# EAGLE schematic CPU (EAGLE 7.5.0), part 3 of 7
## Module ALU
Ports: INPUT_A_1(in) INPUT_A_2(in) INPUT_A_3(in) INPUT_A_4(in) INPUT_A_5(in) INPUT_A_6(in) INPUT_A_7(in) INPUT_A_8(in) INPUT_B_1(in) INPUT_B_2(in) INPUT_B_3(in) INPUT_B_4(in) INPUT_B_5(in) INPUT_B_6(in) INPUT_B_7(in) INPUT_B_8(in) OPCODE_1(in) OPCODE_2(in) OPCODE_3(in) OPCODE_4(in) ALU_OPERATION(in) VCC(in) GND(in) OUTPUT1(out) OUTPUT2(out) OUTPUT3(out) OUTPUT4(out) OUTPUT5(out) OUTPUT6(out) OUTPUT7(out) OUTPUT8(out) SIGN(out) ZERO(out) CARRY(out) OVERFLOW(out)
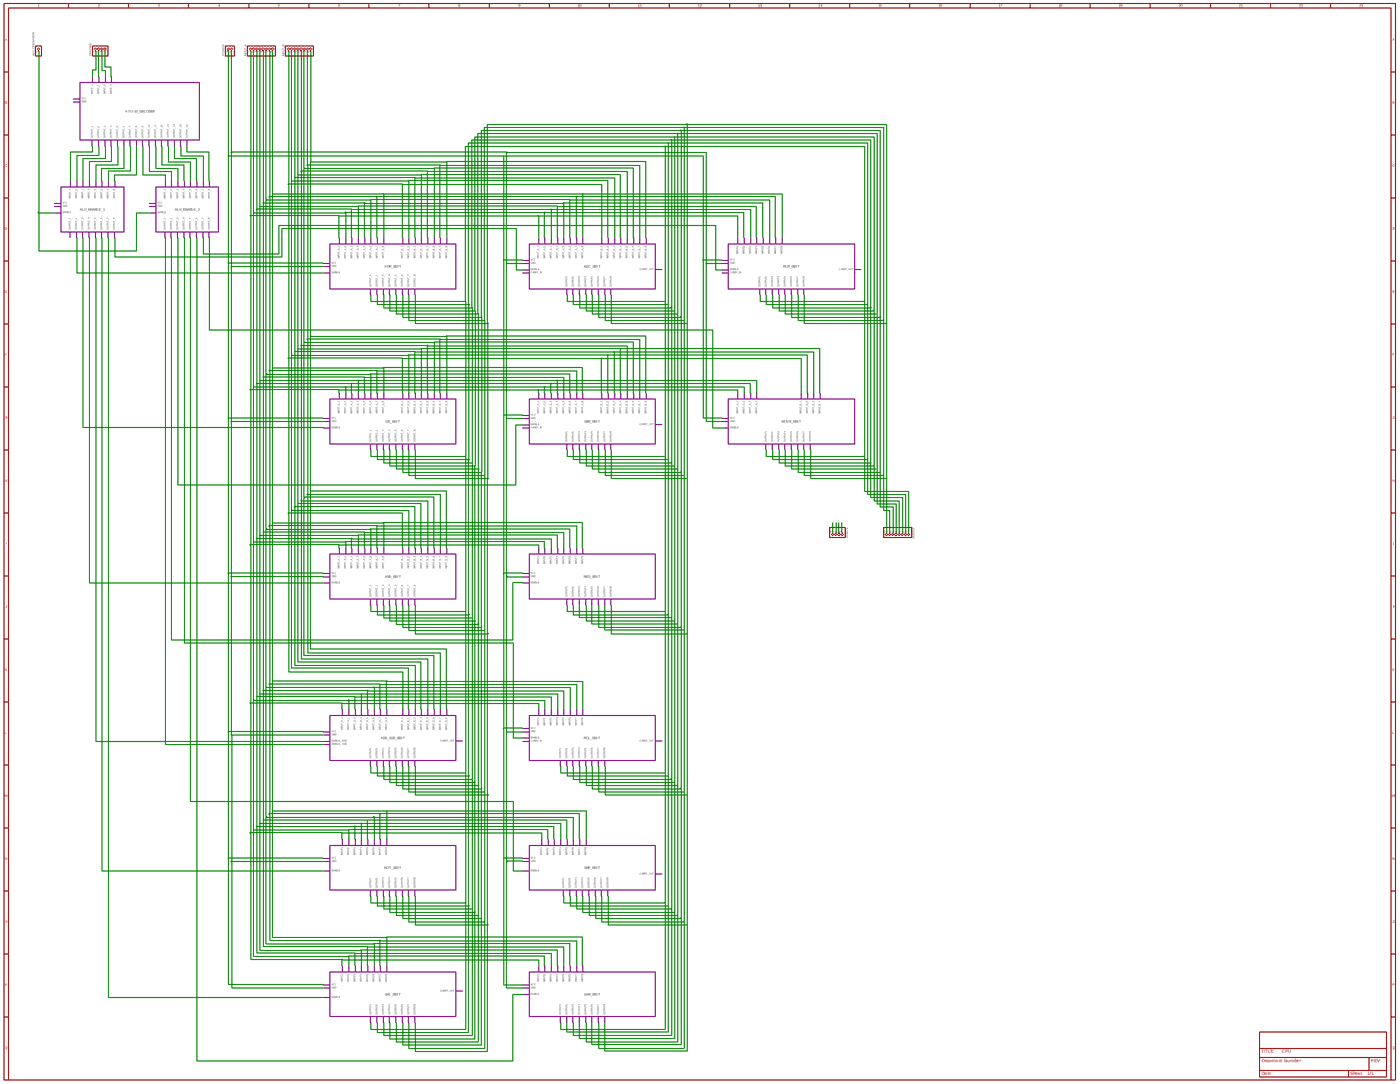
[diagram p37: schematic, module ALU, sheet 1, overview]
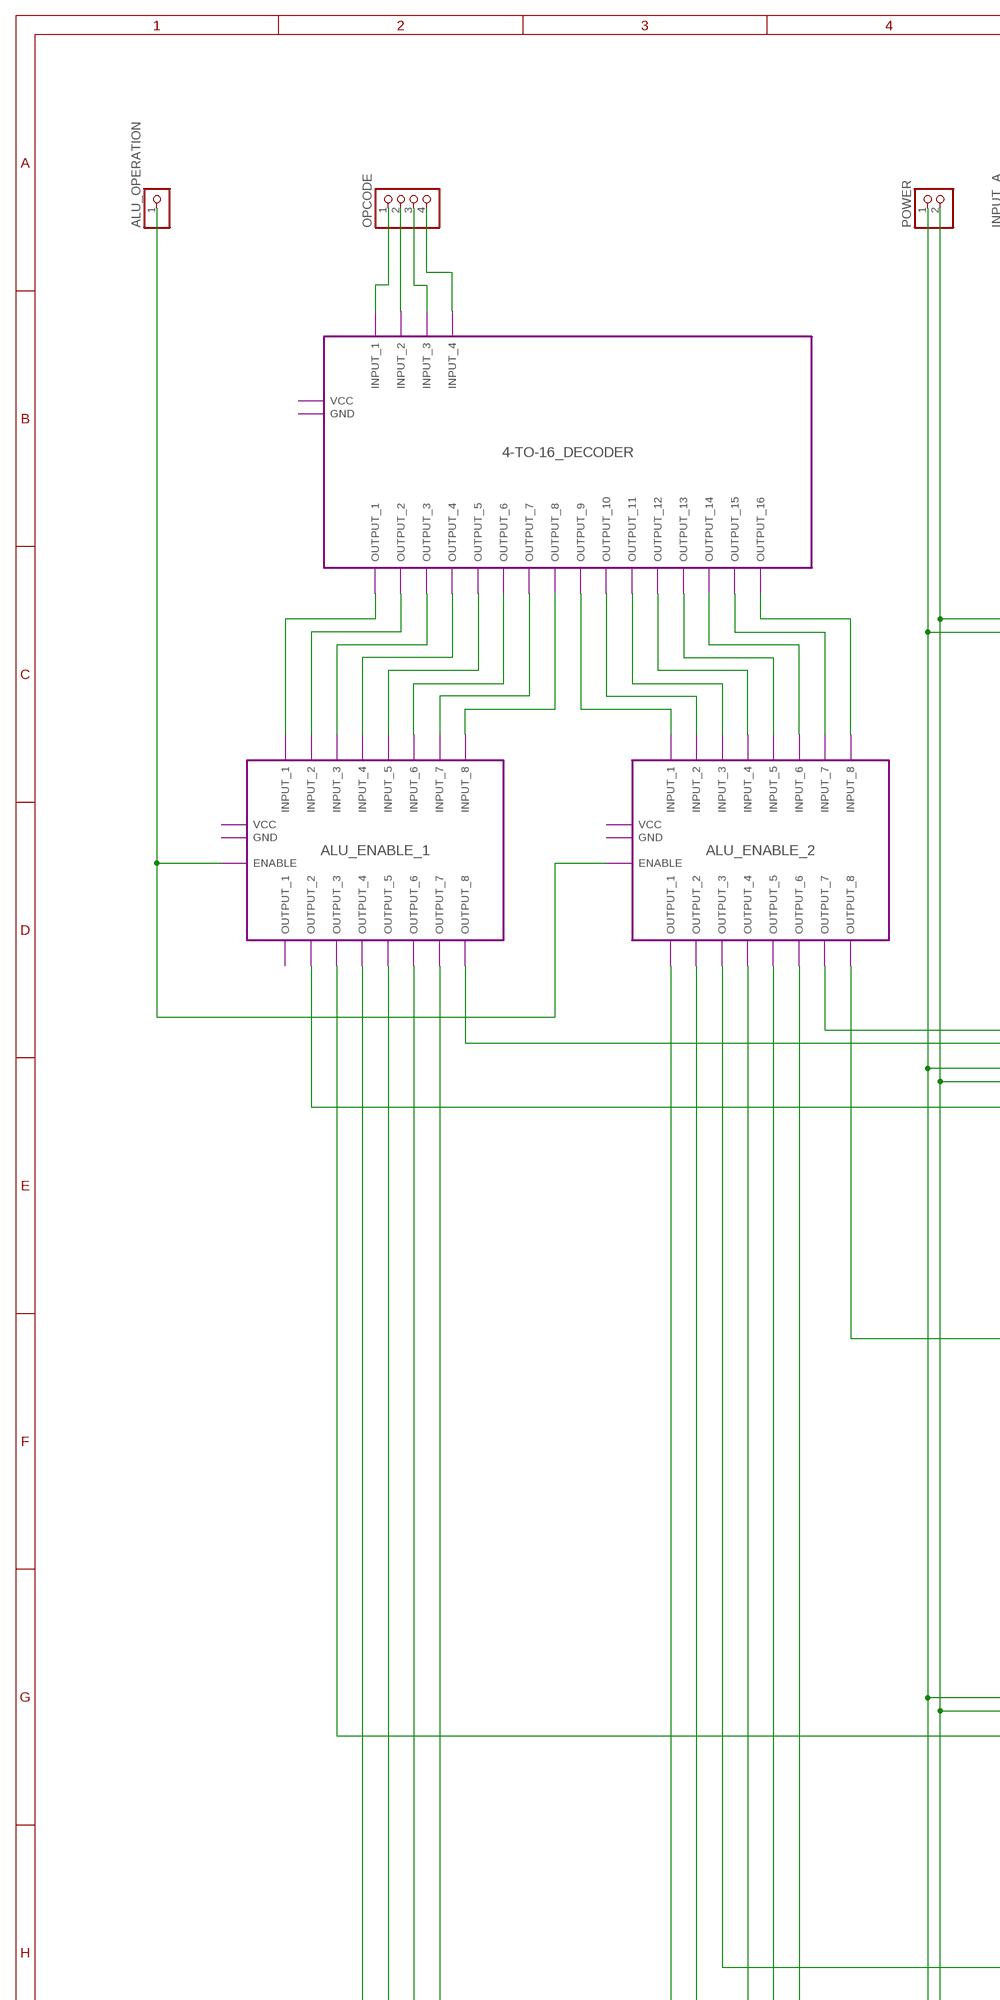
[diagram p38: schematic, module ALU, sheet 1, part 1 of 7]
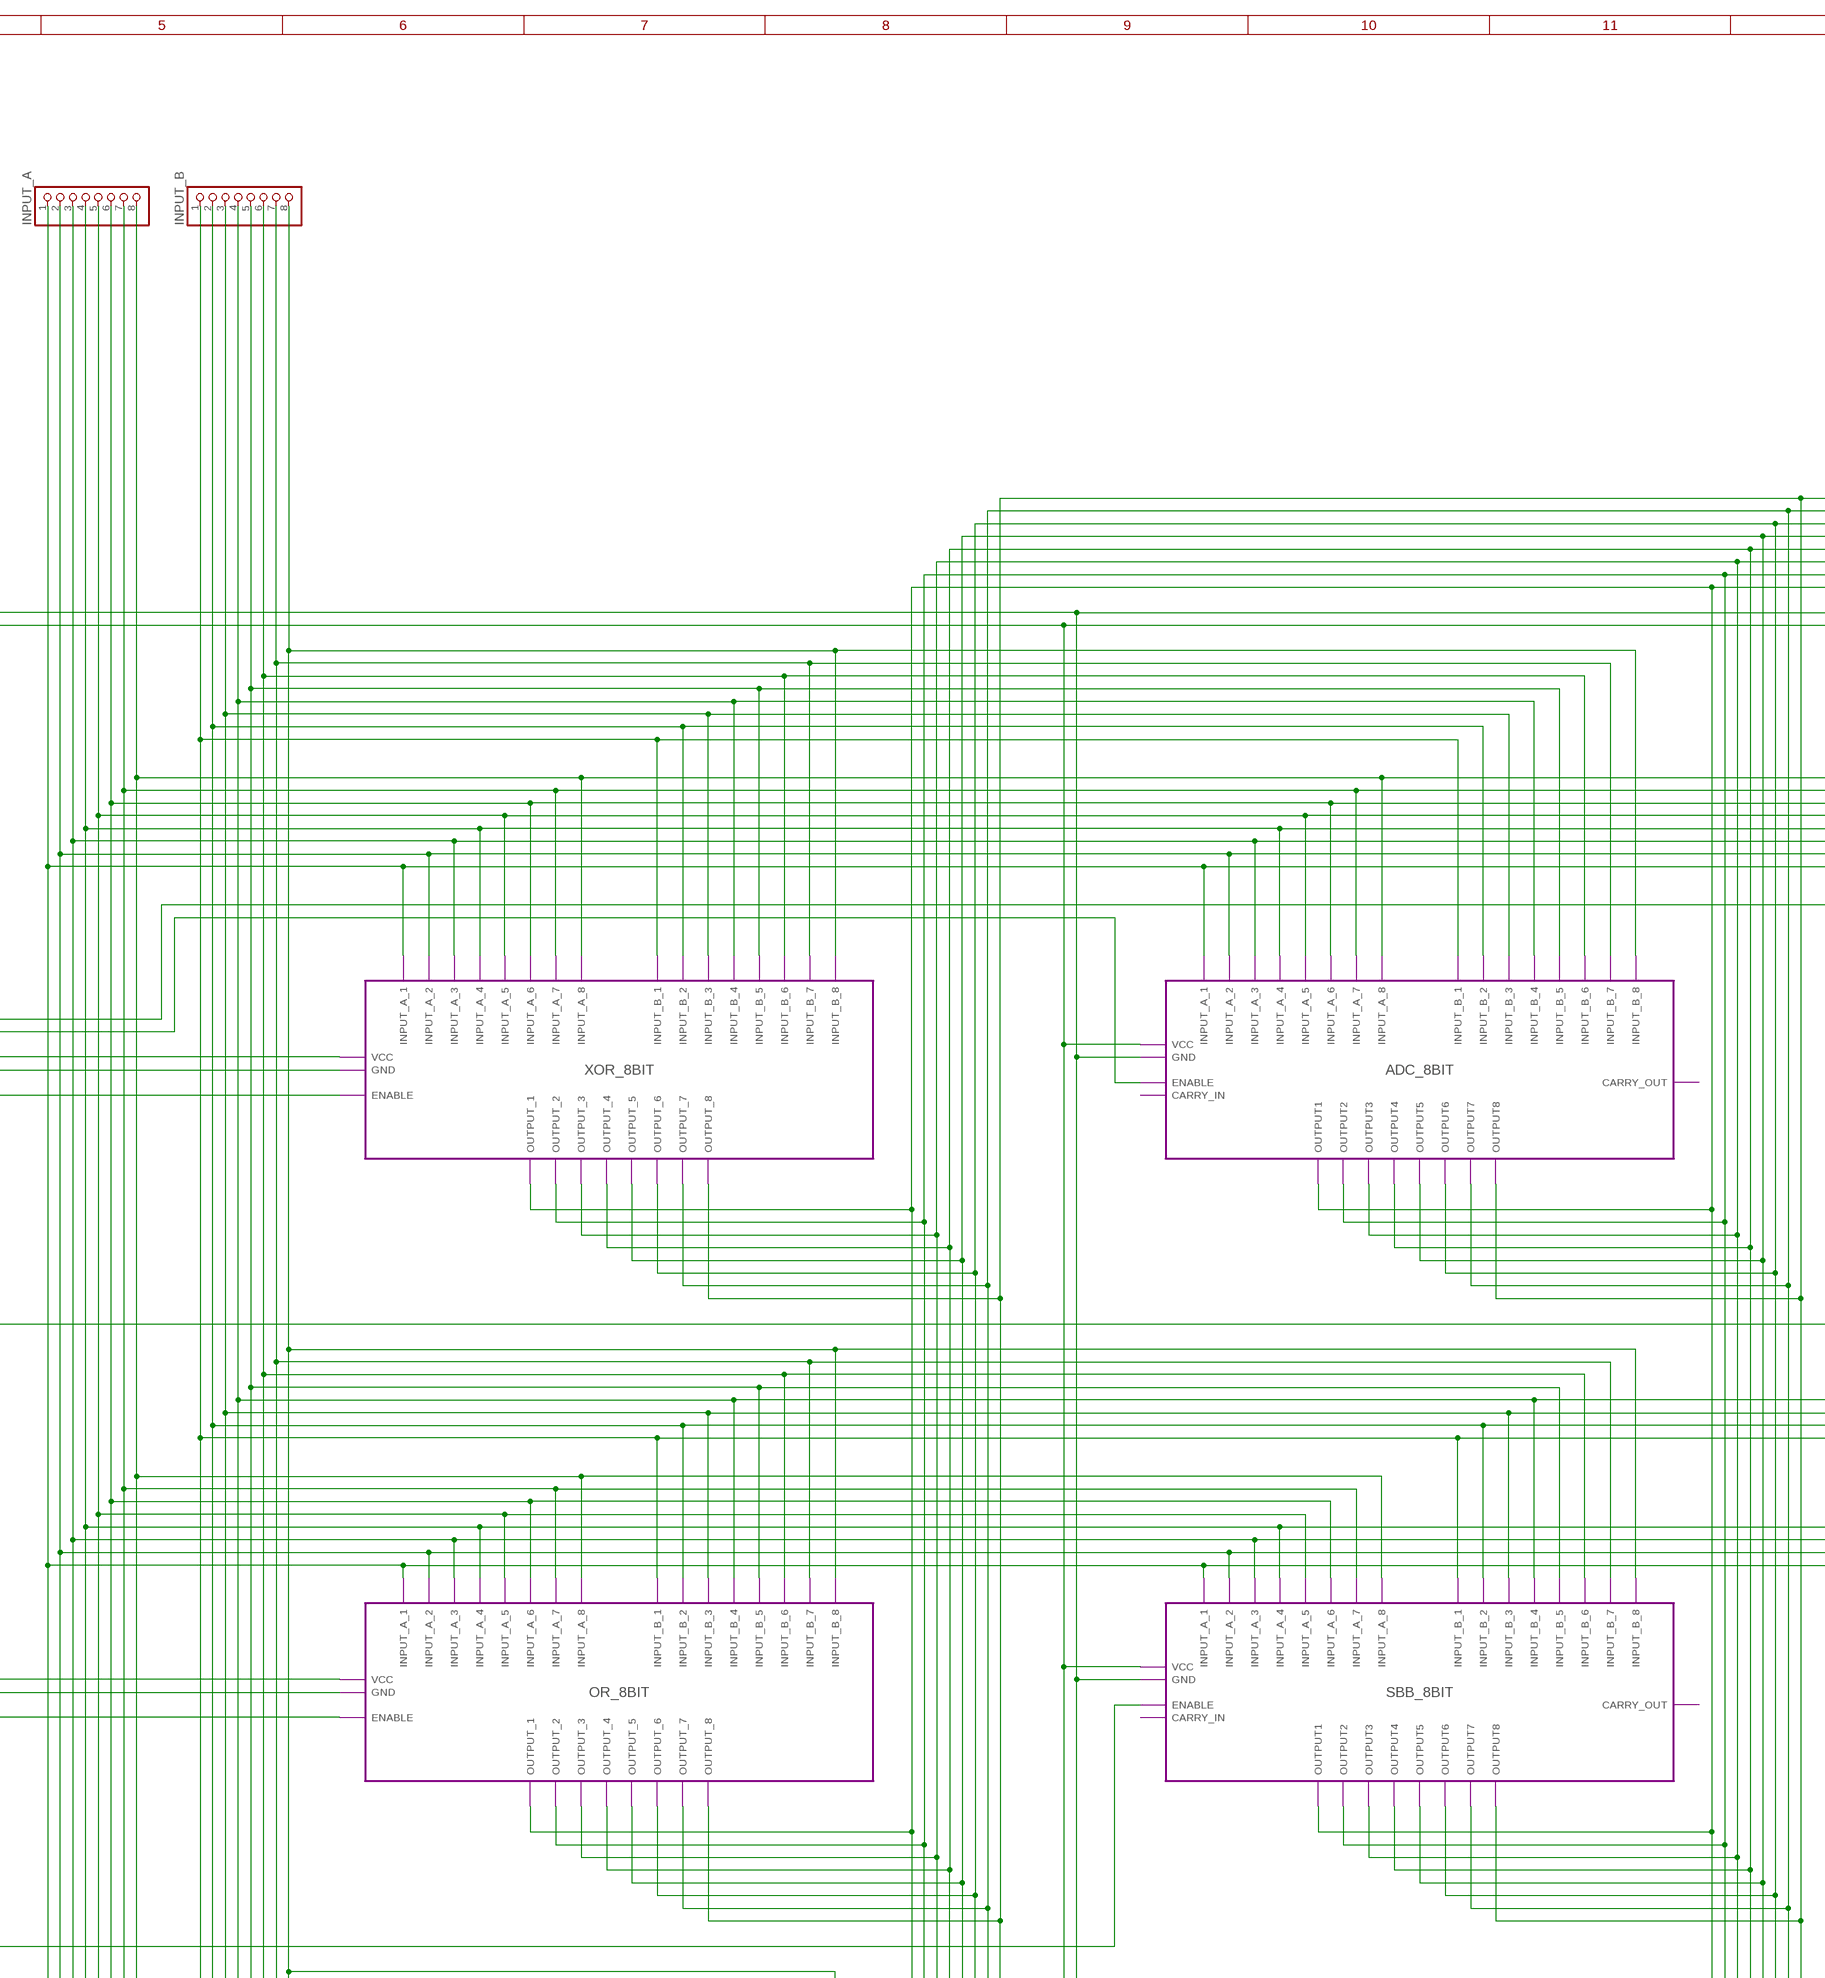
[diagram p39: schematic, module ALU, sheet 1, part 2 of 7]
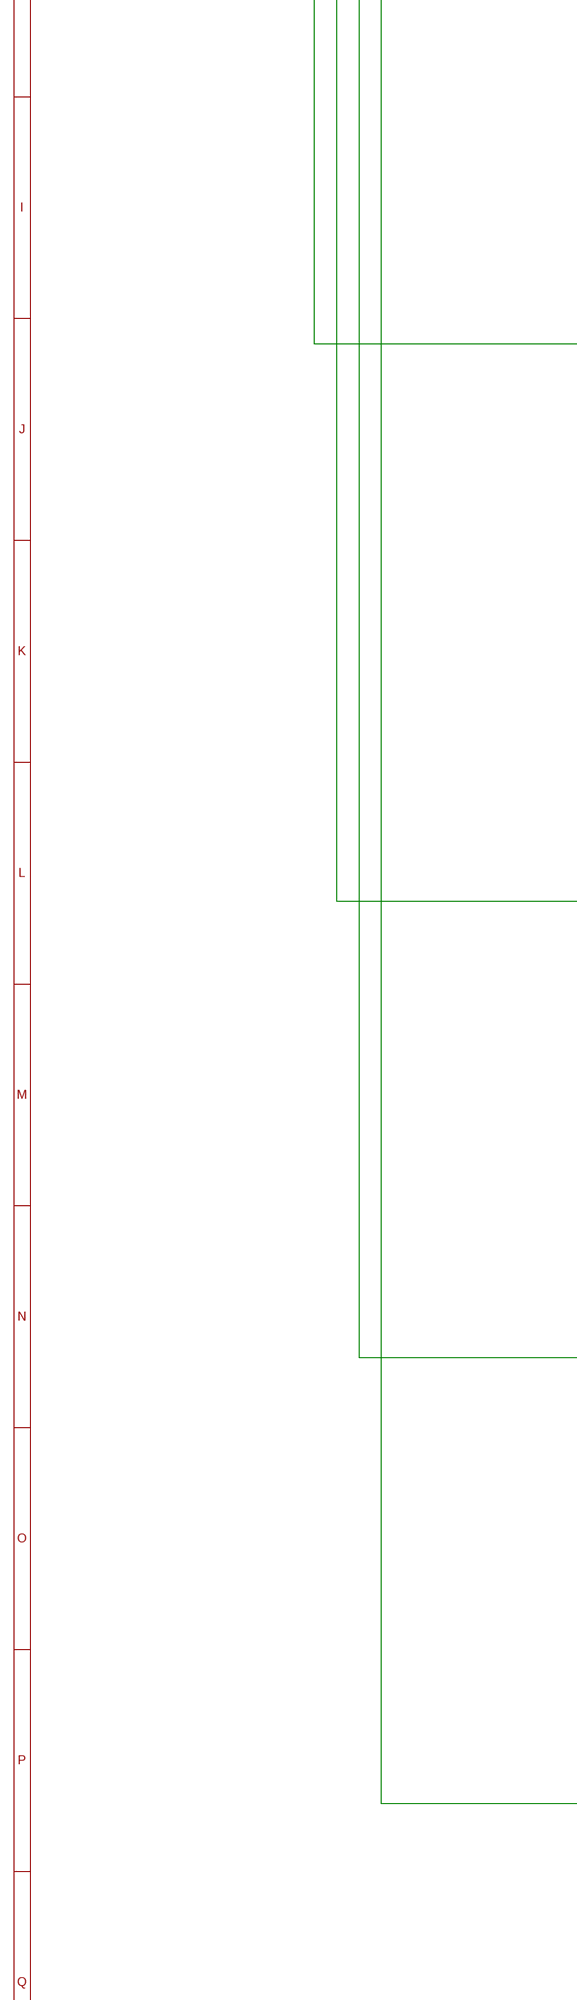
[diagram p40: schematic, module ALU, sheet 1, part 3 of 7]
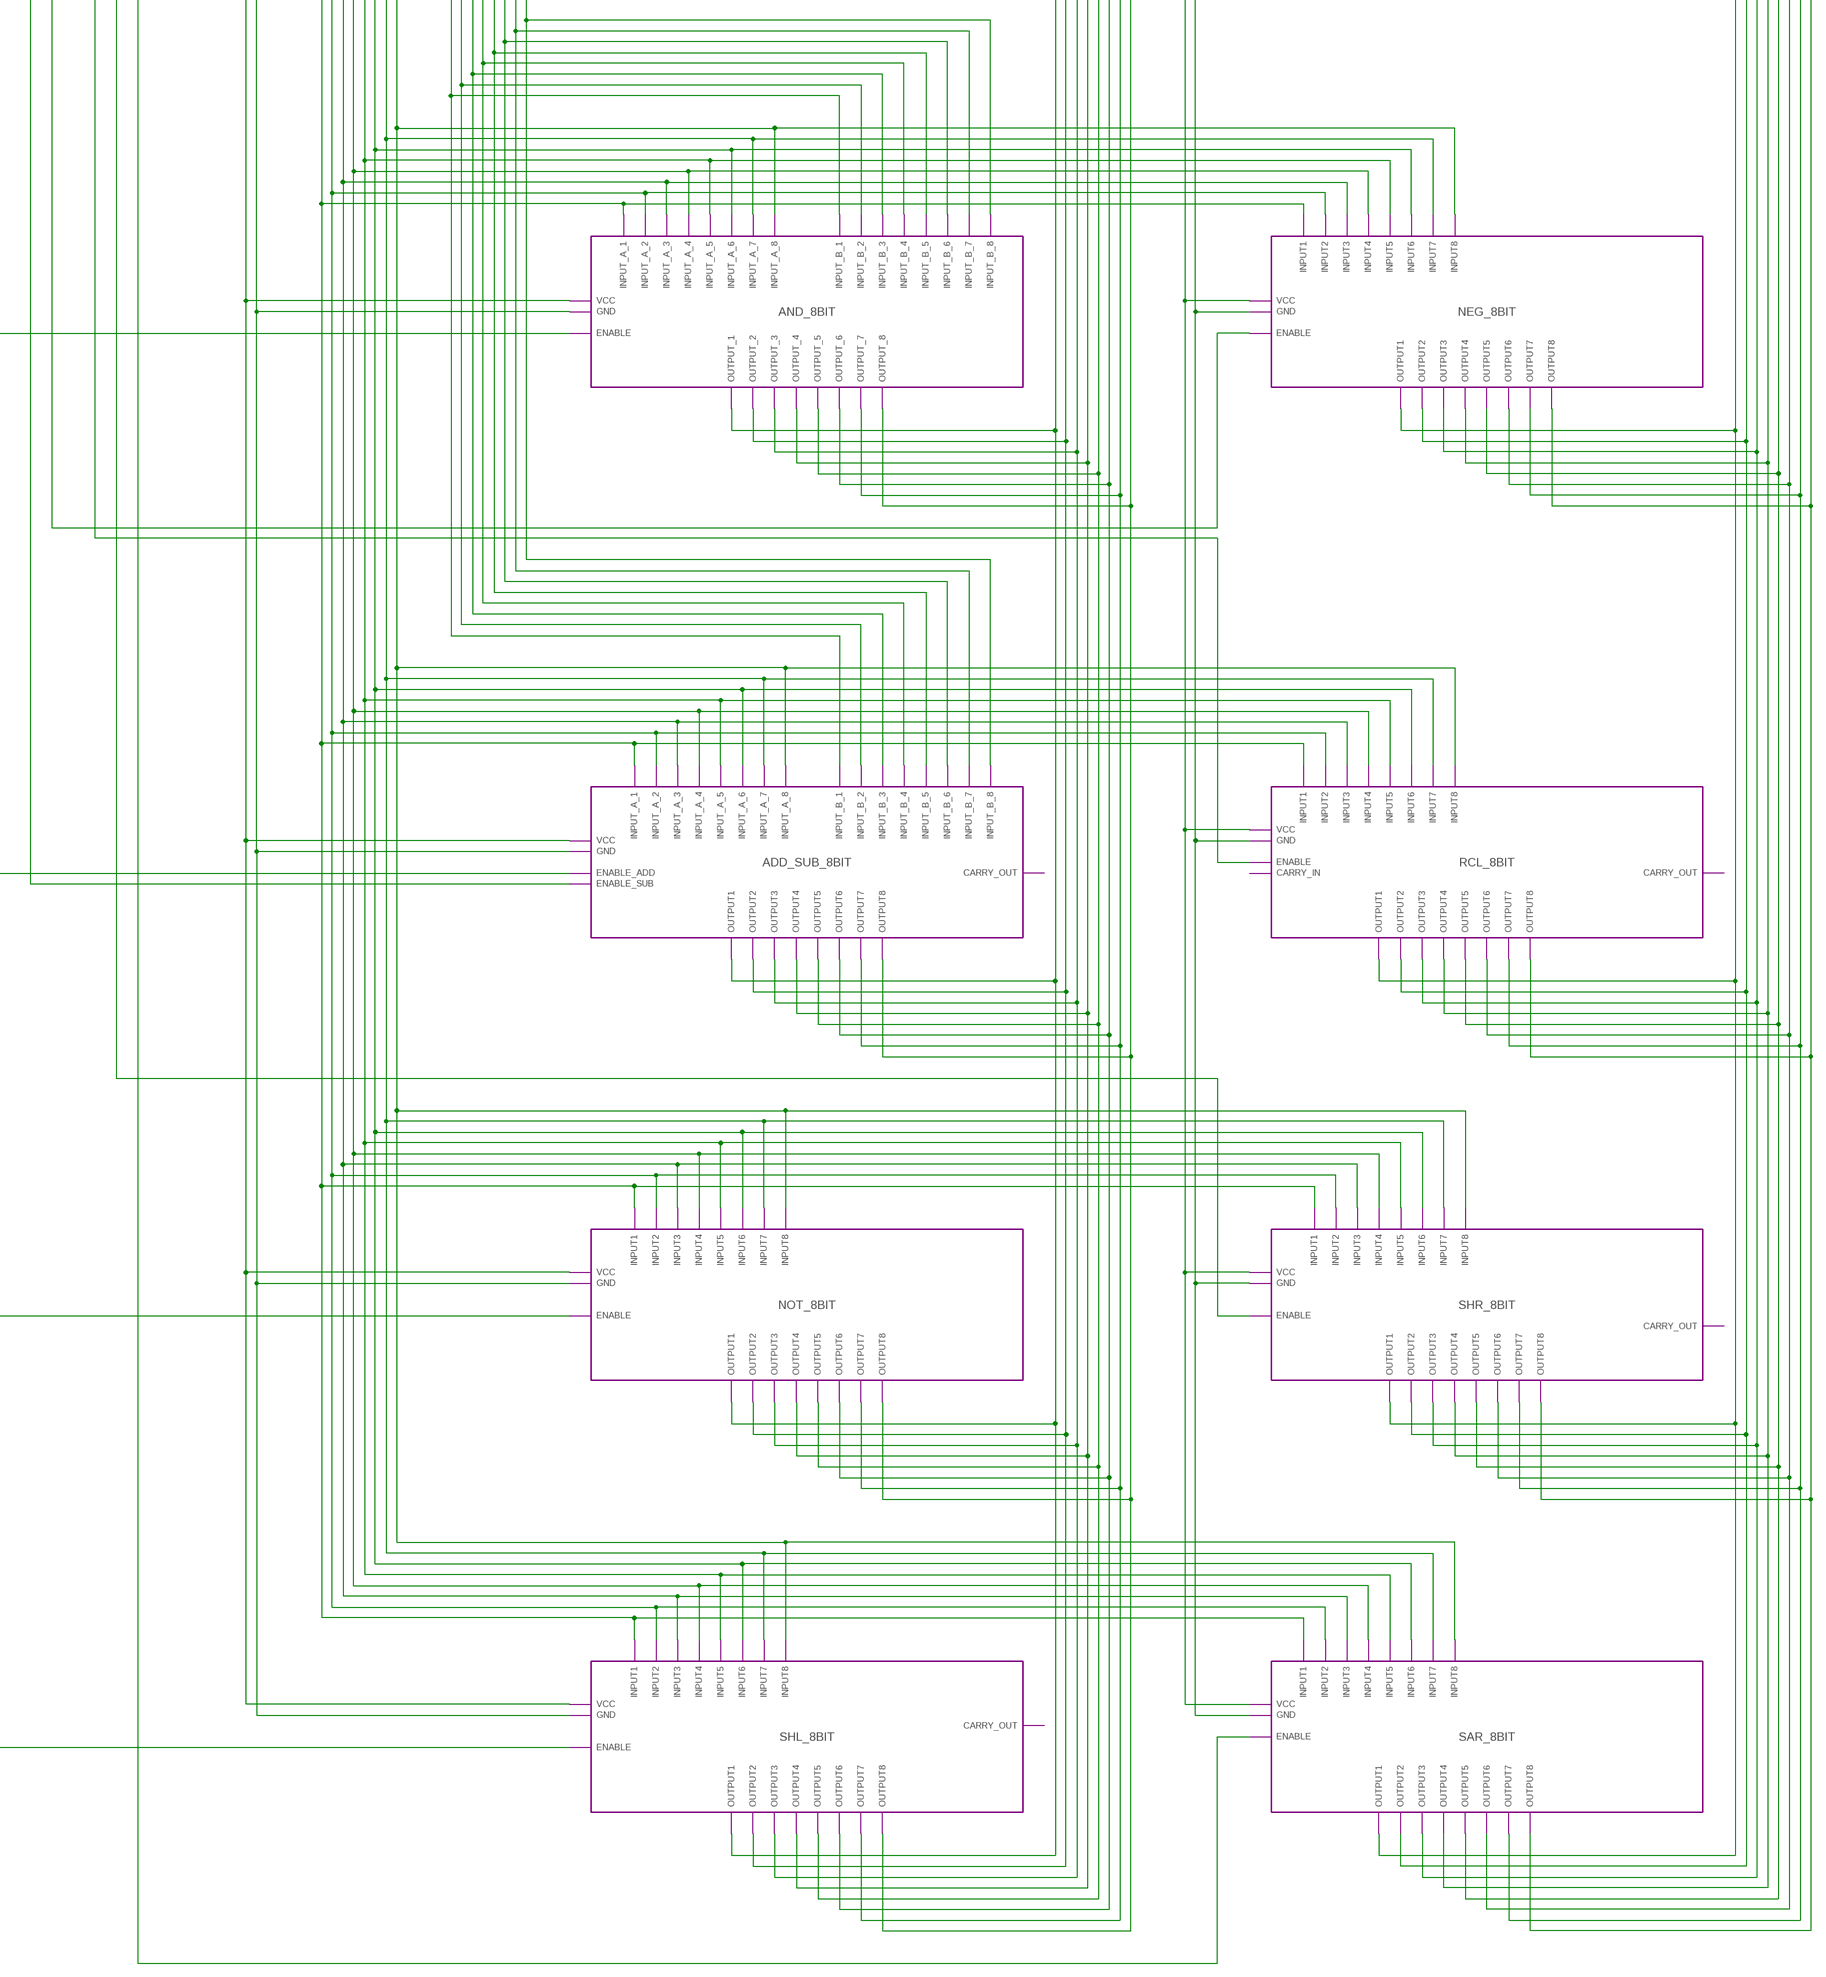
[diagram p41: schematic, module ALU, sheet 1, part 4 of 7]
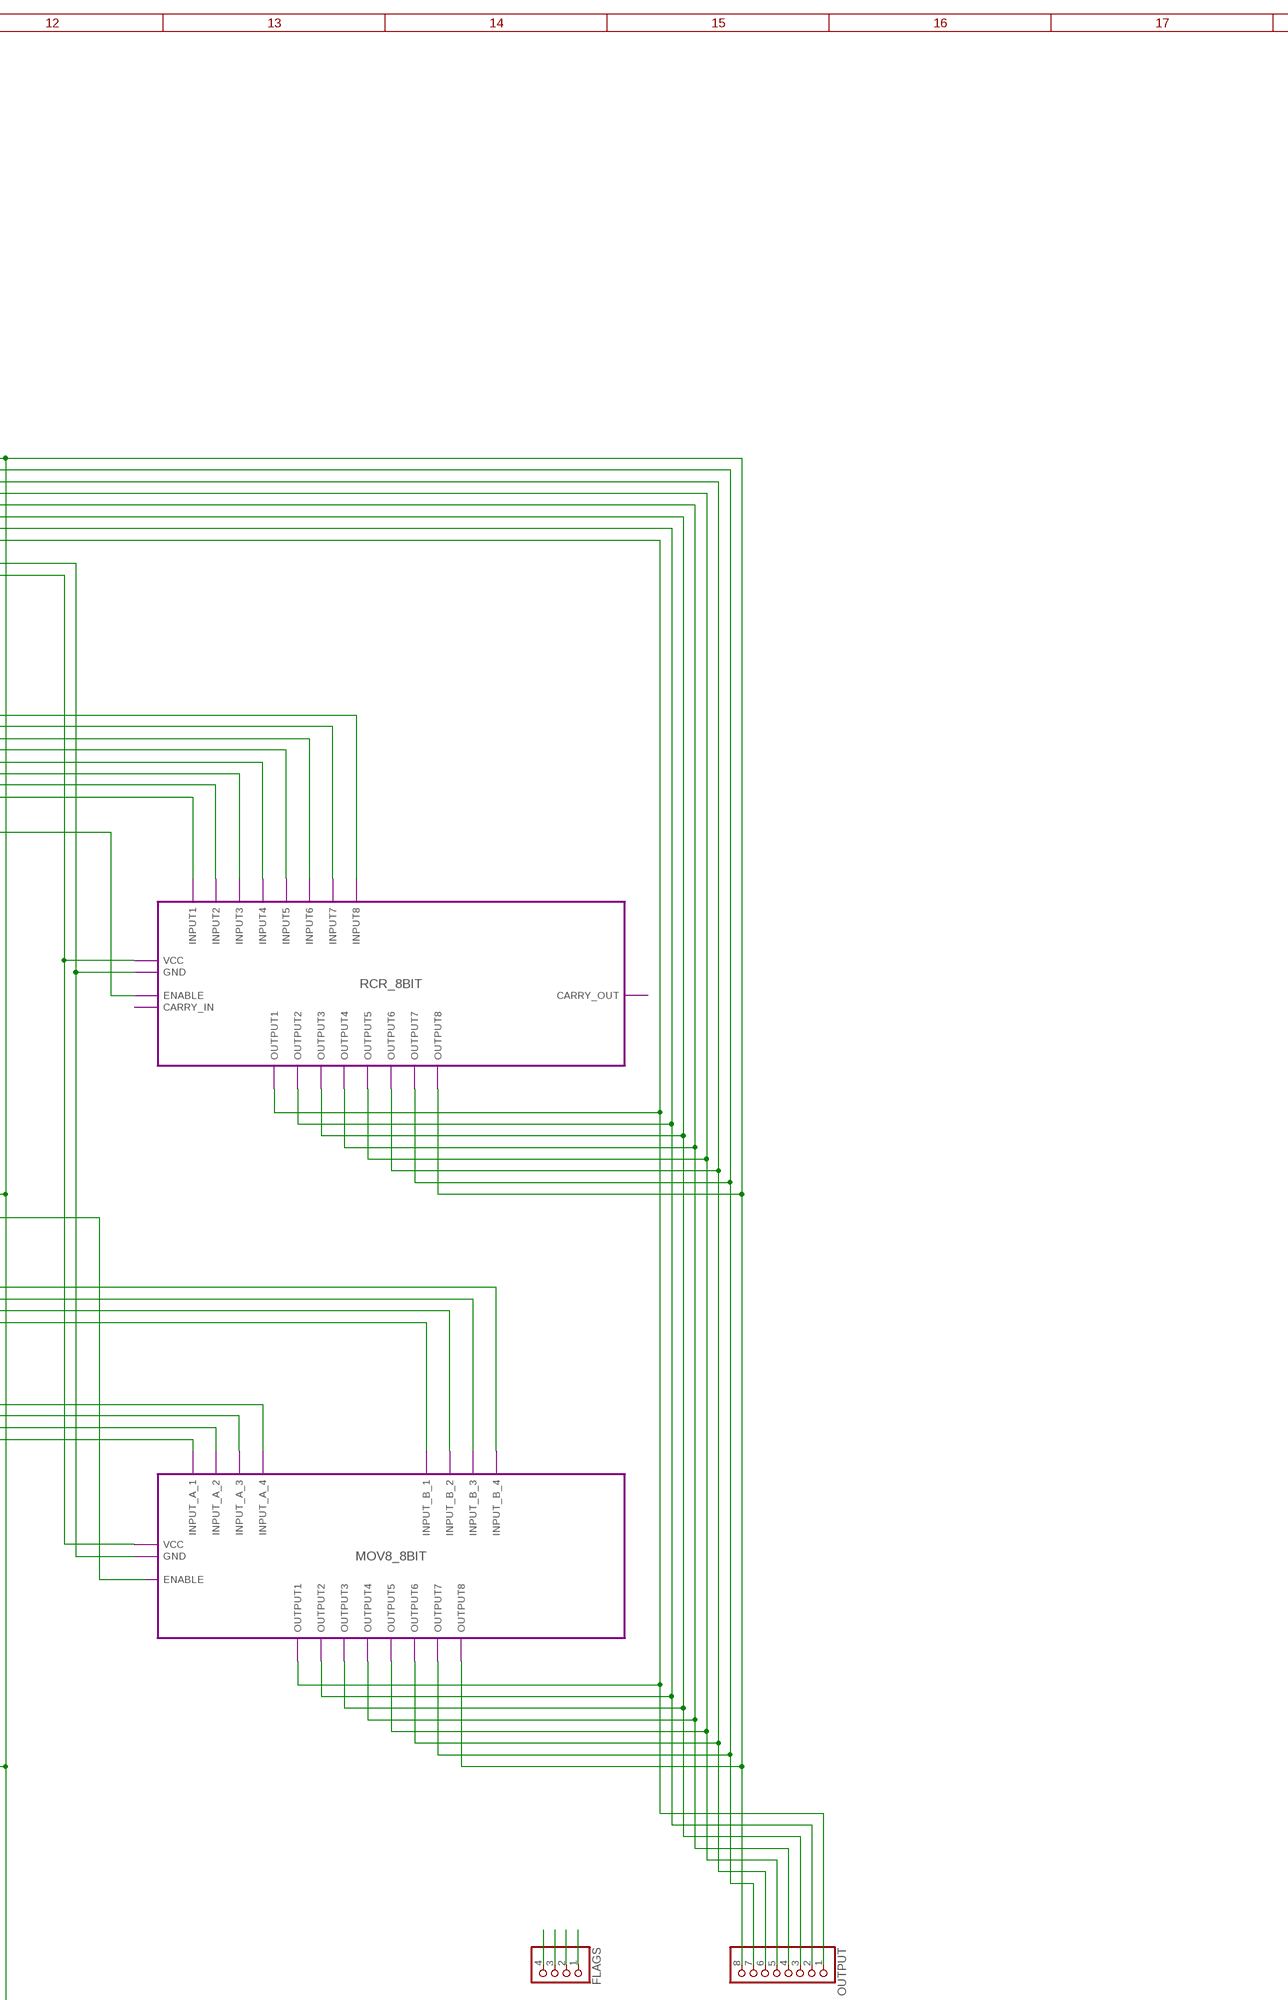
[diagram p42: schematic, module ALU, sheet 1, part 5 of 7]
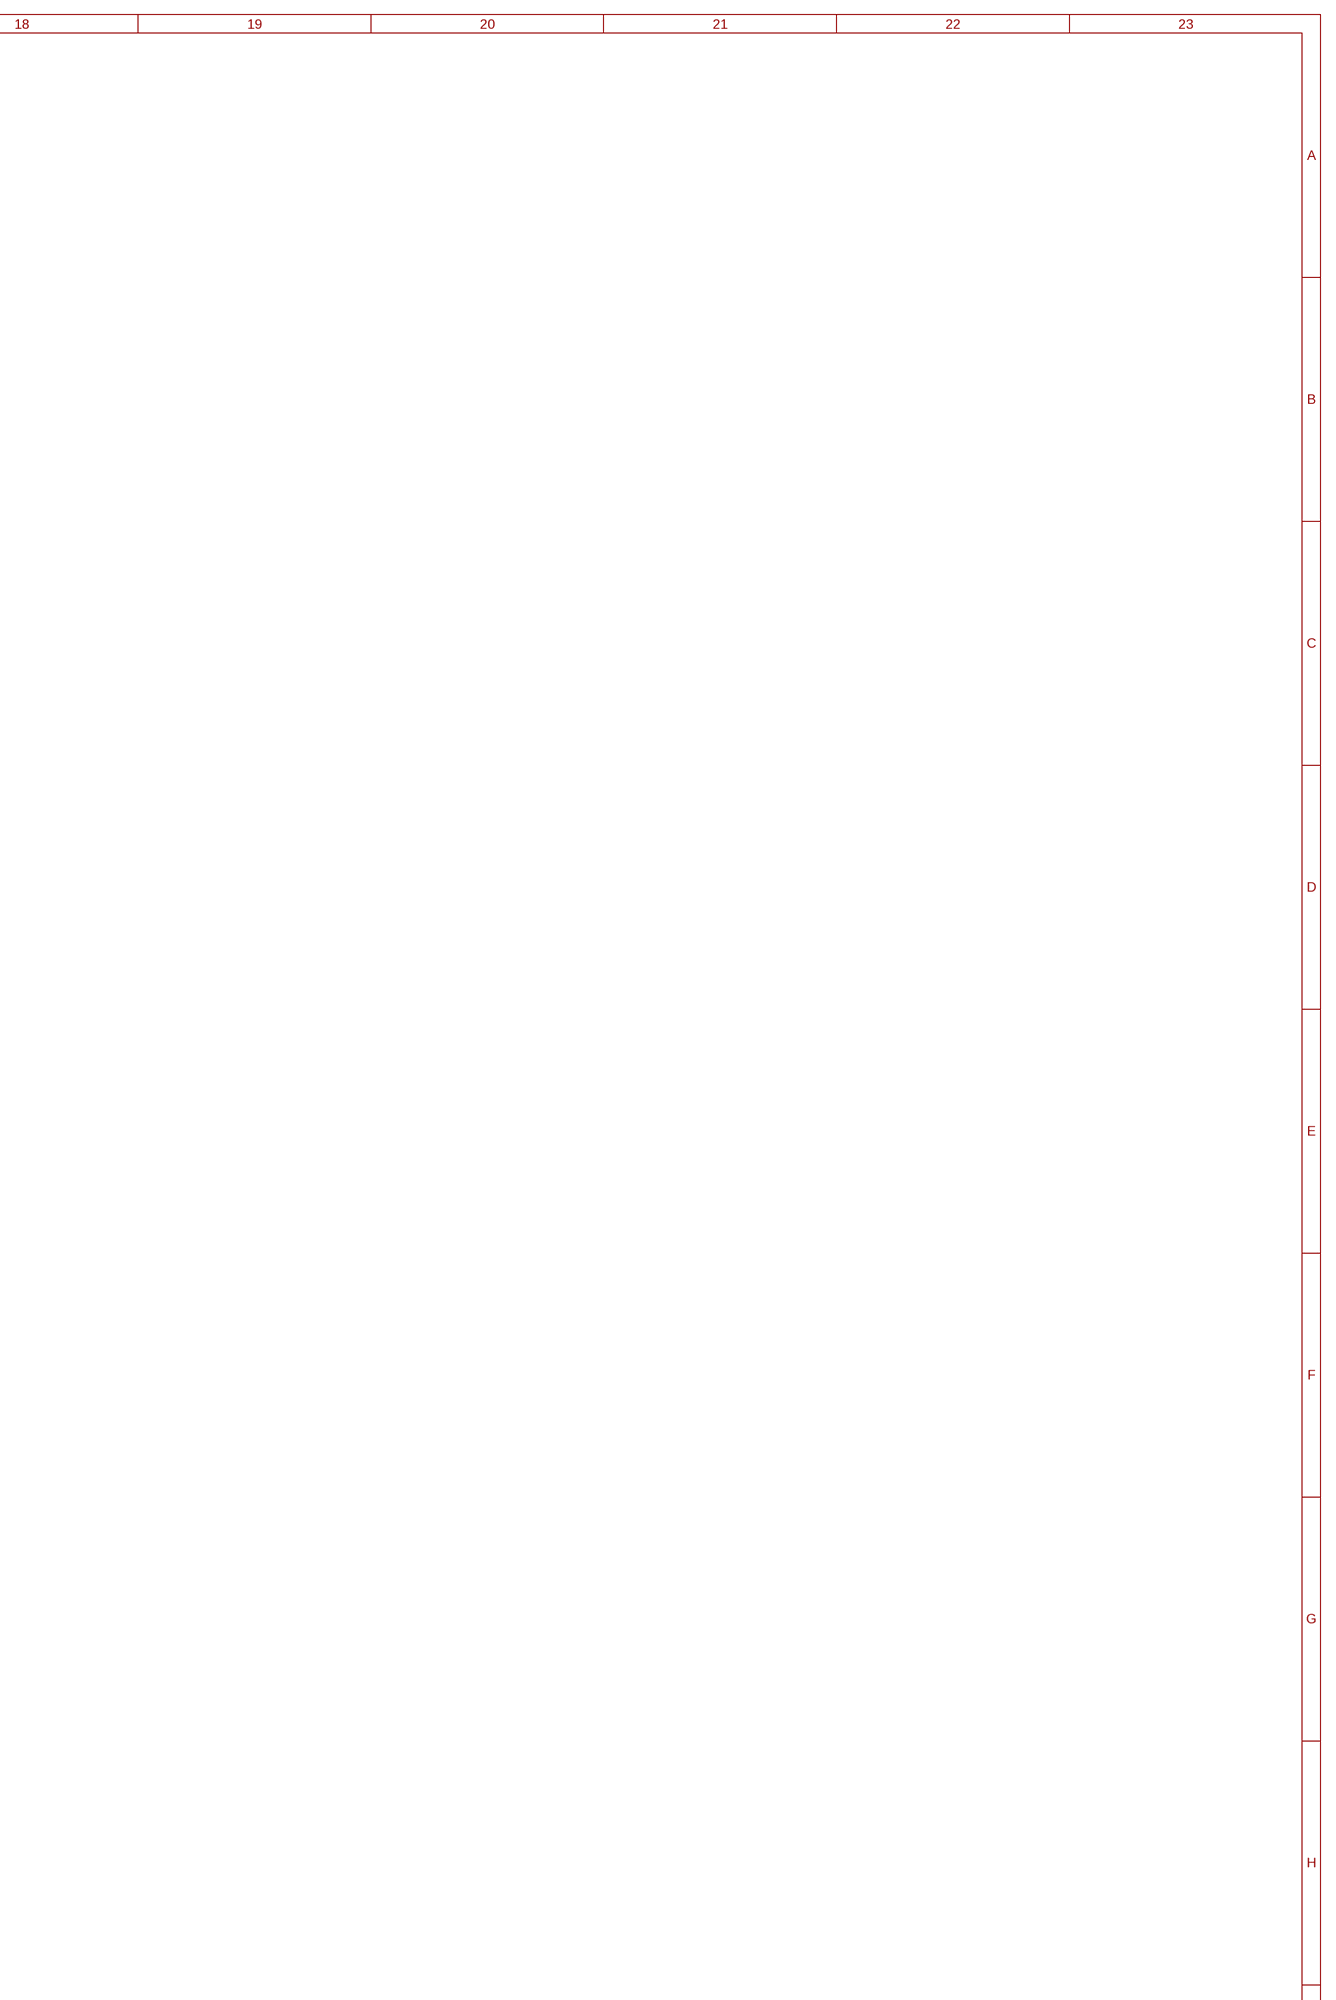
[diagram p43: schematic, module ALU, sheet 1, part 6 of 7]
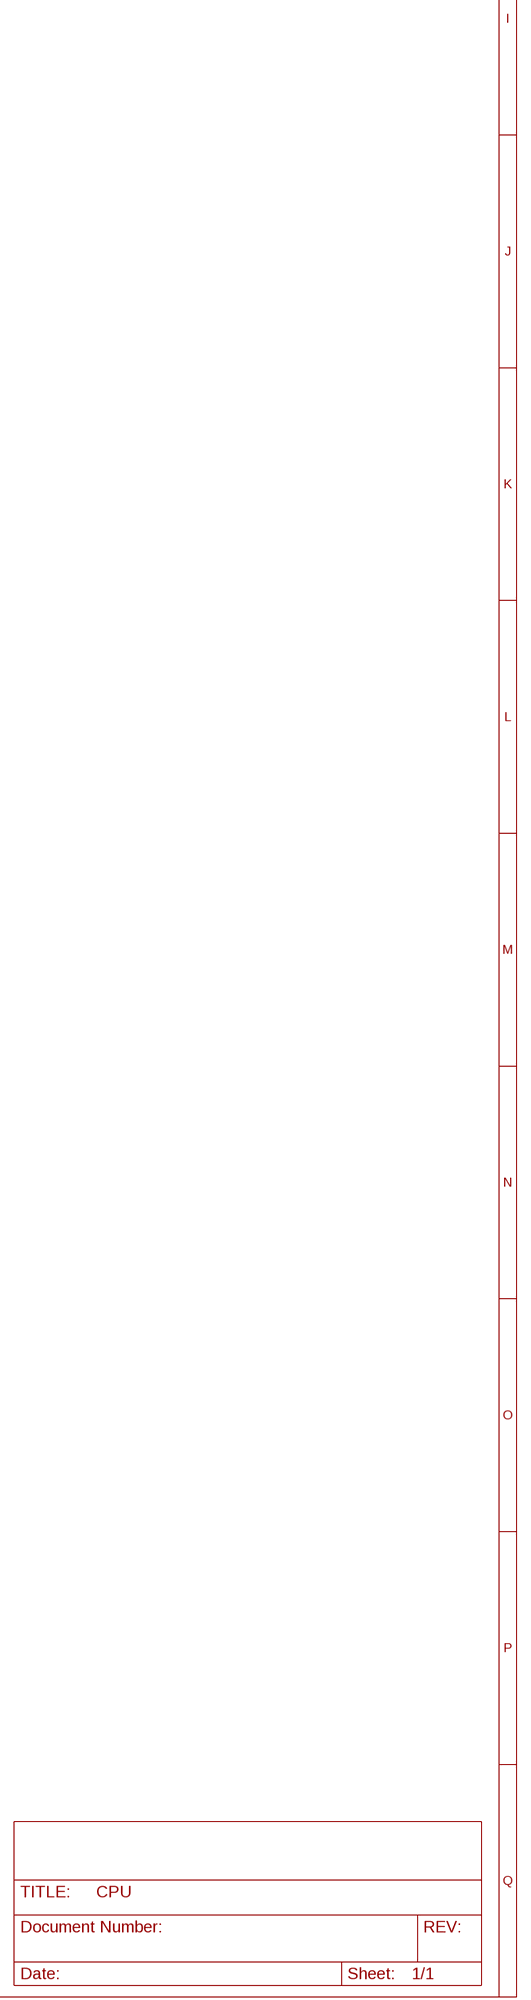
[diagram p44: schematic, module ALU, sheet 1, part 7 of 7]

### Parts
ALU_OPERATION  PINHD-1X1  [1X01]
FLAGS  PINHD-1X4  [1X04]
INPUT_A  PINHD-1X8  [1X08]
INPUT_B  PINHD-1X8  [1X08]
OPCODE  PINHD-1X4  [1X04]
OUTPUT  PINHD-1X8  [1X08]
POWER  PINHD-1X2  [1X02]

### Module instances
XOR_8BIT = XOR
AND_8BIT = AND
OR_8BIT = OR
ADD_SUB_8BIT = ADD
NOT_8BIT = NOT
SHL_8BIT = SHL
ADC_8BIT = ADC
NEG_8BIT = NEG
RCL_8BIT = RCL
SHR_8BIT = SHR
SAR_8BIT = SAR
RCR_8BIT = RCR
MOV8_8BIT = MOV8
SBB_8BIT = SBB
4-TO-16_DECODER = 4-TO-16_DECODER
ALU_ENABLE_1 = ENABLE_CIRCUIT
ALU_ENABLE_2 = ENABLE_CIRCUIT

### Nets
ALU_OPERATION: ALU_OPERATION.1 ; port ALU_ENABLE_1.ENABLE ALU_ENABLE_2.ENABLE
CARRY: FLAGS.3
GND: POWER.2 ; port XOR_8BIT.GND OR_8BIT.GND AND_8BIT.GND ADD_SUB_8BIT.GND NOT_8BIT.GND SHL_8BIT.GND SHR_8BIT.GND RCL_8BIT.GND MOV8_8BIT.GND ADC_8BIT.GND SBB_8BIT.GND NEG_8BIT.GND SAR_8BIT.GND RCR_8BIT.GND
INPUT_A_1: INPUT_A.1 ; port XOR_8BIT.INPUT_A_1 OR_8BIT.INPUT_A_1 AND_8BIT.INPUT_A_1 ADD_SUB_8BIT.INPUT_A_1 NOT_8BIT.INPUT1 SHL_8BIT.INPUT1 SHR_8BIT.INPUT1 RCL_8BIT.INPUT1 MOV8_8BIT.INPUT_A_1 ADC_8BIT.INPUT_A_1 SBB_8BIT.INPUT_A_1 NEG_8BIT.INPUT1 SAR_8BIT.INPUT1 RCR_8BIT.INPUT1
INPUT_A_2: INPUT_A.2 ; port XOR_8BIT.INPUT_A_2 OR_8BIT.INPUT_A_2 AND_8BIT.INPUT_A_2 ADD_SUB_8BIT.INPUT_A_2 NOT_8BIT.INPUT2 SHL_8BIT.INPUT2 SHR_8BIT.INPUT2 RCL_8BIT.INPUT2 MOV8_8BIT.INPUT_A_2 ADC_8BIT.INPUT_A_2 SBB_8BIT.INPUT_A_2 NEG_8BIT.INPUT2 SAR_8BIT.INPUT2 RCR_8BIT.INPUT2
INPUT_A_3: INPUT_A.3 ; port XOR_8BIT.INPUT_A_3 OR_8BIT.INPUT_A_3 AND_8BIT.INPUT_A_3 ADD_SUB_8BIT.INPUT_A_3 NOT_8BIT.INPUT3 SHL_8BIT.INPUT3 SHR_8BIT.INPUT3 RCL_8BIT.INPUT3 MOV8_8BIT.INPUT_A_3 ADC_8BIT.INPUT_A_3 SBB_8BIT.INPUT_A_3 NEG_8BIT.INPUT3 SAR_8BIT.INPUT3 RCR_8BIT.INPUT3
INPUT_A_4: INPUT_A.4 ; port XOR_8BIT.INPUT_A_4 OR_8BIT.INPUT_A_4 AND_8BIT.INPUT_A_4 ADD_SUB_8BIT.INPUT_A_4 NOT_8BIT.INPUT4 SHL_8BIT.INPUT4 SHR_8BIT.INPUT4 RCL_8BIT.INPUT4 MOV8_8BIT.INPUT_A_4 ADC_8BIT.INPUT_A_4 SBB_8BIT.INPUT_A_4 NEG_8BIT.INPUT4 SAR_8BIT.INPUT4 RCR_8BIT.INPUT4
INPUT_A_5: INPUT_A.5 ; port XOR_8BIT.INPUT_A_5 OR_8BIT.INPUT_A_5 AND_8BIT.INPUT_A_5 ADD_SUB_8BIT.INPUT_A_5 NOT_8BIT.INPUT5 SHL_8BIT.INPUT5 SHR_8BIT.INPUT5 RCL_8BIT.INPUT5 ADC_8BIT.INPUT_A_5 SBB_8BIT.INPUT_A_5 NEG_8BIT.INPUT5 SAR_8BIT.INPUT5 RCR_8BIT.INPUT5
INPUT_A_6: INPUT_A.6 ; port XOR_8BIT.INPUT_A_6 OR_8BIT.INPUT_A_6 AND_8BIT.INPUT_A_6 ADD_SUB_8BIT.INPUT_A_6 NOT_8BIT.INPUT6 SHL_8BIT.INPUT6 SHR_8BIT.INPUT6 RCL_8BIT.INPUT6 ADC_8BIT.INPUT_A_6 SBB_8BIT.INPUT_A_6 NEG_8BIT.INPUT6 SAR_8BIT.INPUT6 RCR_8BIT.INPUT6
INPUT_A_7: INPUT_A.7 ; port XOR_8BIT.INPUT_A_7 OR_8BIT.INPUT_A_7 AND_8BIT.INPUT_A_7 ADD_SUB_8BIT.INPUT_A_7 NOT_8BIT.INPUT7 SHL_8BIT.INPUT7 SHR_8BIT.INPUT7 RCL_8BIT.INPUT7 ADC_8BIT.INPUT_A_7 SBB_8BIT.INPUT_A_7 NEG_8BIT.INPUT7 SAR_8BIT.INPUT7 RCR_8BIT.INPUT7
INPUT_A_8: INPUT_A.8 ; port XOR_8BIT.INPUT_A_8 OR_8BIT.INPUT_A_8 AND_8BIT.INPUT_A_8 ADD_SUB_8BIT.INPUT_A_8 NOT_8BIT.INPUT8 SHL_8BIT.INPUT8 SHR_8BIT.INPUT8 RCL_8BIT.INPUT8 ADC_8BIT.INPUT_A_8 SBB_8BIT.INPUT_A_8 NEG_8BIT.INPUT8 SAR_8BIT.INPUT8 RCR_8BIT.INPUT8
INPUT_B_1: INPUT_B.1 ; port XOR_8BIT.INPUT_B_1 OR_8BIT.INPUT_B_1 AND_8BIT.INPUT_B_1 ADD_SUB_8BIT.INPUT_B_1 MOV8_8BIT.INPUT_B_1 ADC_8BIT.INPUT_B_1 SBB_8BIT.INPUT_B_1
INPUT_B_2: INPUT_B.2 ; port XOR_8BIT.INPUT_B_2 OR_8BIT.INPUT_B_2 AND_8BIT.INPUT_B_2 ADD_SUB_8BIT.INPUT_B_2 MOV8_8BIT.INPUT_B_2 ADC_8BIT.INPUT_B_2 SBB_8BIT.INPUT_B_2
INPUT_B_3: INPUT_B.3 ; port XOR_8BIT.INPUT_B_3 OR_8BIT.INPUT_B_3 AND_8BIT.INPUT_B_3 ADD_SUB_8BIT.INPUT_B_3 MOV8_8BIT.INPUT_B_3 ADC_8BIT.INPUT_B_3 SBB_8BIT.INPUT_B_3
INPUT_B_4: INPUT_B.4 ; port XOR_8BIT.INPUT_B_4 OR_8BIT.INPUT_B_4 AND_8BIT.INPUT_B_4 ADD_SUB_8BIT.INPUT_B_4 MOV8_8BIT.INPUT_B_4 ADC_8BIT.INPUT_B_4 SBB_8BIT.INPUT_B_4
INPUT_B_5: INPUT_B.5 ; port XOR_8BIT.INPUT_B_5 OR_8BIT.INPUT_B_5 AND_8BIT.INPUT_B_5 ADD_SUB_8BIT.INPUT_B_5 ADC_8BIT.INPUT_B_5 SBB_8BIT.INPUT_B_5
INPUT_B_6: INPUT_B.6 ; port XOR_8BIT.INPUT_B_6 OR_8BIT.INPUT_B_6 AND_8BIT.INPUT_B_6 ADD_SUB_8BIT.INPUT_B_6 ADC_8BIT.INPUT_B_6 SBB_8BIT.INPUT_B_6
INPUT_B_7: INPUT_B.7 ; port XOR_8BIT.INPUT_B_7 OR_8BIT.INPUT_B_7 AND_8BIT.INPUT_B_7 ADD_SUB_8BIT.INPUT_B_7 ADC_8BIT.INPUT_B_7 SBB_8BIT.INPUT_B_7
INPUT_B_8: INPUT_B.8 ; port XOR_8BIT.INPUT_B_8 OR_8BIT.INPUT_B_8 AND_8BIT.INPUT_B_8 ADD_SUB_8BIT.INPUT_B_8 ADC_8BIT.INPUT_B_8 SBB_8BIT.INPUT_B_8
N$1: port 4-TO-16_DECODER.OUTPUT_1 ALU_ENABLE_1.INPUT_1
N$2: port 4-TO-16_DECODER.OUTPUT_2 ALU_ENABLE_1.INPUT_2
N$3: port 4-TO-16_DECODER.OUTPUT_3 ALU_ENABLE_1.INPUT_3
N$4: port 4-TO-16_DECODER.OUTPUT_4 ALU_ENABLE_1.INPUT_4
N$5: port 4-TO-16_DECODER.OUTPUT_5 ALU_ENABLE_1.INPUT_5
N$6: port ALU_ENABLE_1.INPUT_6 4-TO-16_DECODER.OUTPUT_6
N$7: port 4-TO-16_DECODER.OUTPUT_7 ALU_ENABLE_1.INPUT_7
N$8: port ALU_ENABLE_1.INPUT_8 4-TO-16_DECODER.OUTPUT_8
N$9: port 4-TO-16_DECODER.OUTPUT_9 ALU_ENABLE_2.INPUT_1
N$10: port 4-TO-16_DECODER.OUTPUT_10 ALU_ENABLE_2.INPUT_2
N$11: port 4-TO-16_DECODER.OUTPUT_11 ALU_ENABLE_2.INPUT_3
N$12: port ALU_ENABLE_2.INPUT_4 4-TO-16_DECODER.OUTPUT_12
N$13: port 4-TO-16_DECODER.OUTPUT_13 ALU_ENABLE_2.INPUT_5
N$14: port ALU_ENABLE_2.INPUT_6 4-TO-16_DECODER.OUTPUT_14
N$15: port 4-TO-16_DECODER.OUTPUT_15 ALU_ENABLE_2.INPUT_7
N$16: port ALU_ENABLE_2.INPUT_8 4-TO-16_DECODER.OUTPUT_16
N$18: port ALU_ENABLE_1.OUTPUT_2 XOR_8BIT.ENABLE
N$42: port ALU_ENABLE_2.OUTPUT_8
N$45: port ALU_ENABLE_1.OUTPUT_3 OR_8BIT.ENABLE
N$46: port ALU_ENABLE_2.OUTPUT_5 SHR_8BIT.ENABLE
N$47: port ALU_ENABLE_1.OUTPUT_7 SHL_8BIT.ENABLE
N$49: port ALU_ENABLE_1.OUTPUT_6 NOT_8BIT.ENABLE
N$52: port ALU_ENABLE_2.OUTPUT_4 RCL_8BIT.ENABLE
N$55: port ALU_ENABLE_1.OUTPUT_4 AND_8BIT.ENABLE
N$59: port ALU_ENABLE_2.OUTPUT_6 SAR_8BIT.ENABLE
N$62: port ALU_ENABLE_2.OUTPUT_2 NEG_8BIT.ENABLE
N$64: port ALU_ENABLE_1.OUTPUT_5 ADD_SUB_8BIT.ENABLE_ADD
N$65: port ALU_ENABLE_2.OUTPUT_1 ADD_SUB_8BIT.ENABLE_SUB
N$66: port ALU_ENABLE_1.OUTPUT_8 ADC_8BIT.ENABLE
N$67: port ALU_ENABLE_2.OUTPUT_3 SBB_8BIT.ENABLE
N$68: port ALU_ENABLE_2.OUTPUT_7 RCR_8BIT.ENABLE
OPCODE_1: OPCODE.1 ; port 4-TO-16_DECODER.INPUT_1
OPCODE_2: OPCODE.2 ; port 4-TO-16_DECODER.INPUT_2
OPCODE_3: OPCODE.3 ; port 4-TO-16_DECODER.INPUT_3
OPCODE_4: OPCODE.4 ; port 4-TO-16_DECODER.INPUT_4
OUTPUT1: OUTPUT.1 ; port XOR_8BIT.OUTPUT_1 OR_8BIT.OUTPUT_1 AND_8BIT.OUTPUT_1 ADD_SUB_8BIT.OUTPUT1 NOT_8BIT.OUTPUT1 SHL_8BIT.OUTPUT1 SHR_8BIT.OUTPUT1 RCL_8BIT.OUTPUT1 ADC_8BIT.OUTPUT1 SBB_8BIT.OUTPUT1 NEG_8BIT.OUTPUT1 SAR_8BIT.OUTPUT1 MOV8_8BIT.OUTPUT1 RCR_8BIT.OUTPUT1
OUTPUT2: OUTPUT.2 ; port XOR_8BIT.OUTPUT_2 OR_8BIT.OUTPUT_2 AND_8BIT.OUTPUT_2 ADD_SUB_8BIT.OUTPUT2 NOT_8BIT.OUTPUT2 SHL_8BIT.OUTPUT2 SHR_8BIT.OUTPUT2 RCL_8BIT.OUTPUT2 MOV8_8BIT.OUTPUT2 ADC_8BIT.OUTPUT2 SBB_8BIT.OUTPUT2 NEG_8BIT.OUTPUT2 SAR_8BIT.OUTPUT2 RCR_8BIT.OUTPUT2
OUTPUT3: OUTPUT.3 ; port XOR_8BIT.OUTPUT_3 OR_8BIT.OUTPUT_3 AND_8BIT.OUTPUT_3 ADD_SUB_8BIT.OUTPUT3 NOT_8BIT.OUTPUT3 SHL_8BIT.OUTPUT3 SHR_8BIT.OUTPUT3 RCL_8BIT.OUTPUT3 MOV8_8BIT.OUTPUT3 ADC_8BIT.OUTPUT3 SBB_8BIT.OUTPUT3 NEG_8BIT.OUTPUT3 SAR_8BIT.OUTPUT3 RCR_8BIT.OUTPUT3
OUTPUT4: OUTPUT.4 ; port XOR_8BIT.OUTPUT_4 OR_8BIT.OUTPUT_4 AND_8BIT.OUTPUT_4 ADD_SUB_8BIT.OUTPUT4 NOT_8BIT.OUTPUT4 SHL_8BIT.OUTPUT4 SHR_8BIT.OUTPUT4 RCL_8BIT.OUTPUT4 MOV8_8BIT.OUTPUT4 ADC_8BIT.OUTPUT4 SBB_8BIT.OUTPUT4 NEG_8BIT.OUTPUT4 SAR_8BIT.OUTPUT4 RCR_8BIT.OUTPUT4
OUTPUT5: OUTPUT.5 ; port XOR_8BIT.OUTPUT_5 OR_8BIT.OUTPUT_5 AND_8BIT.OUTPUT_5 ADD_SUB_8BIT.OUTPUT5 NOT_8BIT.OUTPUT5 SHL_8BIT.OUTPUT5 SHR_8BIT.OUTPUT5 RCL_8BIT.OUTPUT5 MOV8_8BIT.OUTPUT5 ADC_8BIT.OUTPUT5 SBB_8BIT.OUTPUT5 NEG_8BIT.OUTPUT5 SAR_8BIT.OUTPUT5 RCR_8BIT.OUTPUT5
OUTPUT6: OUTPUT.6 ; port AND_8BIT.OUTPUT_6 XOR_8BIT.OUTPUT_6 OR_8BIT.OUTPUT_6 ADD_SUB_8BIT.OUTPUT6 NOT_8BIT.OUTPUT6 SHL_8BIT.OUTPUT6 SHR_8BIT.OUTPUT6 RCL_8BIT.OUTPUT6 MOV8_8BIT.OUTPUT6 ADC_8BIT.OUTPUT6 SBB_8BIT.OUTPUT6 NEG_8BIT.OUTPUT6 SAR_8BIT.OUTPUT6 RCR_8BIT.OUTPUT6
OUTPUT7: OUTPUT.7 ; port XOR_8BIT.OUTPUT_7 OR_8BIT.OUTPUT_7 AND_8BIT.OUTPUT_7 ADD_SUB_8BIT.OUTPUT7 NOT_8BIT.OUTPUT7 SHL_8BIT.OUTPUT7 SHR_8BIT.OUTPUT7 RCL_8BIT.OUTPUT7 MOV8_8BIT.OUTPUT7 ADC_8BIT.OUTPUT7 SBB_8BIT.OUTPUT7 NEG_8BIT.OUTPUT7 SAR_8BIT.OUTPUT7 RCR_8BIT.OUTPUT7
OUTPUT8: OUTPUT.8 ; port XOR_8BIT.OUTPUT_8 OR_8BIT.OUTPUT_8 AND_8BIT.OUTPUT_8 ADD_SUB_8BIT.OUTPUT8 NOT_8BIT.OUTPUT8 SHL_8BIT.OUTPUT8 SHR_8BIT.OUTPUT8 RCL_8BIT.OUTPUT8 MOV8_8BIT.OUTPUT8 ADC_8BIT.OUTPUT8 SBB_8BIT.OUTPUT8 NEG_8BIT.OUTPUT8 SAR_8BIT.OUTPUT8 RCR_8BIT.OUTPUT8
OVERFLOW: FLAGS.4
SIGN: FLAGS.1
VCC: POWER.1 ; port XOR_8BIT.VCC OR_8BIT.VCC AND_8BIT.VCC ADD_SUB_8BIT.VCC NOT_8BIT.VCC SHL_8BIT.VCC SHR_8BIT.VCC RCL_8BIT.VCC MOV8_8BIT.VCC ADC_8BIT.VCC SBB_8BIT.VCC NEG_8BIT.VCC SAR_8BIT.VCC RCR_8BIT.VCC
ZERO: FLAGS.2

### Library data of the parts
ALU_OPERATION = pinhead:PINHD-1X1: PIN HEADER
FLAGS OPCODE = pinhead:PINHD-1X4: PIN HEADER
INPUT_A INPUT_B OUTPUT = pinhead:PINHD-1X8: PIN HEADER
POWER = pinhead:PINHD-1X2: PIN HEADER

## Module ALU_DECODER
Ports: I1(in) I2(in) I3(in) I4(in) I5(in) I6(in) I7(in) I8(in) T1(in) T2(in) T3(in) T4(in) T5(in) T6(in) T7(in) T8(in) SELECT_A_TO_ALU(out) SELECT_B_TO_ALU(out) SELECT_INSTRUCTION_TO_ALU(out) LOAD_C_FROM_DATABUS_ALU(out) LOAD_FLAGS_FROM_ALU(out) ENABLE_ALU_DECODDER(out) VCC(in) GND(in)
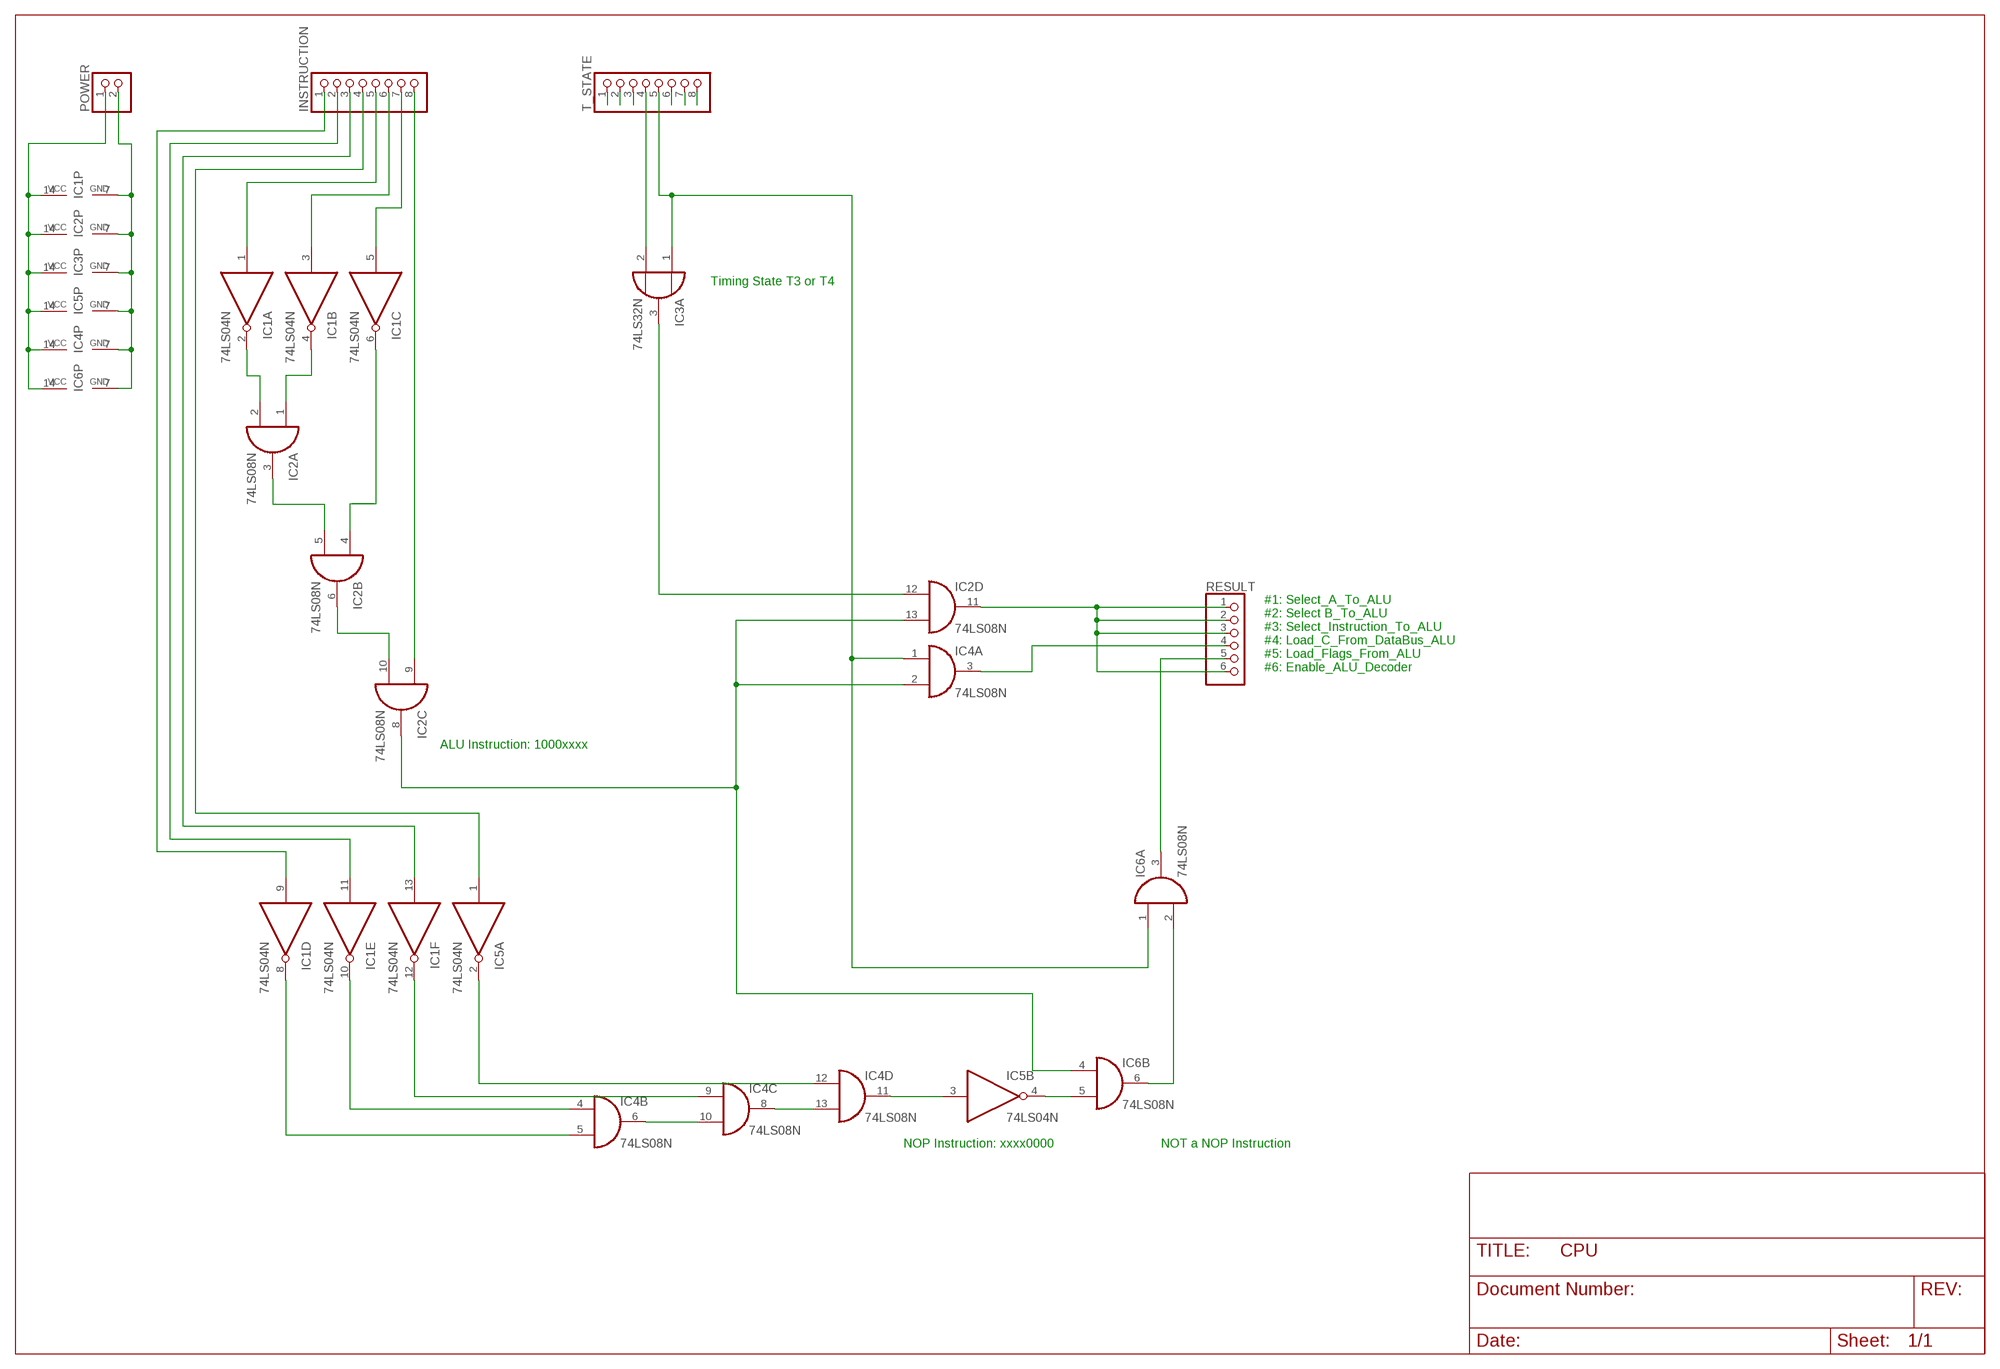
[diagram p45: schematic, module ALU_DECODER, sheet 1]

### Parts
IC1  74LS04N  [DIL14]
IC2  74LS08N  [DIL14]
IC3  74LS32N  [DIL14]
IC4  74LS08N  [DIL14]
IC5  74LS04N  [DIL14]
IC6  74LS08N  [DIL14]
INSTRUCTION  PINHD-1X8  [1X08]
POWER  PINHD-1X2  [1X02]
RESULT  PINHD-1X6  [1X06]
T_STATE  PINHD-1X8  [1X08]

### Nets
ENABLE_ALU_DECODDER: IC2.11(D:O) RESULT.1 RESULT.2 RESULT.3 RESULT.6
GND: IC1.7(P:GND) IC2.7(P:GND) IC3.7(P:GND) IC4.7(P:GND) IC5.7(P:GND) IC6.7(P:GND) POWER.2
I1: IC1.9(D:I) INSTRUCTION.1
I2: IC1.11(E:I) INSTRUCTION.2
I3: IC1.13(F:I) INSTRUCTION.3
I4: IC5.1(A:I) INSTRUCTION.4
I5: IC1.1(A:I) INSTRUCTION.5
I6: IC1.3(B:I) INSTRUCTION.6
I7: IC1.5(C:I) INSTRUCTION.7
I8: IC2.9(C:I0) INSTRUCTION.8
LOAD_C_FROM_DATABUS_ALU: IC4.3(A:O) RESULT.4
LOAD_FLAGS_FROM_ALU: IC6.3(A:O) RESULT.5
N$4: IC1.2(A:O) IC2.2(A:I1)
N$5: IC1.4(B:O) IC2.1(A:I0)
N$6: IC2.3(A:O) IC2.5(B:I1)
N$7: IC1.6(C:O) IC2.4(B:I0)
N$9: IC2.6(B:O) IC2.10(C:I1)
N$12: IC2.8(C:O) IC2.13(D:I1) IC4.2(A:I1) IC6.4(B:I0)
N$13: IC2.12(D:I0) IC3.3(A:O)
N$20: IC1.8(D:O) IC4.5(B:I1)
N$21: IC1.10(E:O) IC4.4(B:I0)
N$22: IC4.6(B:O) IC4.10(C:I1)
N$23: IC1.12(F:O) IC4.9(C:I0)
N$24: IC4.8(C:O) IC4.13(D:I1)
N$25: IC4.12(D:I0) IC5.2(A:O)
N$26: IC4.11(D:O) IC5.3(B:I)
N$27: IC5.4(B:O) IC6.5(B:I1)
N$30: IC6.2(A:I1) IC6.6(B:O)
T1: T_STATE.1
T2: T_STATE.2
T3: T_STATE.3
T4: IC3.2(A:I1) T_STATE.4
T5: IC3.1(A:I0) IC4.1(A:I0) IC6.1(A:I0) T_STATE.5
T6: T_STATE.6
T7: T_STATE.7
T8: T_STATE.8
VCC: IC1.14(P:VCC) IC2.14(P:VCC) IC3.14(P:VCC) IC4.14(P:VCC) IC5.14(P:VCC) IC6.14(P:VCC) POWER.1
Unconnected: IC3.4(B:I0) IC3.5(B:I1) IC3.6(B:O) IC3.8(C:O) IC3.9(C:I0) IC3.10(C:I1) IC3.11(D:O) IC3.12(D:I0) IC3.13(D:I1) IC5.5(C:I) IC5.6(C:O) IC5.8(D:O) IC5.9(D:I) IC5.10(E:O) IC5.11(E:I) IC5.12(F:O) IC5.13(F:I) IC6.8(C:O) IC6.9(C:I0) IC6.10(C:I1) IC6.11(D:O) IC6.12(D:I0) IC6.13(D:I1)

### Notes on the sheet
- Timing State T3 or T4
- #1: Select_A_To_ALU
  #2: Select B_To_ALU
  #3: Select_Instruction_To_ALU
  #4: Load_C_From_DataBus_ALU
  #5: Load_Flags_From_ALU
  #6: Enable_ALU_Decoder
- ALU Instruction: 1000xxxx
- NOP Instruction: xxxx0000 | NOT a NOP Instruction

### Library data of the parts
IC1 IC5 = 74xx-eu:74*04: Hex INVERTER
IC2 IC4 IC6 = 74xx-eu:74*08: Quad 2-input AND gate
IC3 = 74xx-eu:74*32: Quad 2-input OR gate
INSTRUCTION T_STATE = pinhead:PINHD-1X8: PIN HEADER
POWER = pinhead:PINHD-1X2: PIN HEADER
RESULT = pinhead:PINHD-1X6: PIN HEADER

## Module ALU_IN_DECODER
Ports: T1(in) T2(in) T3(in) T4(in) T5(in) T6(in) T7(in) T8(in) I1(in) I2(in) I3(in) I4(in) I5(in) SOURCE1(in) SOURCE2(in) SOURCE3(in) SOURCE4(in) SOURCE5(in) SOURCE6(in) SOURCE7(in) SOURCE8(in) VCC(in) GND(in) A(out) B(out) D(out) E(out) F(out) G(out) H(out) XL(out) XH(out) XE(out)
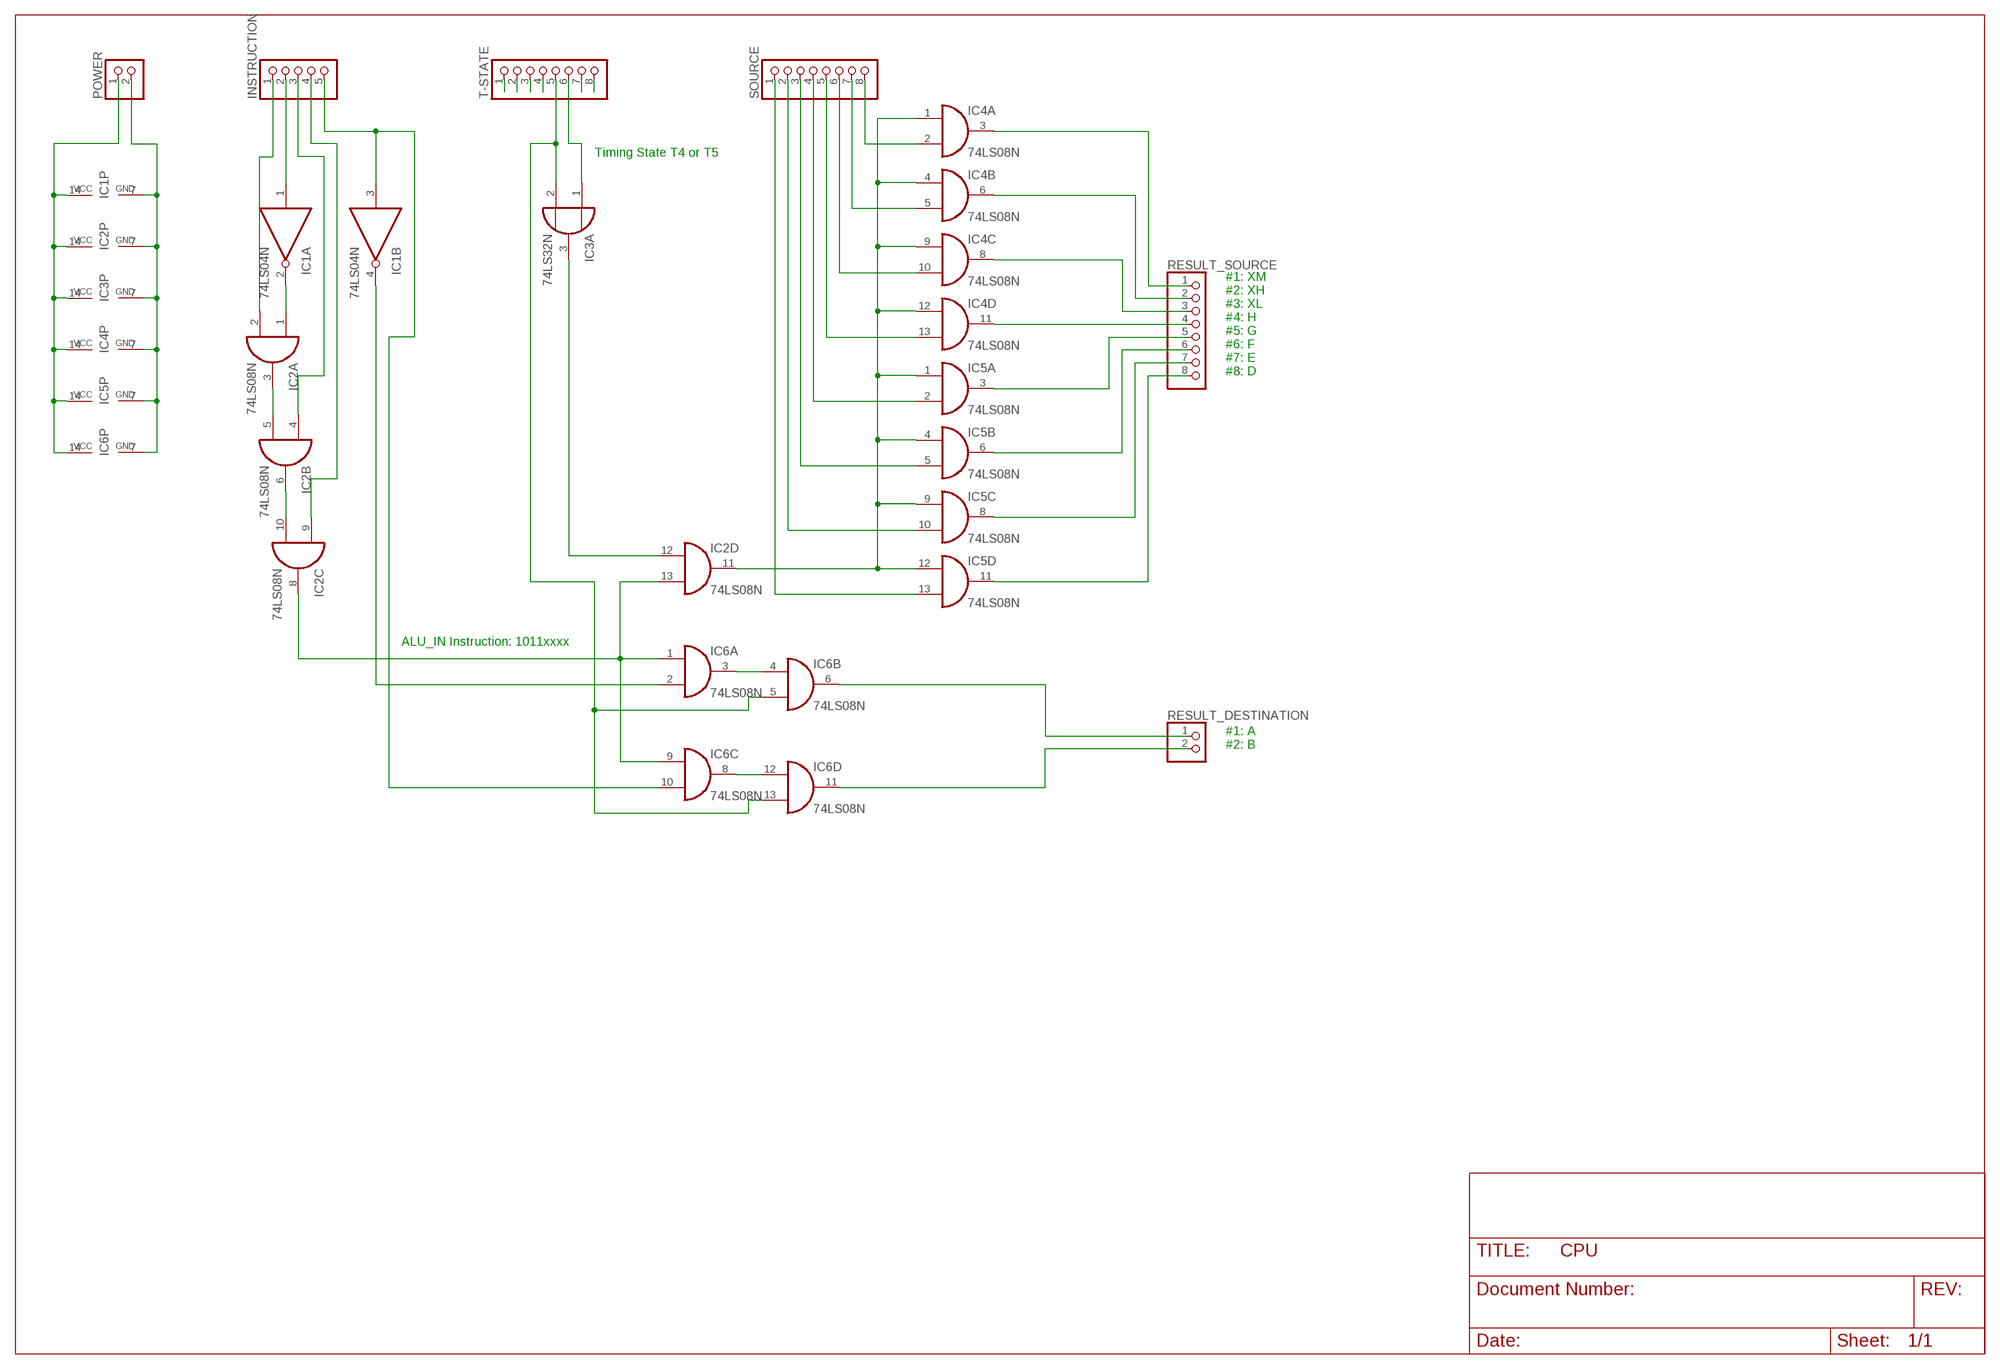
[diagram p46: schematic, module ALU_IN_DECODER, sheet 1]

### Parts
IC1  74LS04N  [DIL14]
IC2  74LS08N  [DIL14]
IC3  74LS32N  [DIL14]
IC4  74LS08N  [DIL14]
IC5  74LS08N  [DIL14]
IC6  74LS08N  [DIL14]
INSTRUCTION  PINHD-1X5  [1X05]
POWER  PINHD-1X2  [1X02]
RESULT_DESTINATION  PINHD-1X2  [1X02]
RESULT_SOURCE  PINHD-1X8  [1X08]
SOURCE  PINHD-1X8  [1X08]
T-STATE  PINHD-1X8  [1X08]

### Nets
A: IC6.6(B:O) RESULT_DESTINATION.1
B: IC6.11(D:O) RESULT_DESTINATION.2
D: IC5.11(D:O) RESULT_SOURCE.8
E: IC5.8(C:O) RESULT_SOURCE.7
F: IC5.6(B:O) RESULT_SOURCE.6
G: IC5.3(A:O) RESULT_SOURCE.5
GND: IC1.7(P:GND) IC2.7(P:GND) IC3.7(P:GND) IC4.7(P:GND) IC5.7(P:GND) IC6.7(P:GND) POWER.2
H: IC4.11(D:O) RESULT_SOURCE.4
I1: IC2.2(A:I1) INSTRUCTION.1
I2: IC1.1(A:I) INSTRUCTION.2
I3: IC2.4(B:I0) INSTRUCTION.3
I4: IC2.9(C:I0) INSTRUCTION.4
I5: IC1.3(B:I) IC6.10(C:I1) INSTRUCTION.5
N$4: IC1.2(A:O) IC2.1(A:I0)
N$5: IC2.3(A:O) IC2.5(B:I1)
N$7: IC2.6(B:O) IC2.10(C:I1)
N$9: IC2.8(C:O) IC2.13(D:I1) IC6.1(A:I0) IC6.9(C:I0)
N$12: IC2.12(D:I0) IC3.3(A:O)
N$13: IC2.11(D:O) IC4.1(A:I0) IC4.4(B:I0) IC4.9(C:I0) IC4.12(D:I0) IC5.1(A:I0) IC5.4(B:I0) IC5.9(C:I0) IC5.12(D:I0)
N$30: IC1.4(B:O) IC6.2(A:I1)
N$31: IC6.3(A:O) IC6.4(B:I0)
N$32: IC6.8(C:O) IC6.12(D:I0)
SOURCE1: IC5.13(D:I1) SOURCE.1
SOURCE2: IC5.10(C:I1) SOURCE.2
SOURCE3: IC5.5(B:I1) SOURCE.3
SOURCE4: IC5.2(A:I1) SOURCE.4
SOURCE5: IC4.13(D:I1) SOURCE.5
SOURCE6: IC4.10(C:I1) SOURCE.6
SOURCE7: IC4.5(B:I1) SOURCE.7
SOURCE8: IC4.2(A:I1) SOURCE.8
T1: T-STATE.1
T2: T-STATE.2
T3: T-STATE.3
T4: T-STATE.4
T5: IC3.2(A:I1) IC6.5(B:I1) IC6.13(D:I1) T-STATE.5
T6: IC3.1(A:I0) T-STATE.6
T7: T-STATE.7
T8: T-STATE.8
VCC: IC1.14(P:VCC) IC2.14(P:VCC) IC3.14(P:VCC) IC4.14(P:VCC) IC5.14(P:VCC) IC6.14(P:VCC) POWER.1
XE: IC4.3(A:O) RESULT_SOURCE.1
XH: IC4.6(B:O) RESULT_SOURCE.2
XL: IC4.8(C:O) RESULT_SOURCE.3
Unconnected: IC1.5(C:I) IC1.6(C:O) IC1.8(D:O) IC1.9(D:I) IC1.10(E:O) IC1.11(E:I) IC1.12(F:O) IC1.13(F:I) IC3.4(B:I0) IC3.5(B:I1) IC3.6(B:O) IC3.8(C:O) IC3.9(C:I0) IC3.10(C:I1) IC3.11(D:O) IC3.12(D:I0) IC3.13(D:I1)

### Notes on the sheet
- Timing State T4 or T5
- #1: XM
  #2: XH
  #3: XL
  #4: H
  #5: G
  #6: F
  #7: E
  #8: D
- ALU_IN Instruction: 1011xxxx
- #1: A
  #2: B

### Library data of the parts
IC1 = 74xx-eu:74*04: Hex INVERTER
IC2 IC4-IC6 = 74xx-eu:74*08: Quad 2-input AND gate
IC3 = 74xx-eu:74*32: Quad 2-input OR gate
INSTRUCTION = pinhead:PINHD-1X5: PIN HEADER
POWER RESULT_DESTINATION = pinhead:PINHD-1X2: PIN HEADER
RESULT_SOURCE SOURCE T-STATE = pinhead:PINHD-1X8: PIN HEADER

## Module ALU_OUT_DECODER
Ports: I1(in) I2(in) I3(in) I4(in) I5(in) DESTINATION_1(in) DESTINATION_2(in) DESTINATION_3(in) DESTINATION_4(in) DESTINATION_5(in) DESTINATION_6(in) DESTINATION_7(in) DESTINATION_8(in) VCC(in) GND(in) T1(in) T2(in) T3(in) T4(in) T5(in) T6(in) T7(in) T8(in) SELECT_C_TO_DATABUS(out) LOAD_D_FROM_DATABUS(out) LOAD_E_FROM_DATABUS(out) LOAD_F_FROM_DATABUS(out) LOAD_G_FROM_DATABUS(out) LOAD_H_FROM_DATABUS(out) LOAD_XL_FROM_DATABUS(out) LOAD_XH_FROM_DATABUS(out) LOAD_XE_FROM_DATABUS(out)
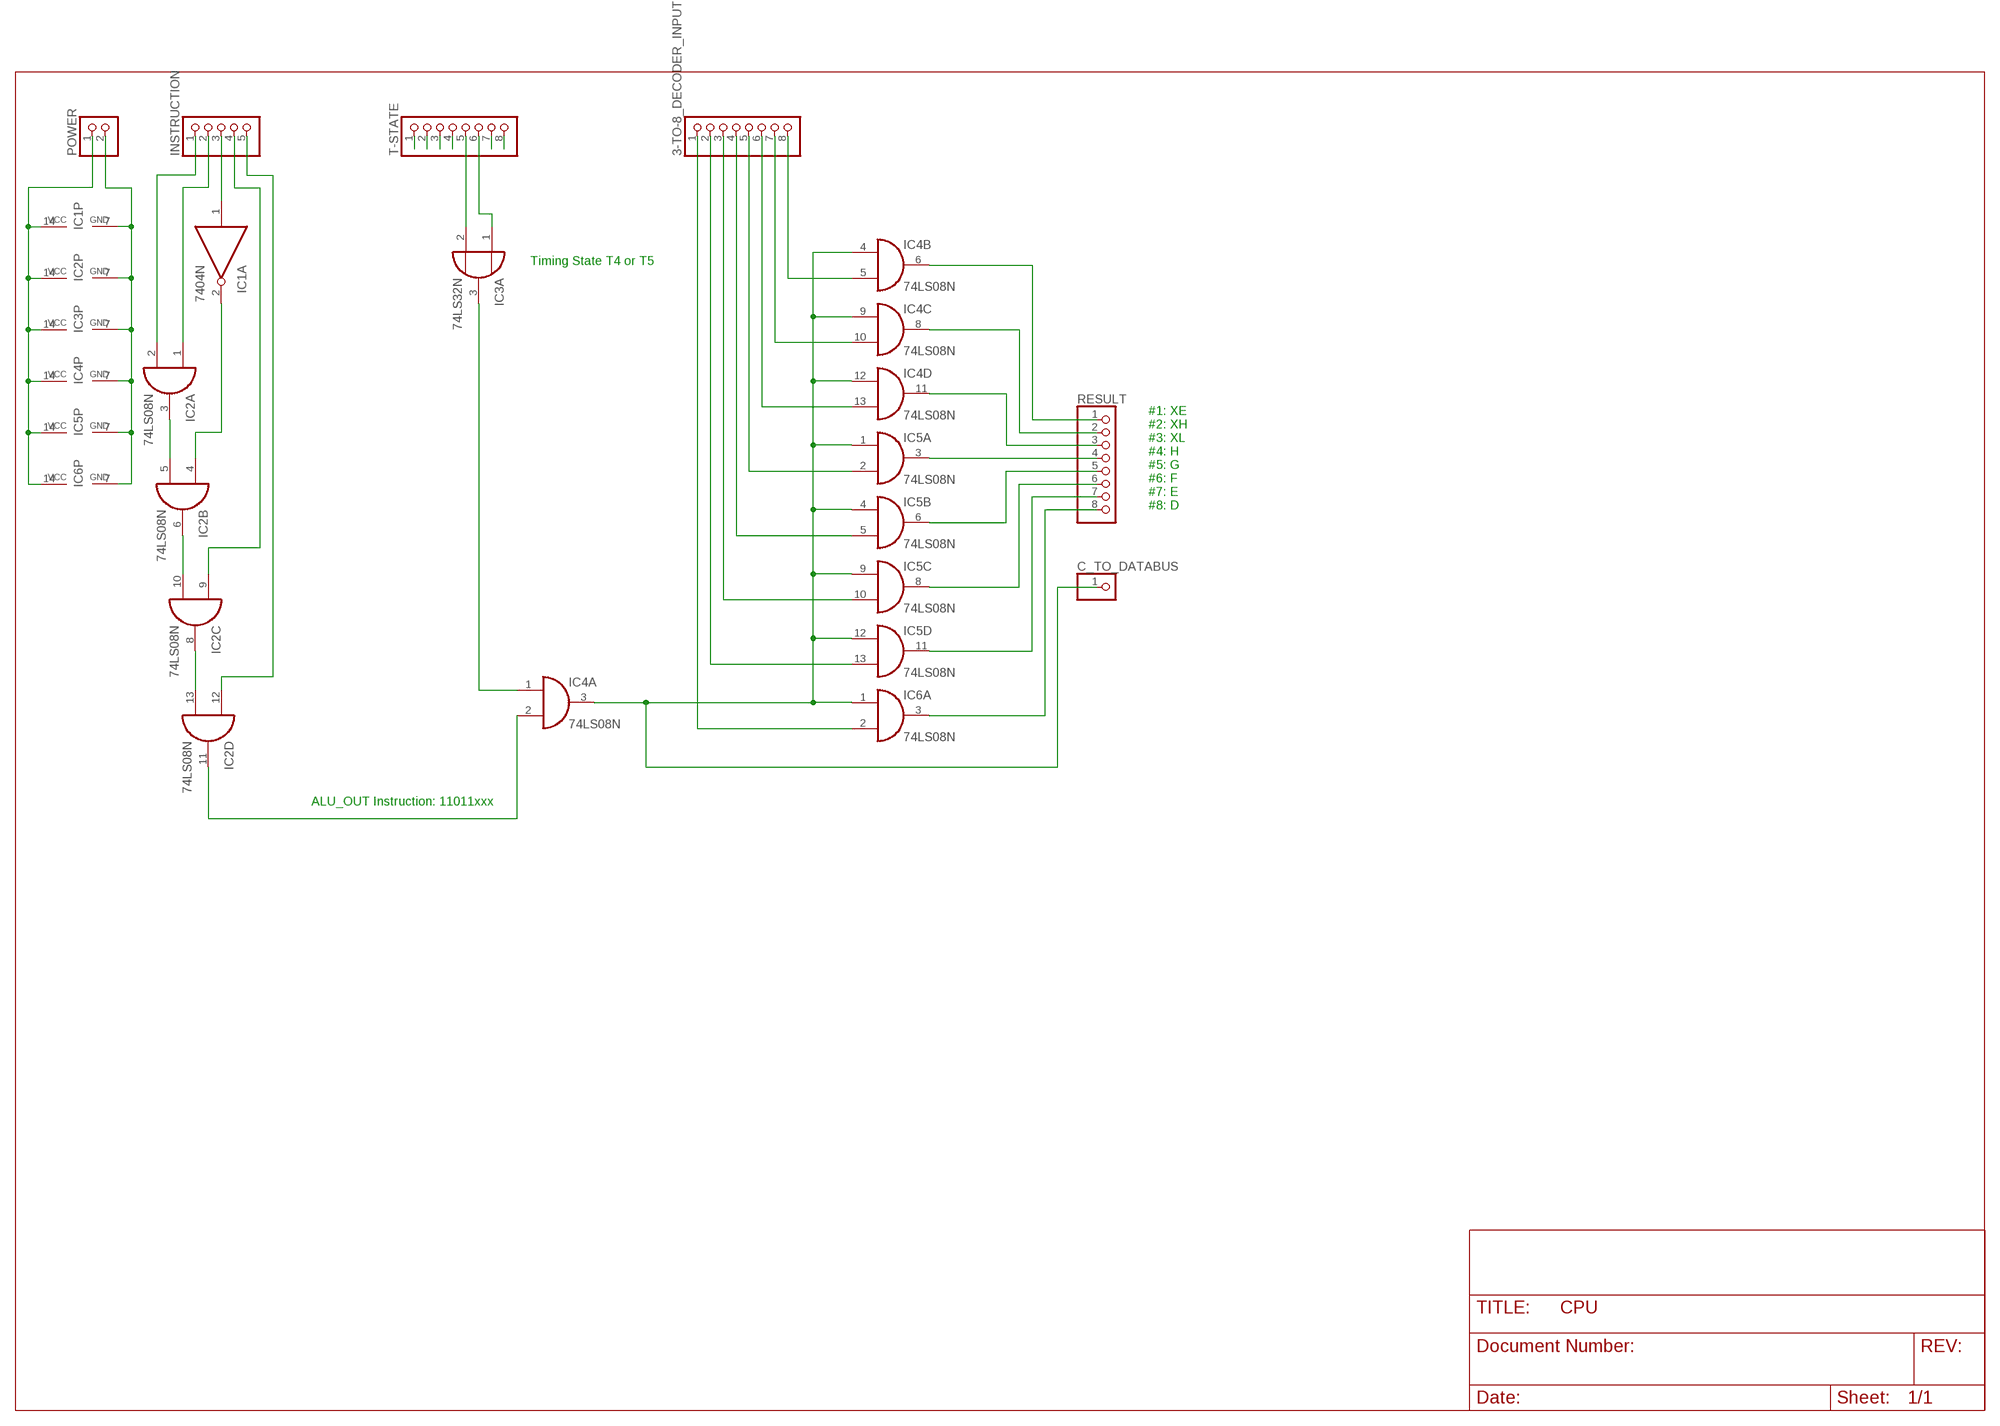
[diagram p47: schematic, module ALU_OUT_DECODER, sheet 1]

### Parts
3-TO-8_DECODER_INPUT  PINHD-1X8  [1X08]
C_TO_DATABUS  PINHD-1X1  [1X01]
IC1  7404N  [DIL14]
IC2  74LS08N  [DIL14]
IC3  74LS32N  [DIL14]
IC4  74LS08N  [DIL14]
IC5  74LS08N  [DIL14]
IC6  74LS08N  [DIL14]
INSTRUCTION  PINHD-1X5  [1X05]
POWER  PINHD-1X2  [1X02]
RESULT  PINHD-1X8  [1X08]
T-STATE  PINHD-1X8  [1X08]

### Nets
DESTINATION_1: 3-TO-8_DECODER_INPUT.1 IC6.2(A:I1)
DESTINATION_2: 3-TO-8_DECODER_INPUT.2 IC5.13(D:I1)
DESTINATION_3: 3-TO-8_DECODER_INPUT.3 IC5.10(C:I1)
DESTINATION_4: 3-TO-8_DECODER_INPUT.4 IC5.5(B:I1)
DESTINATION_5: 3-TO-8_DECODER_INPUT.5 IC5.2(A:I1)
DESTINATION_6: 3-TO-8_DECODER_INPUT.6 IC4.13(D:I1)
DESTINATION_7: 3-TO-8_DECODER_INPUT.7 IC4.10(C:I1)
DESTINATION_8: 3-TO-8_DECODER_INPUT.8 IC4.5(B:I1)
GND: IC1.7(P:GND) IC2.7(P:GND) IC3.7(P:GND) IC4.7(P:GND) IC5.7(P:GND) IC6.7(P:GND) POWER.2
I1: IC2.2(A:I1) INSTRUCTION.1
I2: IC2.1(A:I0) INSTRUCTION.2
I3: IC1.1(A:I) INSTRUCTION.3
I4: IC2.9(C:I0) INSTRUCTION.4
I5: IC2.12(D:I0) INSTRUCTION.5
LOAD_D_FROM_DATABUS: IC6.3(A:O) RESULT.8
LOAD_E_FROM_DATABUS: IC5.11(D:O) RESULT.7
LOAD_F_FROM_DATABUS: IC5.8(C:O) RESULT.6
LOAD_G_FROM_DATABUS: IC5.6(B:O) RESULT.5
LOAD_H_FROM_DATABUS: IC5.3(A:O) RESULT.4
LOAD_XE_FROM_DATABUS: IC4.6(B:O) RESULT.1
LOAD_XH_FROM_DATABUS: IC4.8(C:O) RESULT.2
LOAD_XL_FROM_DATABUS: IC4.11(D:O) RESULT.3
N$4: IC2.3(A:O) IC2.5(B:I1)
N$5: IC1.2(A:O) IC2.4(B:I0)
N$6: IC2.6(B:O) IC2.10(C:I1)
N$8: IC2.8(C:O) IC2.13(D:I1)
N$10: IC2.11(D:O) IC4.2(A:I1)
N$13: IC3.3(A:O) IC4.1(A:I0)
SELECT_C_TO_DATABUS: C_TO_DATABUS.1 IC4.3(A:O) IC4.4(B:I0) IC4.9(C:I0) IC4.12(D:I0) IC5.1(A:I0) IC5.4(B:I0) IC5.9(C:I0) IC5.12(D:I0) IC6.1(A:I0)
T1: T-STATE.1
T2: T-STATE.2
T3: T-STATE.3
T4: T-STATE.4
T5: IC3.2(A:I1) T-STATE.5
T6: IC3.1(A:I0) T-STATE.6
T7: T-STATE.7
T8: T-STATE.8
VCC: IC1.14(P:VCC) IC2.14(P:VCC) IC3.14(P:VCC) IC4.14(P:VCC) IC5.14(P:VCC) IC6.14(P:VCC) POWER.1
Unconnected: IC1.3(B:I) IC1.4(B:O) IC1.5(C:I) IC1.6(C:O) IC1.8(D:O) IC1.9(D:I) IC1.10(E:O) IC1.11(E:I) IC1.12(F:O) IC1.13(F:I) IC3.4(B:I0) IC3.5(B:I1) IC3.6(B:O) IC3.8(C:O) IC3.9(C:I0) IC3.10(C:I1) IC3.11(D:O) IC3.12(D:I0) IC3.13(D:I1) IC6.4(B:I0) IC6.5(B:I1) IC6.6(B:O) IC6.8(C:O) IC6.9(C:I0) IC6.10(C:I1) IC6.11(D:O) IC6.12(D:I0) IC6.13(D:I1)

### Notes on the sheet
- Timing State T4 or T5
- #1: XE
  #2: XH
  #3: XL
  #4: H
  #5: G
  #6: F
  #7: E
  #8: D
- ALU_OUT Instruction: 11011xxx

### Library data of the parts
3-TO-8_DECODER_INPUT RESULT T-STATE = pinhead:PINHD-1X8: PIN HEADER
C_TO_DATABUS = pinhead:PINHD-1X1: PIN HEADER
IC1 = 74xx-eu:74*04: Hex INVERTER
IC2 IC4-IC6 = 74xx-eu:74*08: Quad 2-input AND gate
IC3 = 74xx-eu:74*32: Quad 2-input OR gate
INSTRUCTION = pinhead:PINHD-1X5: PIN HEADER
POWER = pinhead:PINHD-1X2: PIN HEADER

## Module LOAD_DECODER
Ports: I1(in) I2(in) I3(in) I4(in) I5(in) I6(in) I7(in) I8(in) T1(in) T2(in) T3(in) T4(in) T5(in) T6(in) T7(in) T8(in) VCC(in) GND(in) LOAD_INSTRUCTION(out) SELECT_M_TO_ADDRESSBUS(out) SELECT_SRAM_LOAD(out)
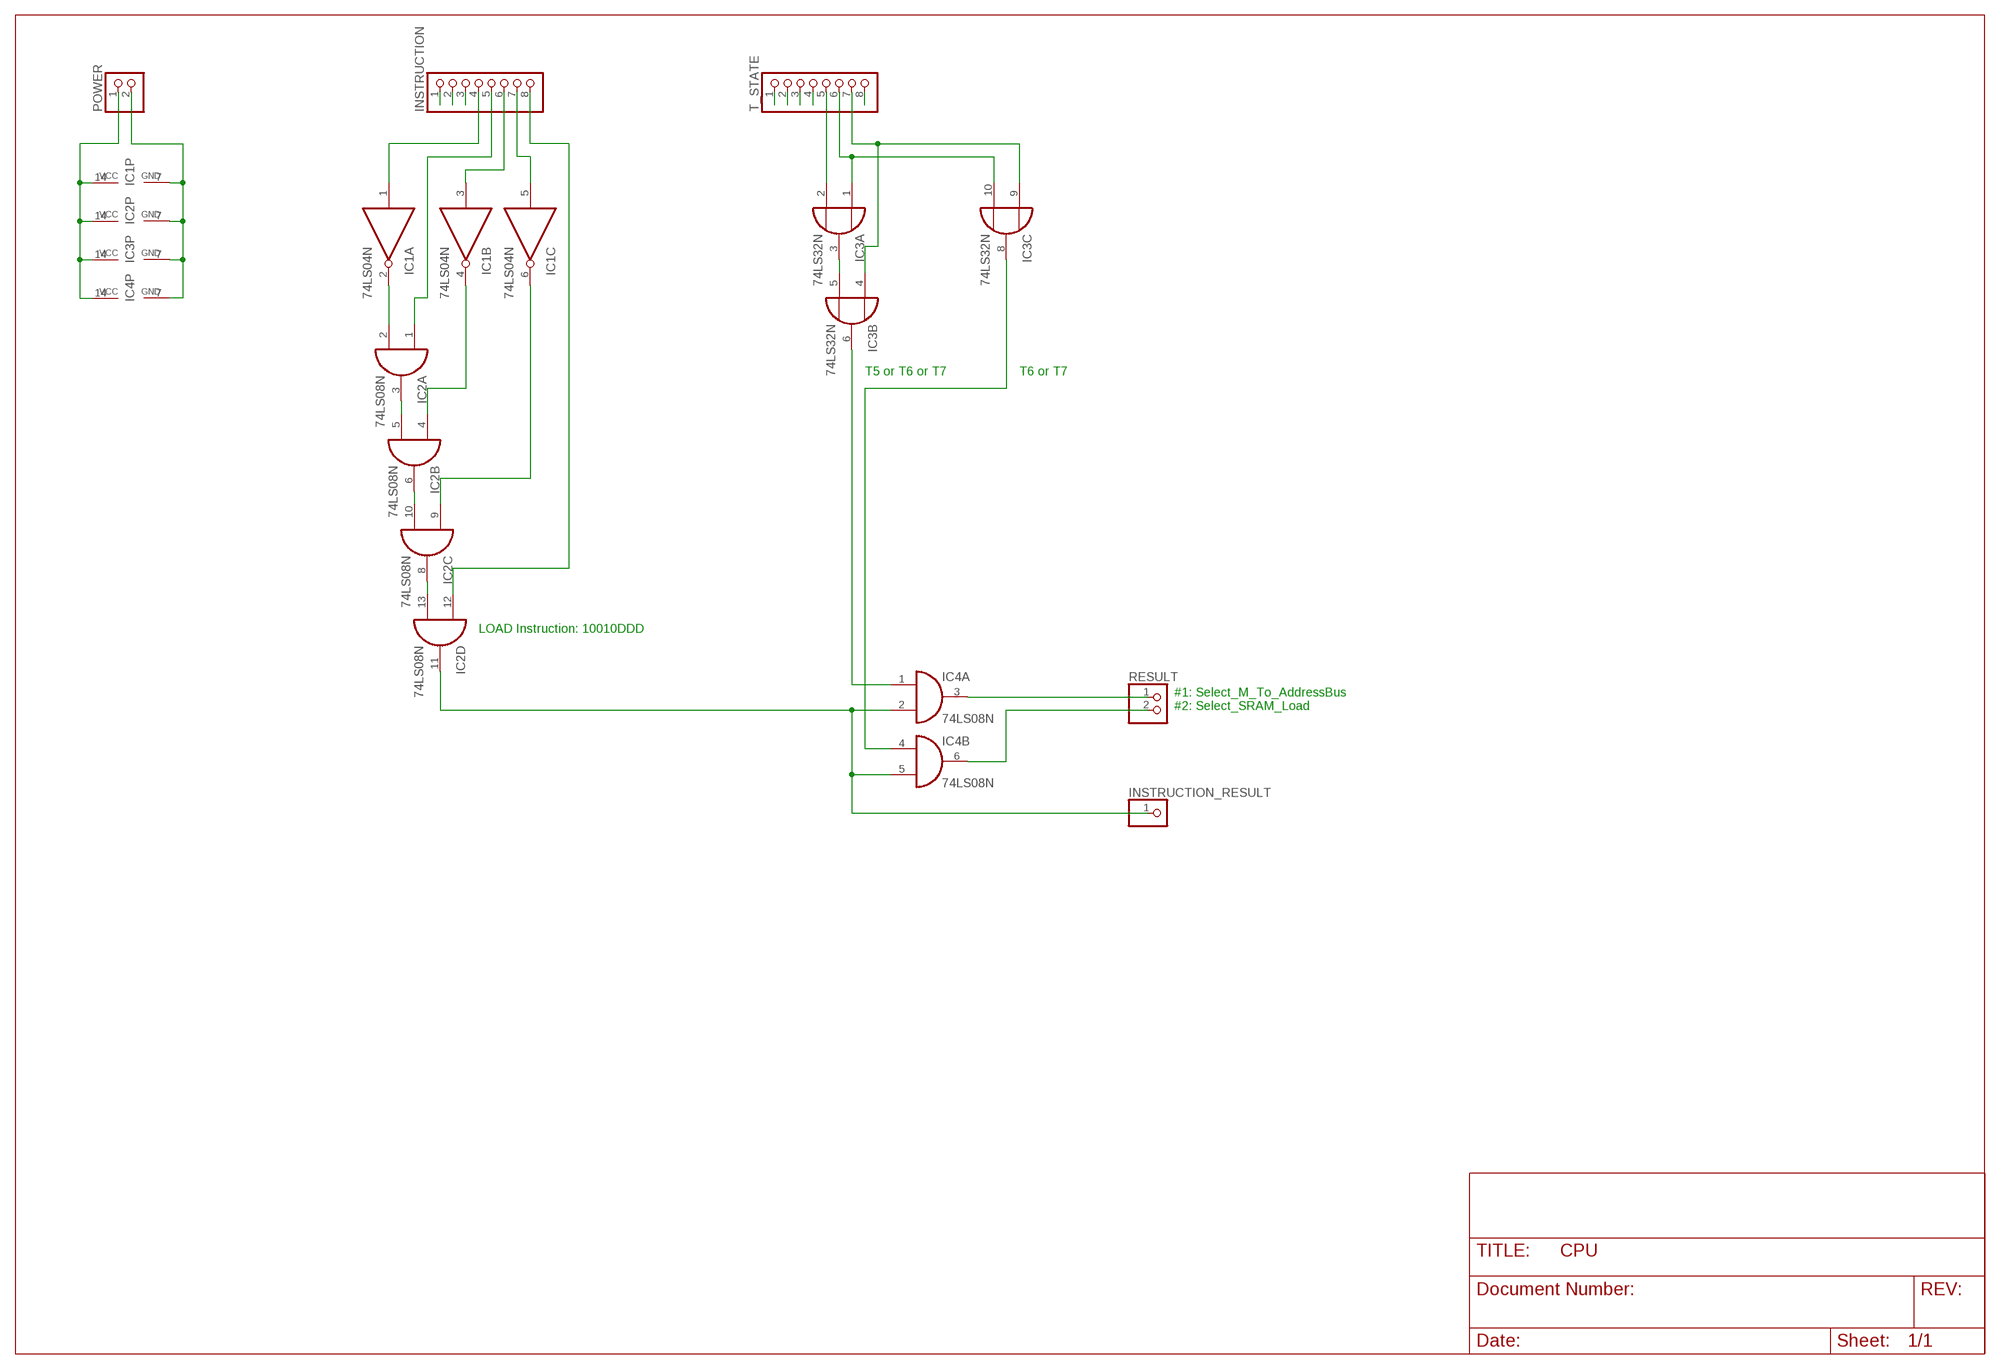
[diagram p48: schematic, module LOAD_DECODER, sheet 1]

### Parts
IC1  74LS04N  [DIL14]
IC2  74LS08N  [DIL14]
IC3  74LS32N  [DIL14]
IC4  74LS08N  [DIL14]
INSTRUCTION  PINHD-1X8  [1X08]
INSTRUCTION_RESULT  PINHD-1X1  [1X01]
POWER  PINHD-1X2  [1X02]
RESULT  PINHD-1X2  [1X02]
T_STATE  PINHD-1X8  [1X08]

### Nets
GND: IC1.7(P:GND) IC2.7(P:GND) IC3.7(P:GND) IC4.7(P:GND) POWER.2
I1: INSTRUCTION.1
I2: INSTRUCTION.2
I3: INSTRUCTION.3
I4: IC1.1(A:I) INSTRUCTION.4
I5: IC2.1(A:I0) INSTRUCTION.5
I6: IC1.3(B:I) INSTRUCTION.6
I7: IC1.5(C:I) INSTRUCTION.7
I8: IC2.12(D:I0) INSTRUCTION.8
LOAD_INSTRUCTION: IC2.11(D:O) IC4.2(A:I1) IC4.5(B:I1) INSTRUCTION_RESULT.1
N$4: IC1.2(A:O) IC2.2(A:I1)
N$6: IC2.3(A:O) IC2.5(B:I1)
N$7: IC1.4(B:O) IC2.4(B:I0)
N$8: IC2.6(B:O) IC2.10(C:I1)
N$9: IC1.6(C:O) IC2.9(C:I0)
N$10: IC2.8(C:O) IC2.13(D:I1)
N$14: IC3.3(A:O) IC3.5(B:I1)
N$17: IC3.6(B:O) IC4.1(A:I0)
N$19: IC3.8(C:O) IC4.4(B:I0)
SELECT_M_TO_ADDRESSBUS: IC4.3(A:O) RESULT.1
SELECT_SRAM_LOAD: IC4.6(B:O) RESULT.2
T1: T_STATE.1
T2: T_STATE.2
T3: T_STATE.3
T4: T_STATE.4
T5: IC3.2(A:I1) T_STATE.5
T6: IC3.1(A:I0) IC3.10(C:I1) T_STATE.6
T7: IC3.4(B:I0) IC3.9(C:I0) T_STATE.7
T8: T_STATE.8
VCC: IC1.14(P:VCC) IC2.14(P:VCC) IC3.14(P:VCC) IC4.14(P:VCC) POWER.1
Unconnected: IC1.8(D:O) IC1.9(D:I) IC1.10(E:O) IC1.11(E:I) IC1.12(F:O) IC1.13(F:I) IC3.11(D:O) IC3.12(D:I0) IC3.13(D:I1) IC4.8(C:O) IC4.9(C:I0) IC4.10(C:I1) IC4.11(D:O) IC4.12(D:I0) IC4.13(D:I1)

### Notes on the sheet
- T5 or T6 or T7 | T6 or T7
- LOAD Instruction: 10010DDD
- #1: Select_M_To_AddressBus
  #2: Select_SRAM_Load

### Library data of the parts
IC1 = 74xx-eu:74*04: Hex INVERTER
IC2 IC4 = 74xx-eu:74*08: Quad 2-input AND gate
IC3 = 74xx-eu:74*32: Quad 2-input OR gate
INSTRUCTION T_STATE = pinhead:PINHD-1X8: PIN HEADER
INSTRUCTION_RESULT = pinhead:PINHD-1X1: PIN HEADER
POWER RESULT = pinhead:PINHD-1X2: PIN HEADER

## Module LOAD_DESTINATION_REGISTER
Ports: T1(in) T2(in) T3(in) T4(in) T5(in) T6(in) T7(in) T8(in) D_REGISTER_INPUT(in) E_REGISTER_INPUT(in) F_REGISTER_INPUT(in) G_REGISTER_INPUT(in) H_REGISTER_INPUT(in) XL_REGISTER_INPUT(in) XH_REGISTER_INPUT(in) XE_REGISTER_INPUT(in) LOAD_INSTRUCTION(in) D_REGISTER_OUTPUT(out) E_REGISTER_OUTPUT(out) F_REGISTER_OUTPUT(out) G_REGISTER_OUTPUT(out) H_REGISTER_OUTPUT(out) XL_REGISTER_OUTPUT(out) XH_REGISTER_OUTPUT(out) XE_REGISTER_OUTPUT(out) VCC(in) GND(in)
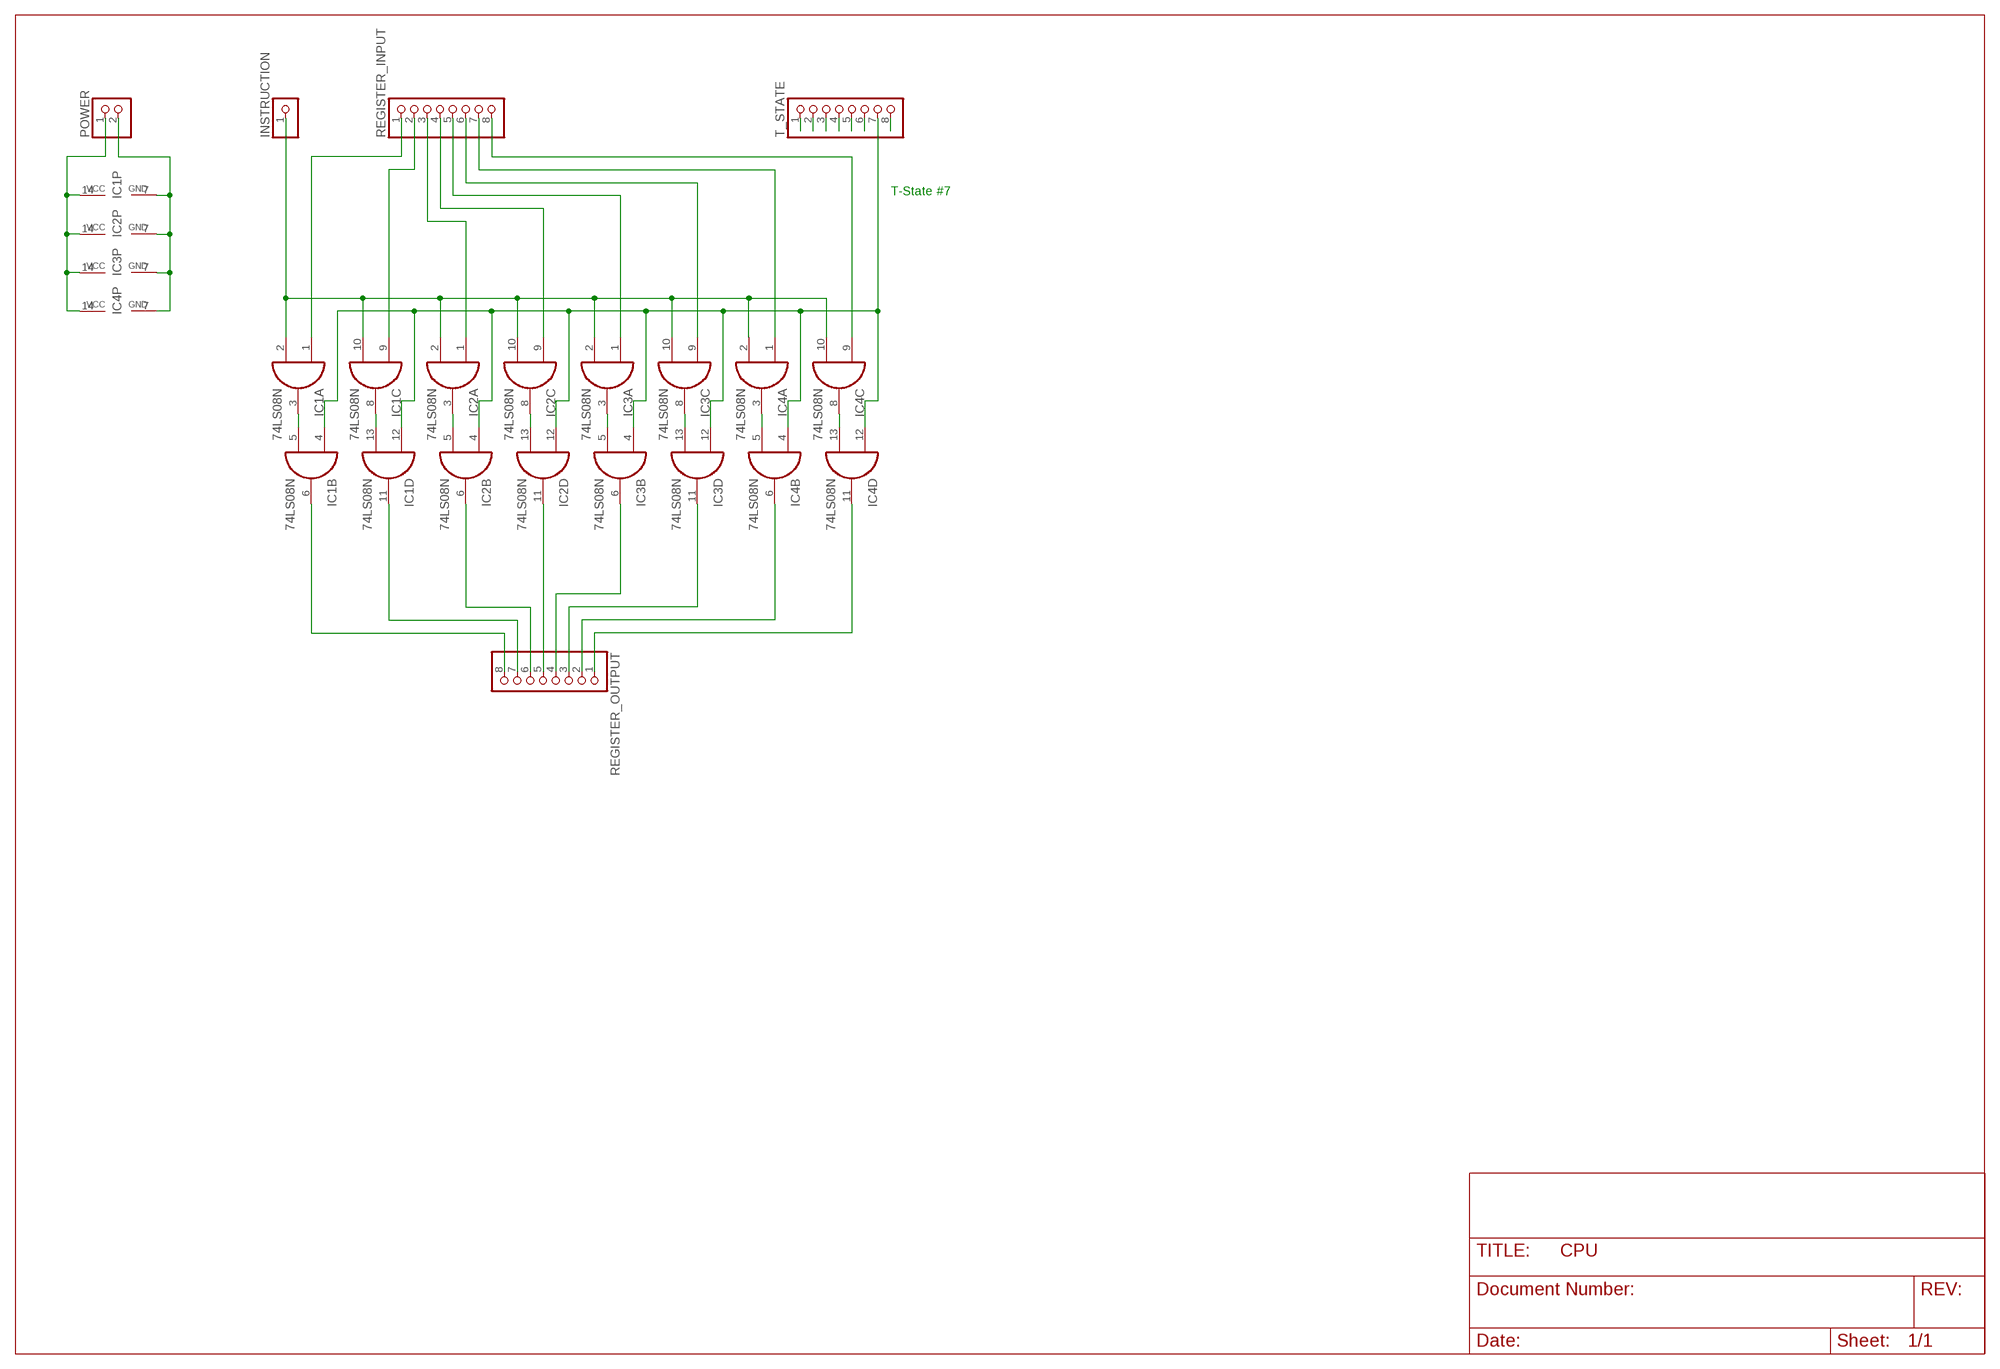
[diagram p49: schematic, module LOAD_DESTINATION_REGISTER, sheet 1]

### Parts
IC1  74LS08N  [DIL14]
IC2  74LS08N  [DIL14]
IC3  74LS08N  [DIL14]
IC4  74LS08N  [DIL14]
INSTRUCTION  PINHD-1X1  [1X01]
POWER  PINHD-1X2  [1X02]
REGISTER_INPUT  PINHD-1X8  [1X08]
REGISTER_OUTPUT  PINHD-1X8  [1X08]
T_STATE  PINHD-1X8  [1X08]

### Nets
D_REGISTER_INPUT: IC1.1(A:I0) REGISTER_INPUT.1
D_REGISTER_OUTPUT: IC1.6(B:O) REGISTER_OUTPUT.8
E_REGISTER_INPUT: IC1.9(C:I0) REGISTER_INPUT.2
E_REGISTER_OUTPUT: IC1.11(D:O) REGISTER_OUTPUT.7
F_REGISTER_INPUT: IC2.1(A:I0) REGISTER_INPUT.3
F_REGISTER_OUTPUT: IC2.6(B:O) REGISTER_OUTPUT.6
G_REGISTER_INPUT: IC2.9(C:I0) REGISTER_INPUT.4
G_REGISTER_OUTPUT: IC2.11(D:O) REGISTER_OUTPUT.5
GND: IC1.7(P:GND) IC2.7(P:GND) IC3.7(P:GND) IC4.7(P:GND) POWER.2
H_REGISTER_INPUT: IC3.1(A:I0) REGISTER_INPUT.5
H_REGISTER_OUTPUT: IC3.6(B:O) REGISTER_OUTPUT.4
LOAD_INSTRUCTION: IC1.2(A:I1) IC1.10(C:I1) IC2.2(A:I1) IC2.10(C:I1) IC3.2(A:I1) IC3.10(C:I1) IC4.2(A:I1) IC4.10(C:I1) INSTRUCTION.1
N$3: IC1.3(A:O) IC1.5(B:I1)
N$6: IC1.8(C:O) IC1.13(D:I1)
N$8: IC2.3(A:O) IC2.5(B:I1)
N$10: IC2.8(C:O) IC2.13(D:I1)
N$12: IC3.3(A:O) IC3.5(B:I1)
N$14: IC3.8(C:O) IC3.13(D:I1)
N$16: IC4.3(A:O) IC4.5(B:I1)
N$18: IC4.8(C:O) IC4.13(D:I1)
T1: T_STATE.1
T2: T_STATE.2
T3: T_STATE.3
T4: T_STATE.4
T5: T_STATE.5
T6: T_STATE.6
T7: IC1.4(B:I0) IC1.12(D:I0) IC2.4(B:I0) IC2.12(D:I0) IC3.4(B:I0) IC3.12(D:I0) IC4.4(B:I0) IC4.12(D:I0) T_STATE.7
T8: T_STATE.8
VCC: IC1.14(P:VCC) IC2.14(P:VCC) IC3.14(P:VCC) IC4.14(P:VCC) POWER.1
XE_REGISTER_INPUT: IC4.9(C:I0) REGISTER_INPUT.8
XE_REGISTER_OUTPUT: IC4.11(D:O) REGISTER_OUTPUT.1
XH_REGISTER_INPUT: IC4.1(A:I0) REGISTER_INPUT.7
XH_REGISTER_OUTPUT: IC4.6(B:O) REGISTER_OUTPUT.2
XL_REGISTER_INPUT: IC3.9(C:I0) REGISTER_INPUT.6
XL_REGISTER_OUTPUT: IC3.11(D:O) REGISTER_OUTPUT.3

### Notes on the sheet
- T-State #7

### Library data of the parts
IC1-IC4 = 74xx-eu:74*08: Quad 2-input AND gate
INSTRUCTION = pinhead:PINHD-1X1: PIN HEADER
POWER = pinhead:PINHD-1X2: PIN HEADER
REGISTER_INPUT REGISTER_OUTPUT T_STATE = pinhead:PINHD-1X8: PIN HEADER

## Module ALU_IN
Ports: I1(in) I2(in) I3(in) I4(in) I5(in) I6(in) I7(in) I8(in) T1(in) T2(in) T3(in) T4(in) T5(in) T6(in) T7(in) T8(in) VCC(in) GND(in) LOAD_A_FROM_DATABUS(out) LOAD_B_FROM_DATABUS(out) SELECT_D_TO_DATABUS(out) SELECT_E_TO_DATABUS(out) SELECT_F_TO_DATABUS(out) SELECT_G_TO_DATABUS(out) SELECT_H_TO_DATABUS(out) SELECT_XE_TO_DATABUS(out) SELECT_XH_TO_DATABUS(out) SELECT_XL_TO_DATABUS(out)
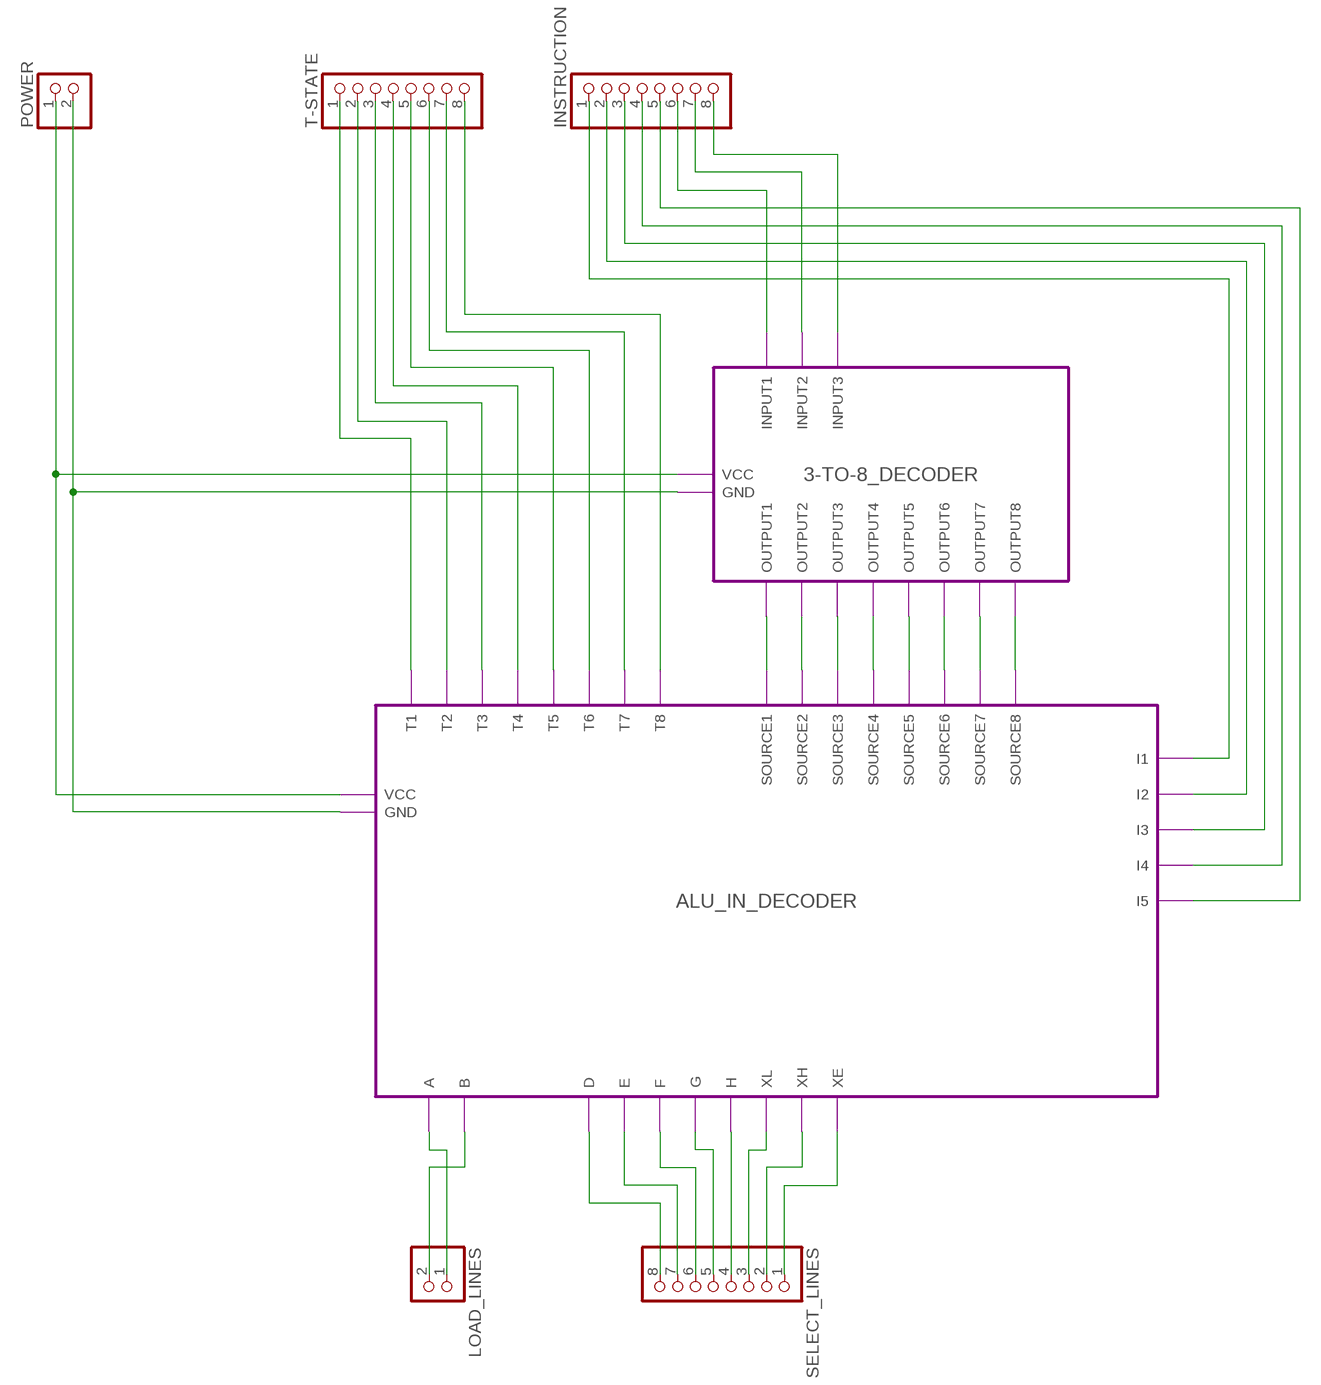
[diagram p50: schematic, module ALU_IN, sheet 1]

### Parts
INSTRUCTION  PINHD-1X8  [1X08]
LOAD_LINES  PINHD-1X2  [1X02]
POWER  PINHD-1X2  [1X02]
SELECT_LINES  PINHD-1X8  [1X08]
T-STATE  PINHD-1X8  [1X08]

### Module instances
3-TO-8_DECODER = 3-TO-8_DECODER
ALU_IN_DECODER = ALU_IN_DECODER

### Nets
GND: POWER.2 ; port ALU_IN_DECODER.GND
I1: INSTRUCTION.1 ; port ALU_IN_DECODER.I1
I2: INSTRUCTION.2 ; port ALU_IN_DECODER.I2
I3: INSTRUCTION.3 ; port ALU_IN_DECODER.I3
I4: INSTRUCTION.4 ; port ALU_IN_DECODER.I4
I5: INSTRUCTION.5 ; port ALU_IN_DECODER.I5
I6: INSTRUCTION.6 ; port 3-TO-8_DECODER.INPUT1
I7: INSTRUCTION.7 ; port 3-TO-8_DECODER.INPUT2
I8: INSTRUCTION.8 ; port 3-TO-8_DECODER.INPUT3
LOAD_A_FROM_DATABUS: LOAD_LINES.1 ; port ALU_IN_DECODER.A
LOAD_B_FROM_DATABUS: LOAD_LINES.2 ; port ALU_IN_DECODER.B
N$4: port 3-TO-8_DECODER.OUTPUT1 ALU_IN_DECODER.SOURCE1
N$5: port ALU_IN_DECODER.SOURCE2 3-TO-8_DECODER.OUTPUT2
N$6: port 3-TO-8_DECODER.OUTPUT3 ALU_IN_DECODER.SOURCE3
N$7: port ALU_IN_DECODER.SOURCE4 3-TO-8_DECODER.OUTPUT4
N$8: port 3-TO-8_DECODER.OUTPUT5 ALU_IN_DECODER.SOURCE5
N$9: port ALU_IN_DECODER.SOURCE6 3-TO-8_DECODER.OUTPUT6
N$10: port 3-TO-8_DECODER.OUTPUT7 ALU_IN_DECODER.SOURCE7
N$11: port ALU_IN_DECODER.SOURCE8 3-TO-8_DECODER.OUTPUT8
SELECT_D_TO_DATABUS: SELECT_LINES.8 ; port ALU_IN_DECODER.D
SELECT_E_TO_DATABUS: SELECT_LINES.7 ; port ALU_IN_DECODER.E
SELECT_F_TO_DATABUS: SELECT_LINES.6 ; port ALU_IN_DECODER.F
SELECT_G_TO_DATABUS: SELECT_LINES.5 ; port ALU_IN_DECODER.G
SELECT_H_TO_DATABUS: SELECT_LINES.4 ; port ALU_IN_DECODER.H
SELECT_XE_TO_DATABUS: SELECT_LINES.1 ; port ALU_IN_DECODER.XE
SELECT_XH_TO_DATABUS: SELECT_LINES.2 ; port ALU_IN_DECODER.XH
SELECT_XL_TO_DATABUS: SELECT_LINES.3 ; port ALU_IN_DECODER.XL
T1: T-STATE.1 ; port ALU_IN_DECODER.T1
T2: T-STATE.2 ; port ALU_IN_DECODER.T2
T3: T-STATE.3 ; port ALU_IN_DECODER.T3
T4: T-STATE.4 ; port ALU_IN_DECODER.T4
T5: T-STATE.5 ; port ALU_IN_DECODER.T5
T6: T-STATE.6 ; port ALU_IN_DECODER.T6
T7: T-STATE.7 ; port ALU_IN_DECODER.T7
T8: T-STATE.8 ; port ALU_IN_DECODER.T8
VCC: POWER.1 ; port ALU_IN_DECODER.VCC

### Library data of the parts
INSTRUCTION SELECT_LINES T-STATE = pinhead:PINHD-1X8: PIN HEADER
LOAD_LINES POWER = pinhead:PINHD-1X2: PIN HEADER

## Module ALU_OUT
Ports: I1(in) I2(in) I3(in) I4(in) I5(in) I6(in) I7(in) I8(in) T1(in) T2(in) T3(in) T4(in) T5(in) T6(in) T7(in) T8(in) VCC(in) GND(in) SELECT_C_TO_DATABUS(out) LOAD_D_FROM_DATABUS(out) LOAD_E_FROM_DATABUS(out) LOAD_F_FROM_DATABUS(out) LOAD_G_FROM_DATABUS(out) LOAD_H_FROM_DATABUS(out) LOAD_XL_FROM_DATABUS(out) LOAD_XH_FROM_DATABUS(out) LOAD_XE_FROM_DATABUS(out)
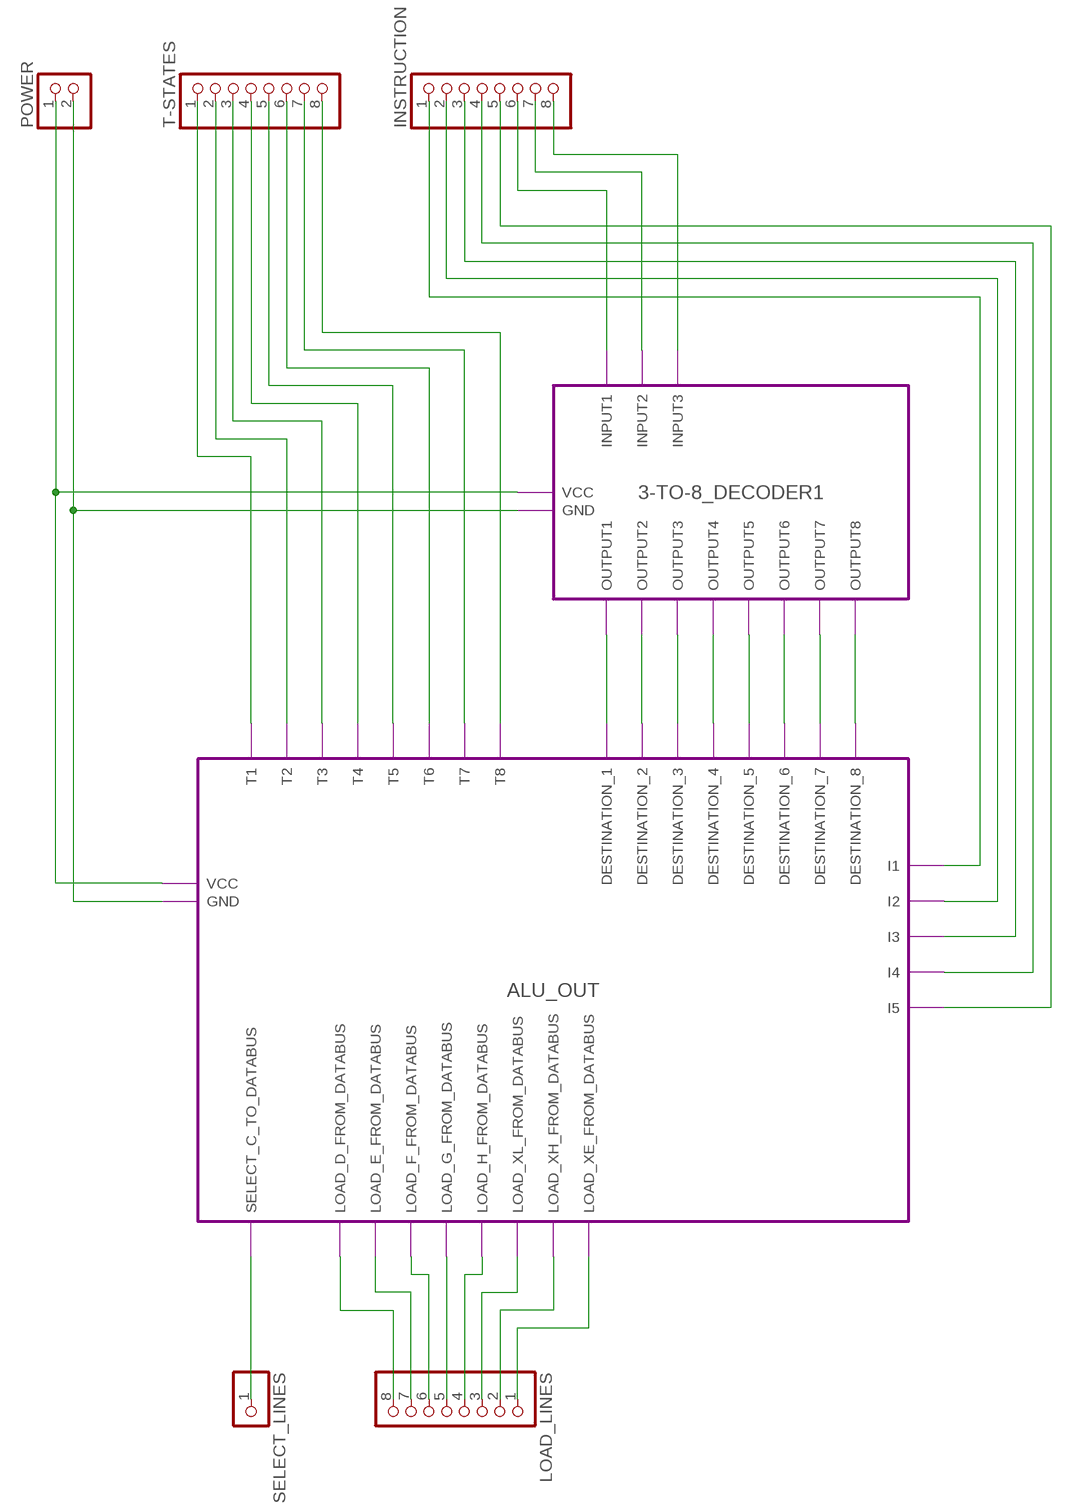
[diagram p51: schematic, module ALU_OUT, sheet 1]

### Parts
INSTRUCTION  PINHD-1X8  [1X08]
LOAD_LINES  PINHD-1X8  [1X08]
POWER  PINHD-1X2  [1X02]
SELECT_LINES  PINHD-1X1  [1X01]
T-STATES  PINHD-1X8  [1X08]

### Module instances
3-TO-8_DECODER1 = 3-TO-8_DECODER
ALU_OUT = ALU_OUT_DECODER

### Nets
GND: POWER.1 ; port ALU_OUT.VCC
I1: INSTRUCTION.1 ; port ALU_OUT.I1
I2: INSTRUCTION.2 ; port ALU_OUT.I2
I3: INSTRUCTION.3 ; port ALU_OUT.I3
I4: INSTRUCTION.4 ; port ALU_OUT.I4
I5: INSTRUCTION.5 ; port ALU_OUT.I5
I6: INSTRUCTION.6 ; port 3-TO-8_DECODER1.INPUT1
I7: INSTRUCTION.7 ; port 3-TO-8_DECODER1.INPUT2
I8: INSTRUCTION.8 ; port 3-TO-8_DECODER1.INPUT3
LOAD_D_FROM_DATABUS: LOAD_LINES.8 ; port ALU_OUT.LOAD_D_FROM_DATABUS
LOAD_E_FROM_DATABUS: LOAD_LINES.7 ; port ALU_OUT.LOAD_E_FROM_DATABUS
LOAD_F_FROM_DATABUS: LOAD_LINES.6 ; port ALU_OUT.LOAD_F_FROM_DATABUS
LOAD_G_FROM_DATABUS: LOAD_LINES.5 ; port ALU_OUT.LOAD_G_FROM_DATABUS
LOAD_H_FROM_DATABUS: LOAD_LINES.4 ; port ALU_OUT.LOAD_H_FROM_DATABUS
LOAD_XE_FROM_DATABUS: LOAD_LINES.1 ; port ALU_OUT.LOAD_XE_FROM_DATABUS
LOAD_XH_FROM_DATABUS: LOAD_LINES.2 ; port ALU_OUT.LOAD_XH_FROM_DATABUS
LOAD_XL_FROM_DATABUS: LOAD_LINES.3 ; port ALU_OUT.LOAD_XL_FROM_DATABUS
N$1: port 3-TO-8_DECODER1.OUTPUT1 ALU_OUT.DESTINATION_1
N$2: port ALU_OUT.DESTINATION_2 3-TO-8_DECODER1.OUTPUT2
N$3: port 3-TO-8_DECODER1.OUTPUT3 ALU_OUT.DESTINATION_3
N$4: port ALU_OUT.DESTINATION_4 3-TO-8_DECODER1.OUTPUT4
N$5: port 3-TO-8_DECODER1.OUTPUT5 ALU_OUT.DESTINATION_5
N$6: port ALU_OUT.DESTINATION_6 3-TO-8_DECODER1.OUTPUT6
N$7: port 3-TO-8_DECODER1.OUTPUT7 ALU_OUT.DESTINATION_7
N$8: port ALU_OUT.DESTINATION_8 3-TO-8_DECODER1.OUTPUT8
SELECT_C_TO_DATABUS: SELECT_LINES.1 ; port ALU_OUT.SELECT_C_TO_DATABUS
T1: T-STATES.1 ; port ALU_OUT.T1
T2: T-STATES.2 ; port ALU_OUT.T2
T3: T-STATES.3 ; port ALU_OUT.T3
T4: T-STATES.4 ; port ALU_OUT.T4
T5: T-STATES.5 ; port ALU_OUT.T5
T6: T-STATES.6 ; port ALU_OUT.T6
T7: T-STATES.7 ; port ALU_OUT.T7
T8: T-STATES.8 ; port ALU_OUT.T8
VCC: POWER.2 ; port ALU_OUT.GND

### Library data of the parts
INSTRUCTION LOAD_LINES T-STATES = pinhead:PINHD-1X8: PIN HEADER
POWER = pinhead:PINHD-1X2: PIN HEADER
SELECT_LINES = pinhead:PINHD-1X1: PIN HEADER

## Module LOAD
Ports: I1(in) I2(in) I3(in) I4(in) I5(in) I6(in) I7(in) I8(in) T1(in) T2(in) T3(in) T4(in) T5(in) T7(in) T6(in) T8(in) VCC(in) GND(in) SELECT_M_TO_ADDRESSBUS(out) SELECT_SRAM_LOAD(out) LOAD_D_FROM_DATABUS(out) LOAD_E_FROM_DATABUS(out) LOAD_F_FROM_DATABUS(out) LOAD_G_FROM_DATABUS(out) LOAD_H_FROM_DATABUS(out) LOAD_XL_FROM_DATABUS(out) LOAD_XH_FROM_DATABUS(out) LOAD_XE_FROM_DATABUS(out)
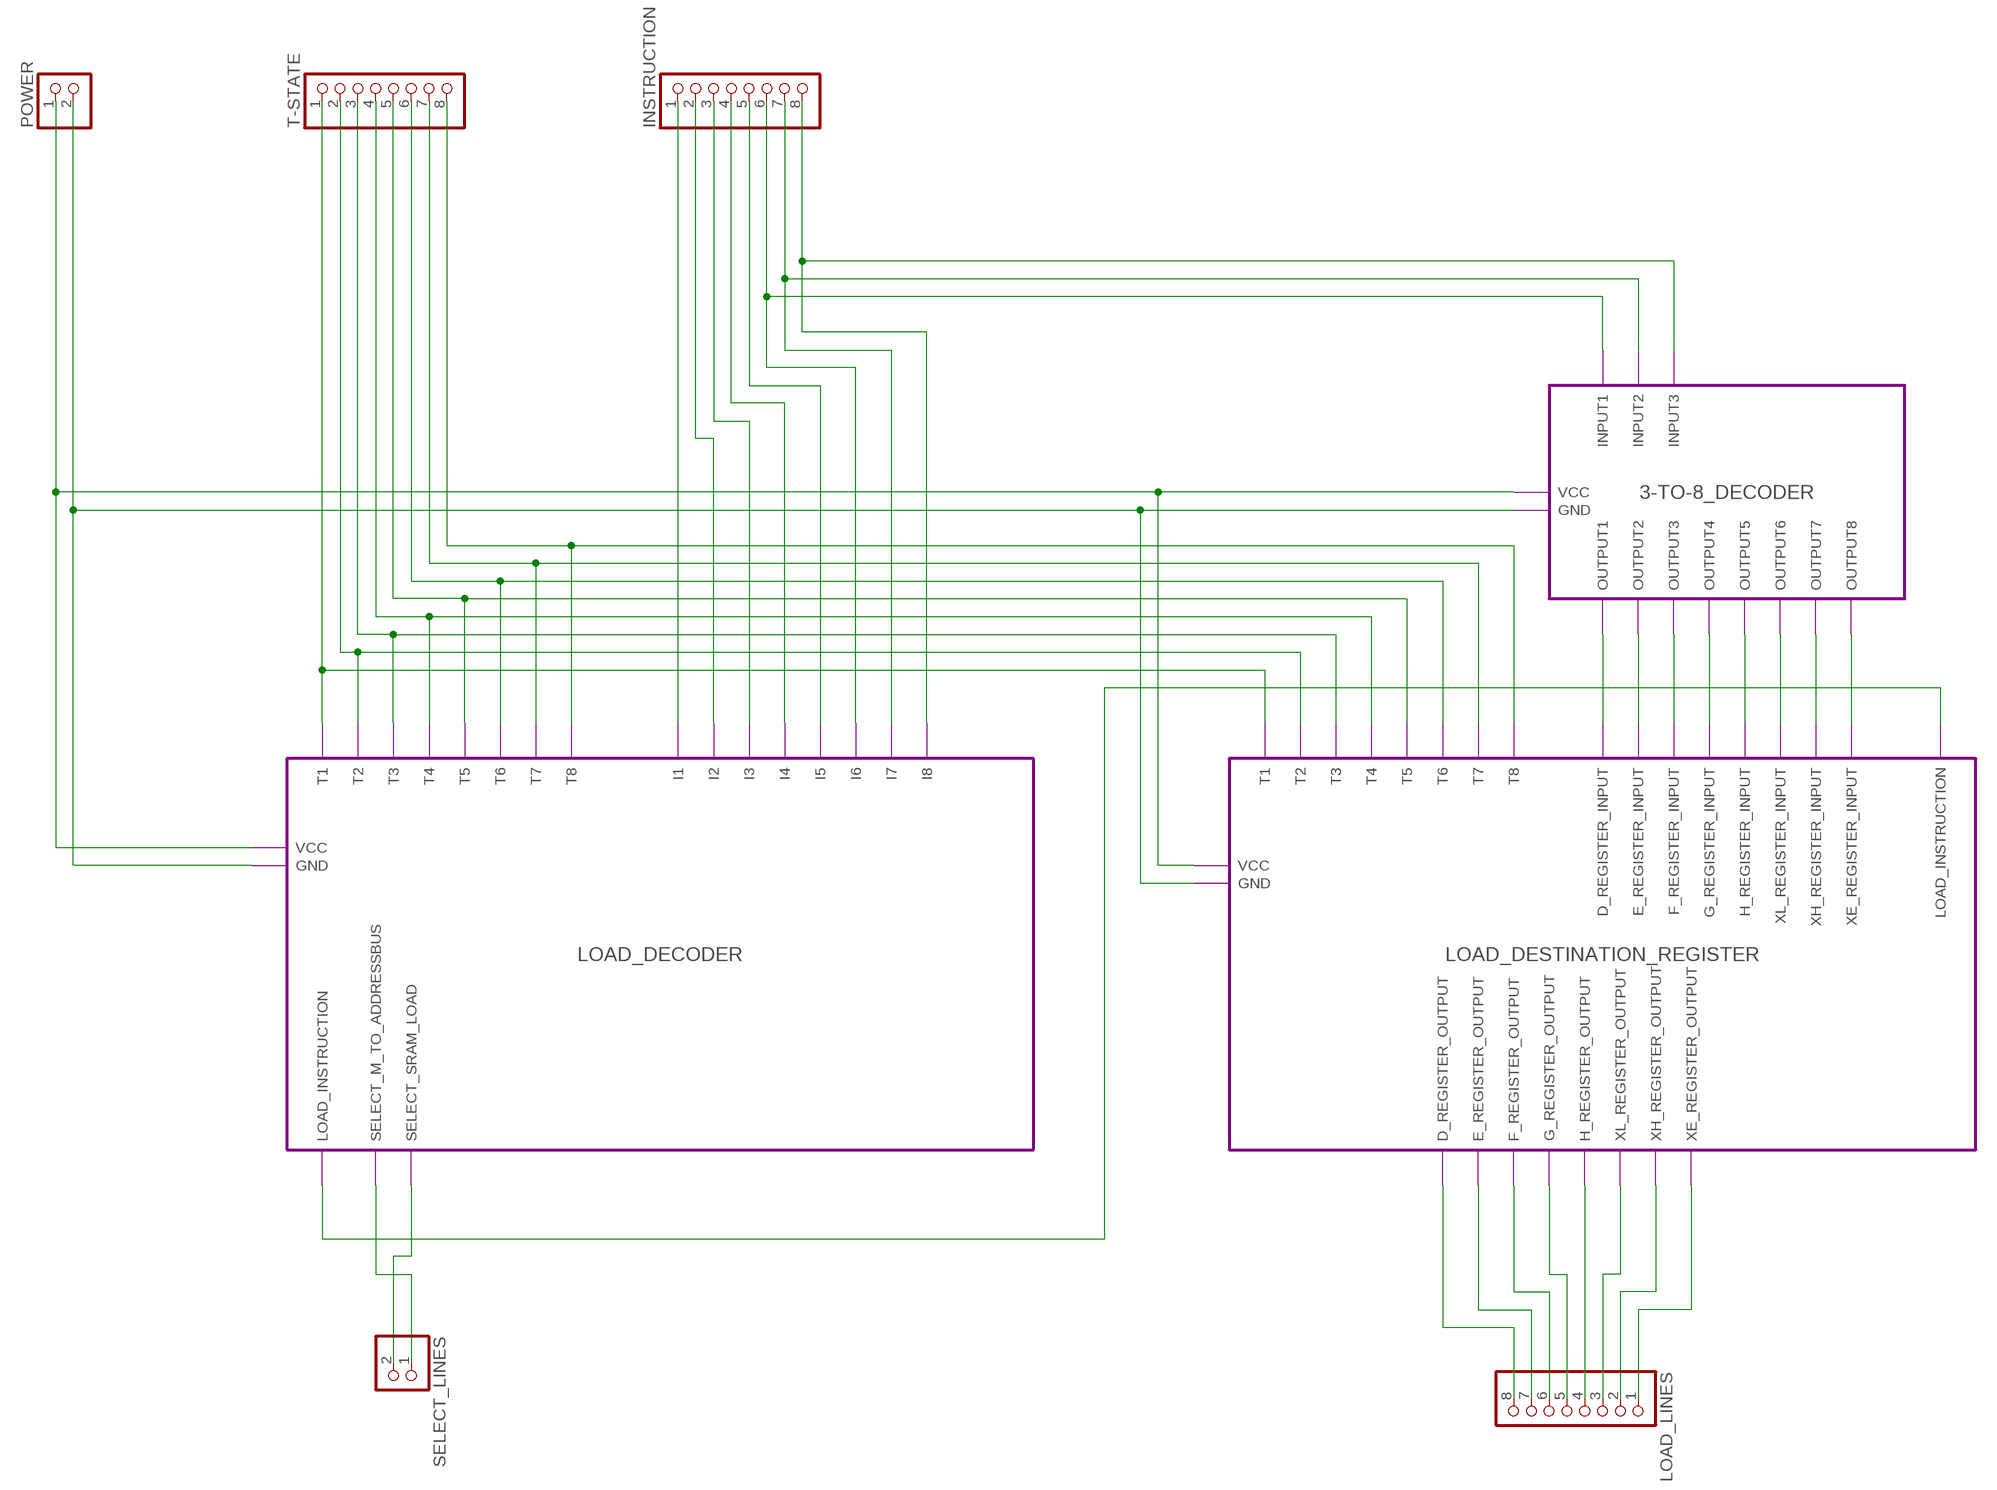
[diagram p52: schematic, module LOAD, sheet 1]

### Parts
INSTRUCTION  PINHD-1X8  [1X08]
LOAD_LINES  PINHD-1X8  [1X08]
POWER  PINHD-1X2  [1X02]
SELECT_LINES  PINHD-1X2  [1X02]
T-STATE  PINHD-1X8  [1X08]

### Module instances
3-TO-8_DECODER = 3-TO-8_DECODER
LOAD_DECODER = LOAD_DECODER
LOAD_DESTINATION_REGISTER = LOAD_DESTINATION_REGISTER

### Nets
GND: POWER.2 ; port LOAD_DECODER.GND LOAD_DESTINATION_REGISTER.GND
I1: INSTRUCTION.1 ; port LOAD_DECODER.I1
I2: INSTRUCTION.2 ; port LOAD_DECODER.I2
I3: INSTRUCTION.3 ; port LOAD_DECODER.I3
I4: INSTRUCTION.4 ; port LOAD_DECODER.I4
I5: INSTRUCTION.5 ; port LOAD_DECODER.I5
I6: INSTRUCTION.6 ; port 3-TO-8_DECODER.INPUT1 LOAD_DECODER.I6
I7: INSTRUCTION.7 ; port LOAD_DECODER.I7 3-TO-8_DECODER.INPUT2
I8: INSTRUCTION.8 ; port 3-TO-8_DECODER.INPUT3 LOAD_DECODER.I8
LOAD_D_FROM_DATABUS: LOAD_LINES.8 ; port LOAD_DESTINATION_REGISTER.D_REGISTER_OUTPUT
LOAD_E_FROM_DATABUS: LOAD_LINES.7 ; port LOAD_DESTINATION_REGISTER.E_REGISTER_OUTPUT
LOAD_F_FROM_DATABUS: LOAD_LINES.6 ; port LOAD_DESTINATION_REGISTER.F_REGISTER_OUTPUT
LOAD_G_FROM_DATABUS: LOAD_LINES.5 ; port LOAD_DESTINATION_REGISTER.G_REGISTER_OUTPUT
LOAD_H_FROM_DATABUS: LOAD_LINES.4 ; port LOAD_DESTINATION_REGISTER.H_REGISTER_OUTPUT
LOAD_XE_FROM_DATABUS: LOAD_LINES.1 ; port LOAD_DESTINATION_REGISTER.XE_REGISTER_OUTPUT
LOAD_XH_FROM_DATABUS: LOAD_LINES.2 ; port LOAD_DESTINATION_REGISTER.XH_REGISTER_OUTPUT
LOAD_XL_FROM_DATABUS: LOAD_LINES.3 ; port LOAD_DESTINATION_REGISTER.XL_REGISTER_OUTPUT
N$14: port LOAD_DECODER.LOAD_INSTRUCTION LOAD_DESTINATION_REGISTER.LOAD_INSTRUCTION
N$17: port 3-TO-8_DECODER.OUTPUT1 LOAD_DESTINATION_REGISTER.D_REGISTER_INPUT
N$18: port 3-TO-8_DECODER.OUTPUT2 LOAD_DESTINATION_REGISTER.E_REGISTER_INPUT
N$19: port 3-TO-8_DECODER.OUTPUT3 LOAD_DESTINATION_REGISTER.F_REGISTER_INPUT
N$20: port 3-TO-8_DECODER.OUTPUT4 LOAD_DESTINATION_REGISTER.G_REGISTER_INPUT
N$21: port 3-TO-8_DECODER.OUTPUT5 LOAD_DESTINATION_REGISTER.H_REGISTER_INPUT
N$22: port 3-TO-8_DECODER.OUTPUT6 LOAD_DESTINATION_REGISTER.XL_REGISTER_INPUT
N$23: port 3-TO-8_DECODER.OUTPUT7 LOAD_DESTINATION_REGISTER.XH_REGISTER_INPUT
N$24: port 3-TO-8_DECODER.OUTPUT8 LOAD_DESTINATION_REGISTER.XE_REGISTER_INPUT
SELECT_M_TO_ADDRESSBUS: SELECT_LINES.1 ; port LOAD_DECODER.SELECT_M_TO_ADDRESSBUS
SELECT_SRAM_LOAD: SELECT_LINES.2 ; port LOAD_DECODER.SELECT_SRAM_LOAD
T1: T-STATE.1 ; port LOAD_DECODER.T1 LOAD_DESTINATION_REGISTER.T1
T2: T-STATE.2 ; port LOAD_DECODER.T2 LOAD_DESTINATION_REGISTER.T2
T3: T-STATE.3 ; port LOAD_DECODER.T3 LOAD_DESTINATION_REGISTER.T3
T4: T-STATE.4 ; port LOAD_DECODER.T4 LOAD_DESTINATION_REGISTER.T4
T5: T-STATE.5 ; port LOAD_DECODER.T5 LOAD_DESTINATION_REGISTER.T5
T6: T-STATE.6 ; port LOAD_DECODER.T6 LOAD_DESTINATION_REGISTER.T6
T7: T-STATE.7 ; port LOAD_DECODER.T7 LOAD_DESTINATION_REGISTER.T7
T8: T-STATE.8 ; port LOAD_DECODER.T8 LOAD_DESTINATION_REGISTER.T8
VCC: POWER.1 ; port LOAD_DECODER.VCC LOAD_DESTINATION_REGISTER.VCC

### Library data of the parts
INSTRUCTION LOAD_LINES T-STATE = pinhead:PINHD-1X8: PIN HEADER
POWER SELECT_LINES = pinhead:PINHD-1X2: PIN HEADER

## Module STORE_SOURCE_REGISTER
Ports: D_REGISTER_INPUT(in) E_REGISTER_INPUT(in) F_REGISTER_INPUT(in) G_REGISTER_INPUT(in) H_REGISTER_INPUT(in) XL_REGISTER_INPUT(in) XH_REGISTER_INPUT(in) XE_REGISTER_INPUT(in) T1(in) T2(in) T3(in) T4(in) T5(in) T6(in) T7(in) T8(in) VCC(in) GND(in) D_REGISTER_OUTPUT(out) E_REGISTER_OUTPUT(out) F_REGISTER_OUTPUT(out) G_REGISTER_OUTPUT(out) H_REGISTER_OUTPUT(out) XL_REGISTER_OUTPUT(out) XH_REGISTER_OUTPUT(out) XE_REGISTER_OUTPUT(out) INSTRUCTION_STORE(in)
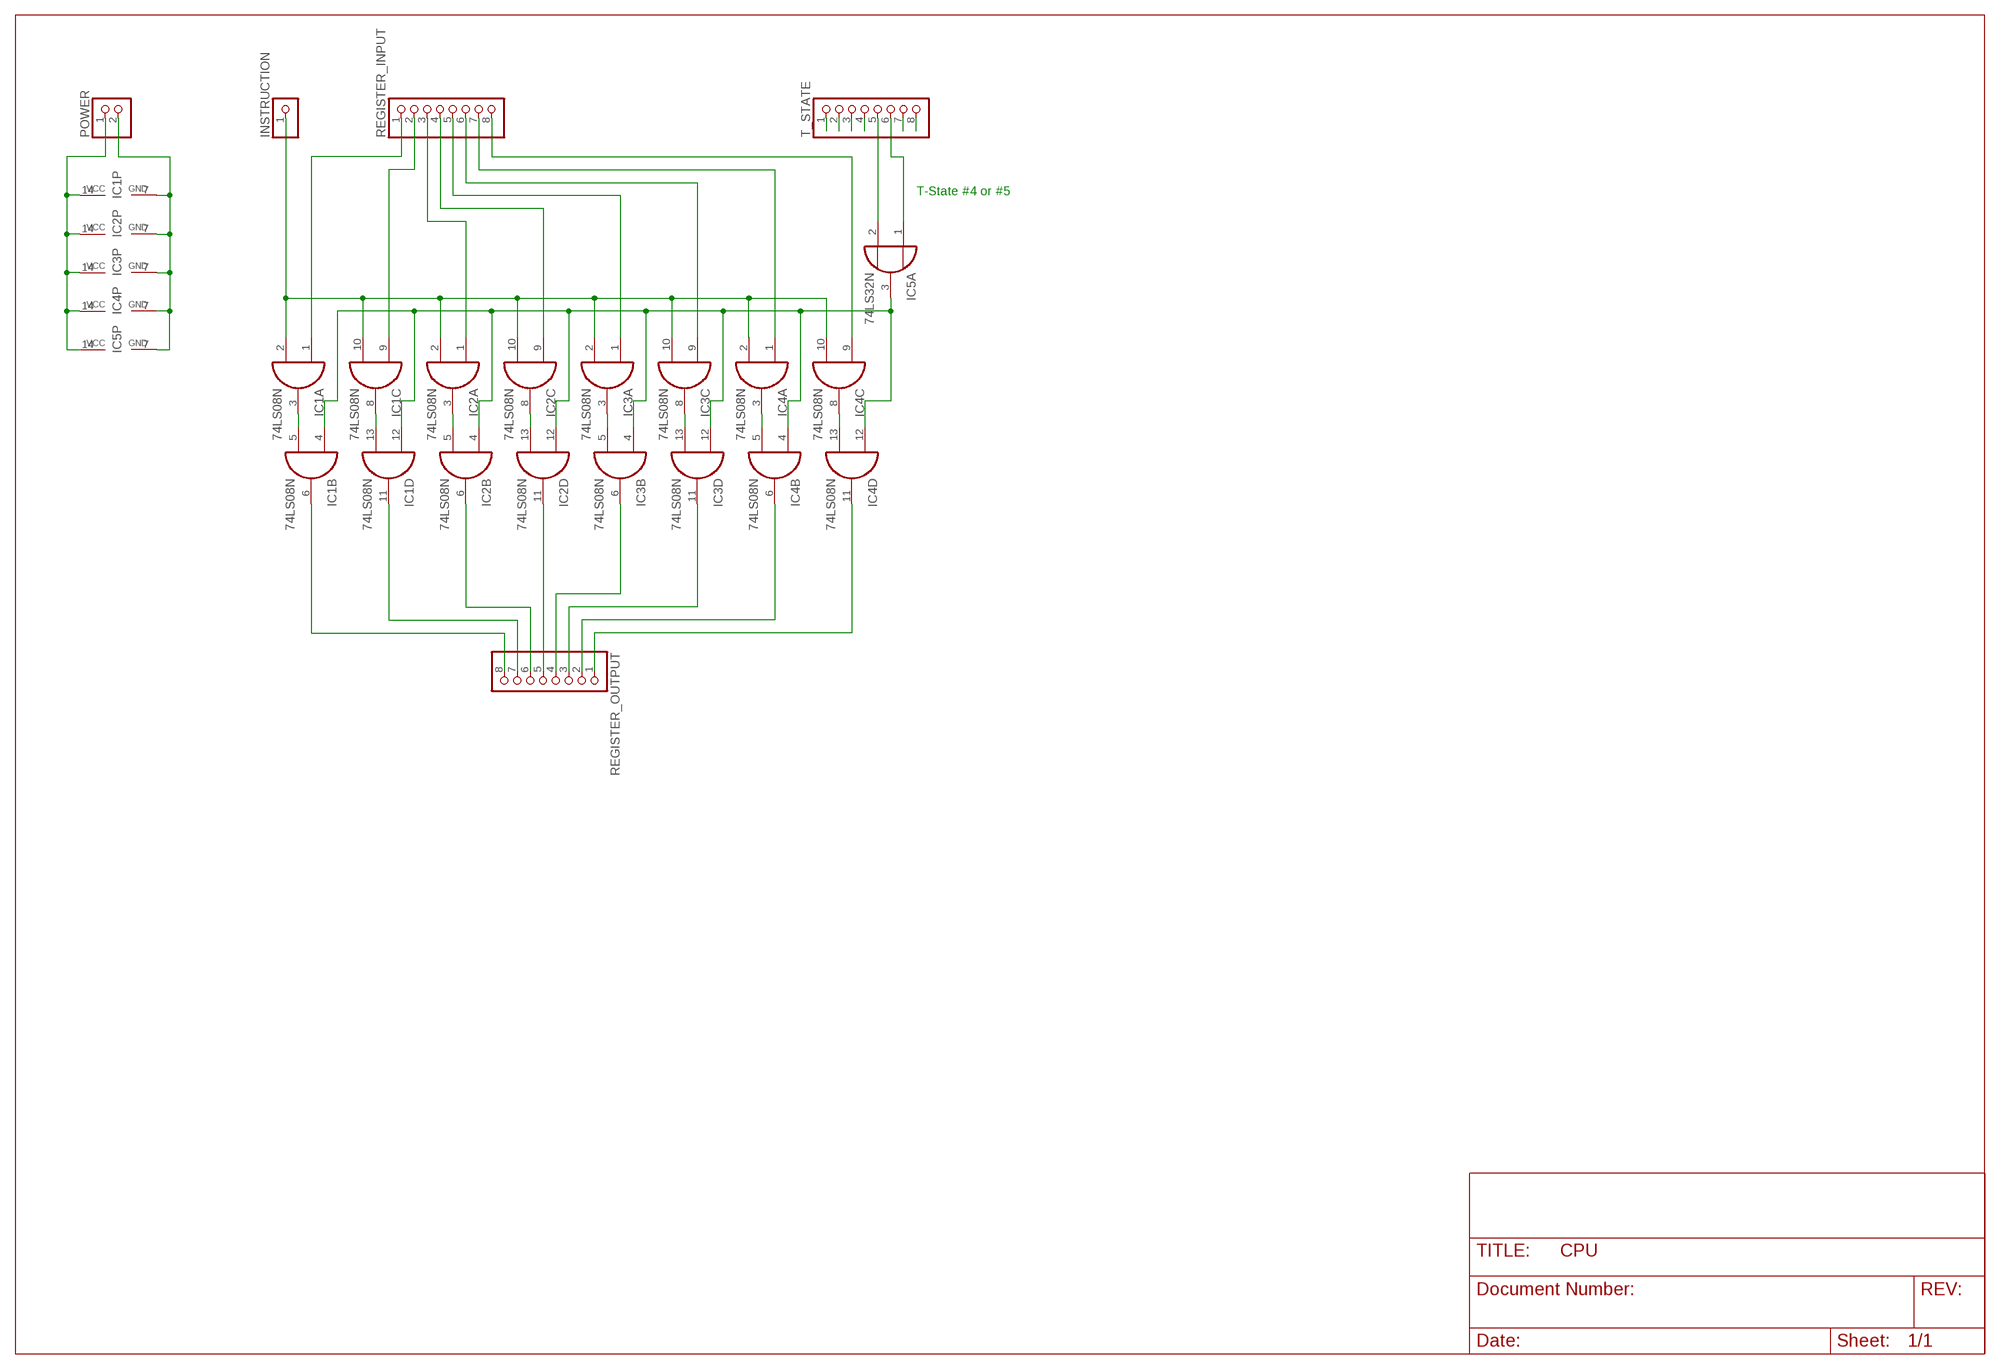
[diagram p53: schematic, module STORE_SOURCE_REGISTER, sheet 1]

### Parts
IC1  74LS08N  [DIL14]
IC2  74LS08N  [DIL14]
IC3  74LS08N  [DIL14]
IC4  74LS08N  [DIL14]
IC5  74LS32N  [DIL14]
INSTRUCTION  PINHD-1X1  [1X01]
POWER  PINHD-1X2  [1X02]
REGISTER_INPUT  PINHD-1X8  [1X08]
REGISTER_OUTPUT  PINHD-1X8  [1X08]
T_STATE  PINHD-1X8  [1X08]

### Nets
D_REGISTER_INPUT: IC1.1(A:I0) REGISTER_INPUT.1
D_REGISTER_OUTPUT: IC1.6(B:O) REGISTER_OUTPUT.8
E_REGISTER_INPUT: IC1.9(C:I0) REGISTER_INPUT.2
E_REGISTER_OUTPUT: IC1.11(D:O) REGISTER_OUTPUT.7
F_REGISTER_INPUT: IC2.1(A:I0) REGISTER_INPUT.3
F_REGISTER_OUTPUT: IC2.6(B:O) REGISTER_OUTPUT.6
G_REGISTER_INPUT: IC2.9(C:I0) REGISTER_INPUT.4
G_REGISTER_OUTPUT: IC2.11(D:O) REGISTER_OUTPUT.5
GND: IC1.7(P:GND) IC2.7(P:GND) IC3.7(P:GND) IC4.7(P:GND) IC5.7(P:GND) POWER.2
H_REGISTER_INPUT: IC3.1(A:I0) REGISTER_INPUT.5
H_REGISTER_OUTPUT: IC3.6(B:O) REGISTER_OUTPUT.4
INSTRUCTION_STORE: IC1.2(A:I1) IC1.10(C:I1) IC2.2(A:I1) IC2.10(C:I1) IC3.2(A:I1) IC3.10(C:I1) IC4.2(A:I1) IC4.10(C:I1) INSTRUCTION.1
N$3: IC1.3(A:O) IC1.5(B:I1)
N$6: IC1.8(C:O) IC1.13(D:I1)
N$8: IC2.3(A:O) IC2.5(B:I1)
N$10: IC2.8(C:O) IC2.13(D:I1)
N$12: IC3.3(A:O) IC3.5(B:I1)
N$14: IC3.8(C:O) IC3.13(D:I1)
N$16: IC4.3(A:O) IC4.5(B:I1)
N$17: IC1.4(B:I0) IC1.12(D:I0) IC2.4(B:I0) IC2.12(D:I0) IC3.4(B:I0) IC3.12(D:I0) IC4.4(B:I0) IC4.12(D:I0) IC5.3(A:O)
N$18: IC4.8(C:O) IC4.13(D:I1)
T1: T_STATE.1
T2: T_STATE.2
T3: T_STATE.3
T4: T_STATE.4
T5: IC5.2(A:I1) T_STATE.5
T6: IC5.1(A:I0) T_STATE.6
T7: T_STATE.7
T8: T_STATE.8
VCC: IC1.14(P:VCC) IC2.14(P:VCC) IC3.14(P:VCC) IC4.14(P:VCC) IC5.14(P:VCC) POWER.1
XE_REGISTER_INPUT: IC4.9(C:I0) REGISTER_INPUT.8
XE_REGISTER_OUTPUT: IC4.11(D:O) REGISTER_OUTPUT.1
XH_REGISTER_INPUT: IC4.1(A:I0) REGISTER_INPUT.7
XH_REGISTER_OUTPUT: IC4.6(B:O) REGISTER_OUTPUT.2
XL_REGISTER_INPUT: IC3.9(C:I0) REGISTER_INPUT.6
XL_REGISTER_OUTPUT: IC3.11(D:O) REGISTER_OUTPUT.3
Unconnected: IC5.4(B:I0) IC5.5(B:I1) IC5.6(B:O) IC5.8(C:O) IC5.9(C:I0) IC5.10(C:I1) IC5.11(D:O) IC5.12(D:I0) IC5.13(D:I1)

### Notes on the sheet
- T-State #4 or #5

### Library data of the parts
IC1-IC4 = 74xx-eu:74*08: Quad 2-input AND gate
IC5 = 74xx-eu:74*32: Quad 2-input OR gate
INSTRUCTION = pinhead:PINHD-1X1: PIN HEADER
POWER = pinhead:PINHD-1X2: PIN HEADER
REGISTER_INPUT REGISTER_OUTPUT T_STATE = pinhead:PINHD-1X8: PIN HEADER

## Module STORE_DECODER
Ports: I1(in) I2(in) I3(in) I4(in) I5(in) I6(in) I7(in) I8(in) T1(in) T2(in) T3(in) T4(in) T5(in) T6(in) T7(in) T8(in) VCC(in) GND(in) INSTRUCTION_STORE(out) SELECT_M_TO_ADDRESSBUS(out) SELECT_SRAM_STORE(out)
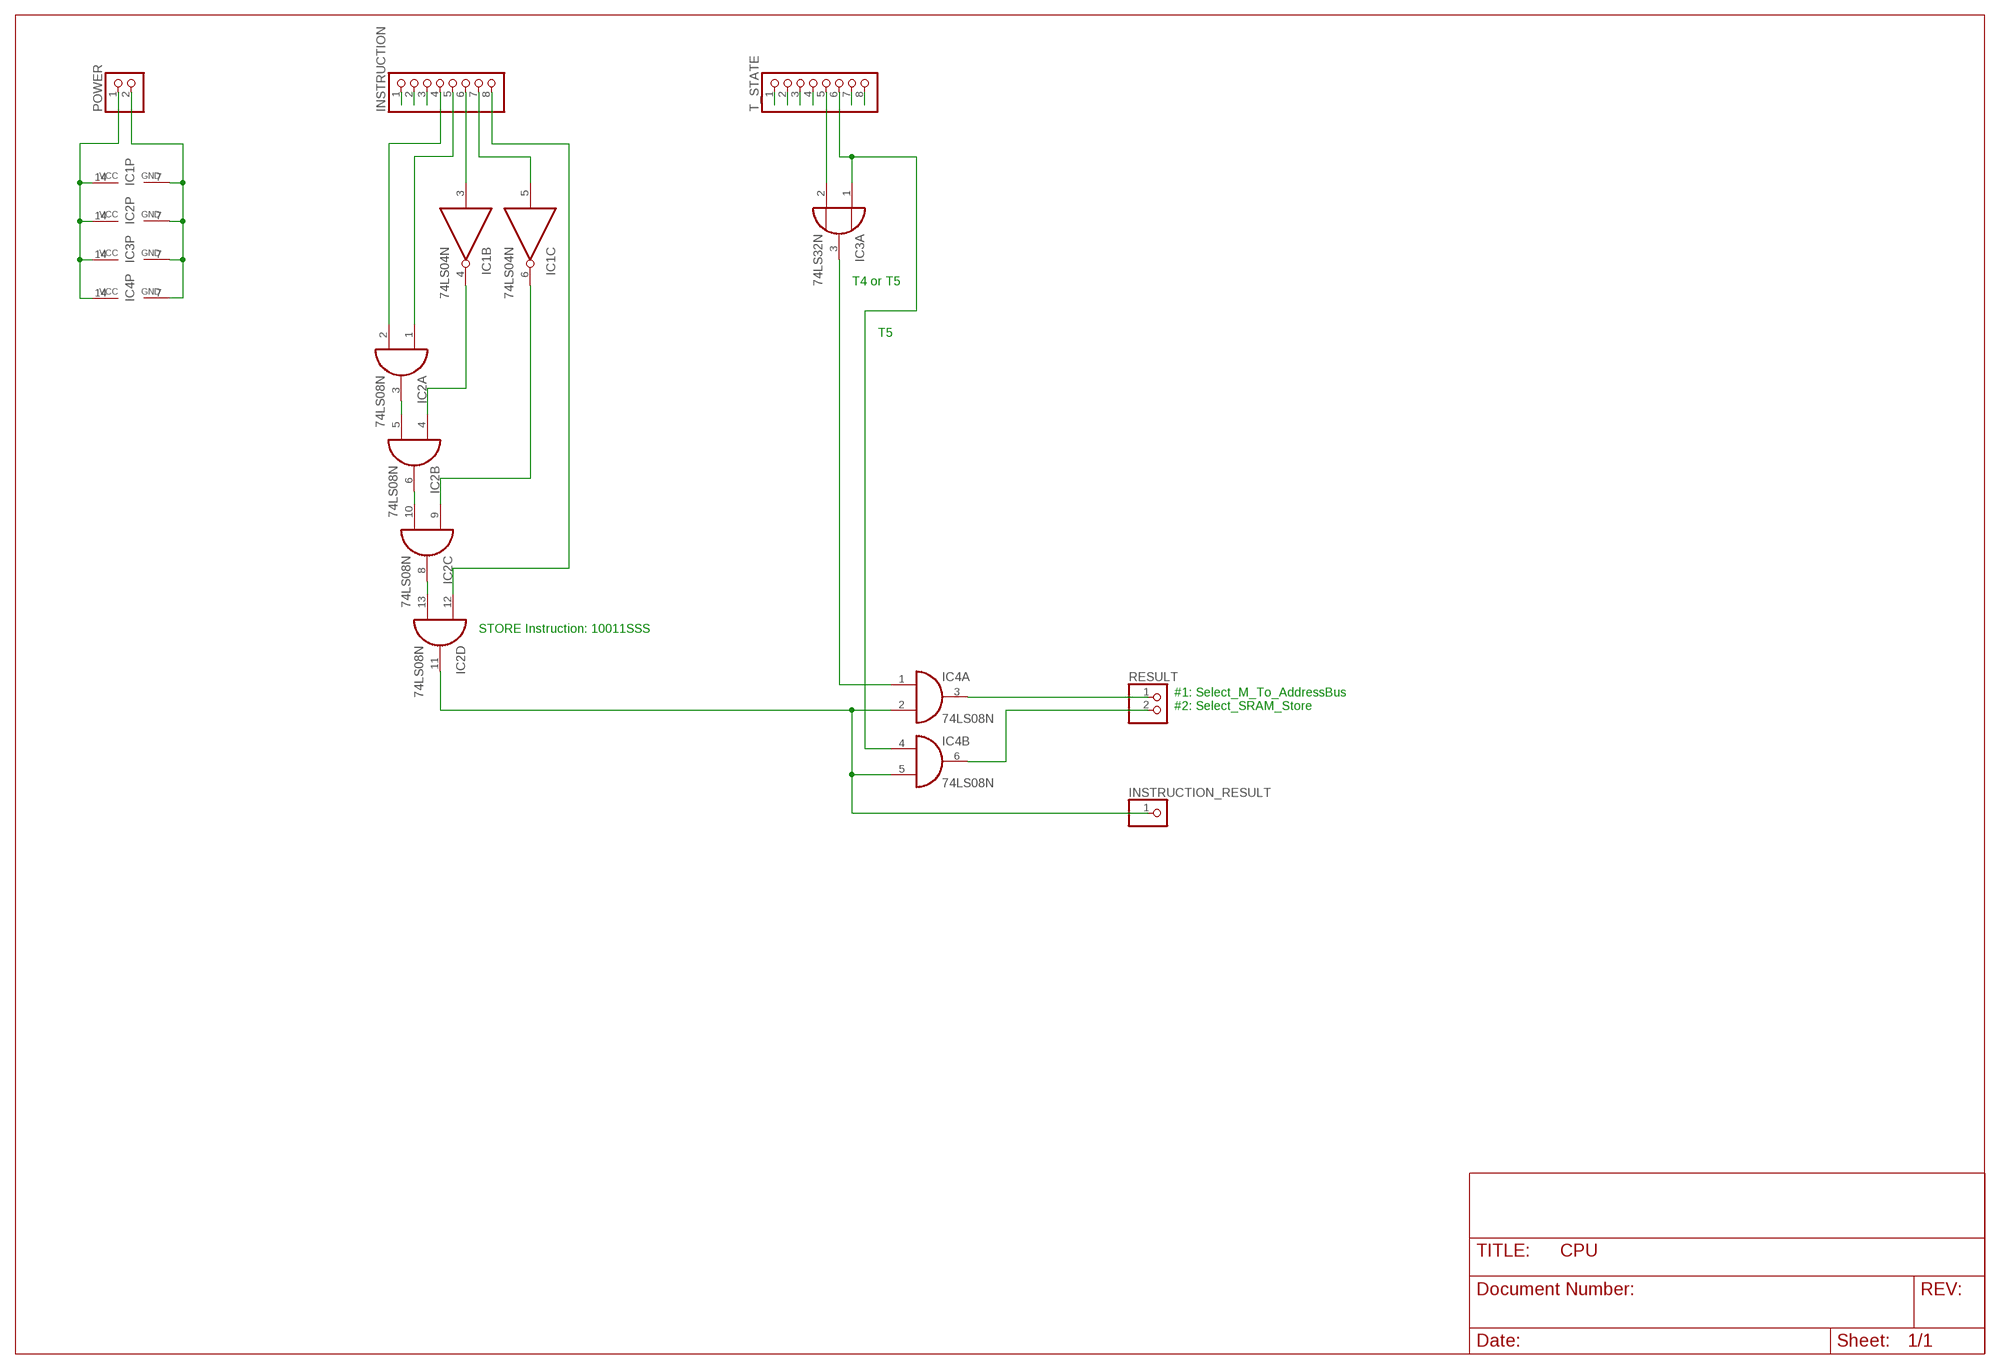
[diagram p54: schematic, module STORE_DECODER, sheet 1]

### Parts
IC1  74LS04N  [DIL14]
IC2  74LS08N  [DIL14]
IC3  74LS32N  [DIL14]
IC4  74LS08N  [DIL14]
INSTRUCTION  PINHD-1X8  [1X08]
INSTRUCTION_RESULT  PINHD-1X1  [1X01]
POWER  PINHD-1X2  [1X02]
RESULT  PINHD-1X2  [1X02]
T_STATE  PINHD-1X8  [1X08]

### Nets
GND: IC1.7(P:GND) IC2.7(P:GND) IC3.7(P:GND) IC4.7(P:GND) POWER.2
I1: INSTRUCTION.1
I2: INSTRUCTION.2
I3: INSTRUCTION.3
I4: IC2.2(A:I1) INSTRUCTION.4
I5: IC2.1(A:I0) INSTRUCTION.5
I6: IC1.3(B:I) INSTRUCTION.6
I7: IC1.5(C:I) INSTRUCTION.7
I8: IC2.12(D:I0) INSTRUCTION.8
INSTRUCTION_STORE: IC2.11(D:O) IC4.2(A:I1) IC4.5(B:I1) INSTRUCTION_RESULT.1
N$6: IC2.3(A:O) IC2.5(B:I1)
N$7: IC1.4(B:O) IC2.4(B:I0)
N$8: IC2.6(B:O) IC2.10(C:I1)
N$9: IC1.6(C:O) IC2.9(C:I0)
N$10: IC2.8(C:O) IC2.13(D:I1)
N$17: IC3.3(A:O) IC4.1(A:I0)
SELECT_M_TO_ADDRESSBUS: IC4.3(A:O) RESULT.1
SELECT_SRAM_STORE: IC4.6(B:O) RESULT.2
T1: T_STATE.1
T2: T_STATE.2
T3: T_STATE.3
T4: T_STATE.4
T5: IC3.2(A:I1) T_STATE.5
T6: IC3.1(A:I0) IC4.4(B:I0) T_STATE.6
T7: T_STATE.7
T8: T_STATE.8
VCC: IC1.14(P:VCC) IC2.14(P:VCC) IC3.14(P:VCC) IC4.14(P:VCC) POWER.1
Unconnected: IC1.1(A:I) IC1.2(A:O) IC1.8(D:O) IC1.9(D:I) IC1.10(E:O) IC1.11(E:I) IC1.12(F:O) IC1.13(F:I) IC3.4(B:I0) IC3.5(B:I1) IC3.6(B:O) IC3.8(C:O) IC3.9(C:I0) IC3.10(C:I1) IC3.11(D:O) IC3.12(D:I0) IC3.13(D:I1) IC4.8(C:O) IC4.9(C:I0) IC4.10(C:I1) IC4.11(D:O) IC4.12(D:I0) IC4.13(D:I1)

### Notes on the sheet
- T4 or T5
- T5
- STORE Instruction: 10011SSS
- #1: Select_M_To_AddressBus
  #2: Select_SRAM_Store

### Library data of the parts
IC1 = 74xx-eu:74*04: Hex INVERTER
IC2 IC4 = 74xx-eu:74*08: Quad 2-input AND gate
IC3 = 74xx-eu:74*32: Quad 2-input OR gate
INSTRUCTION T_STATE = pinhead:PINHD-1X8: PIN HEADER
INSTRUCTION_RESULT = pinhead:PINHD-1X1: PIN HEADER
POWER RESULT = pinhead:PINHD-1X2: PIN HEADER

## Module STORE
Ports: I1(in) I2(in) I3(in) I4(in) I5(in) I6(in) I7(in) I8(in) T1(in) T2(in) T3(in) T4(in) T5(in) T6(in) T7(in) T8(in) VCC(in) GND(in) SELECT_M_TO_ADDRESSBUS(out) SELECT_SRAM_STORE(out) SELECT_D_TO_DATABUS(out) SELECT_E_TO_DATABUS(out) SELECT_F_TO_DATABUS(out) SELECT_G_TO_DATABUS(out) SELECT_H_TO_DATABUS(out) SELECT_XL_TO_DATABUS(out) SELECT_XH_TO_DATABUS(out) SELECT_XE_TO_DATABUS(out)
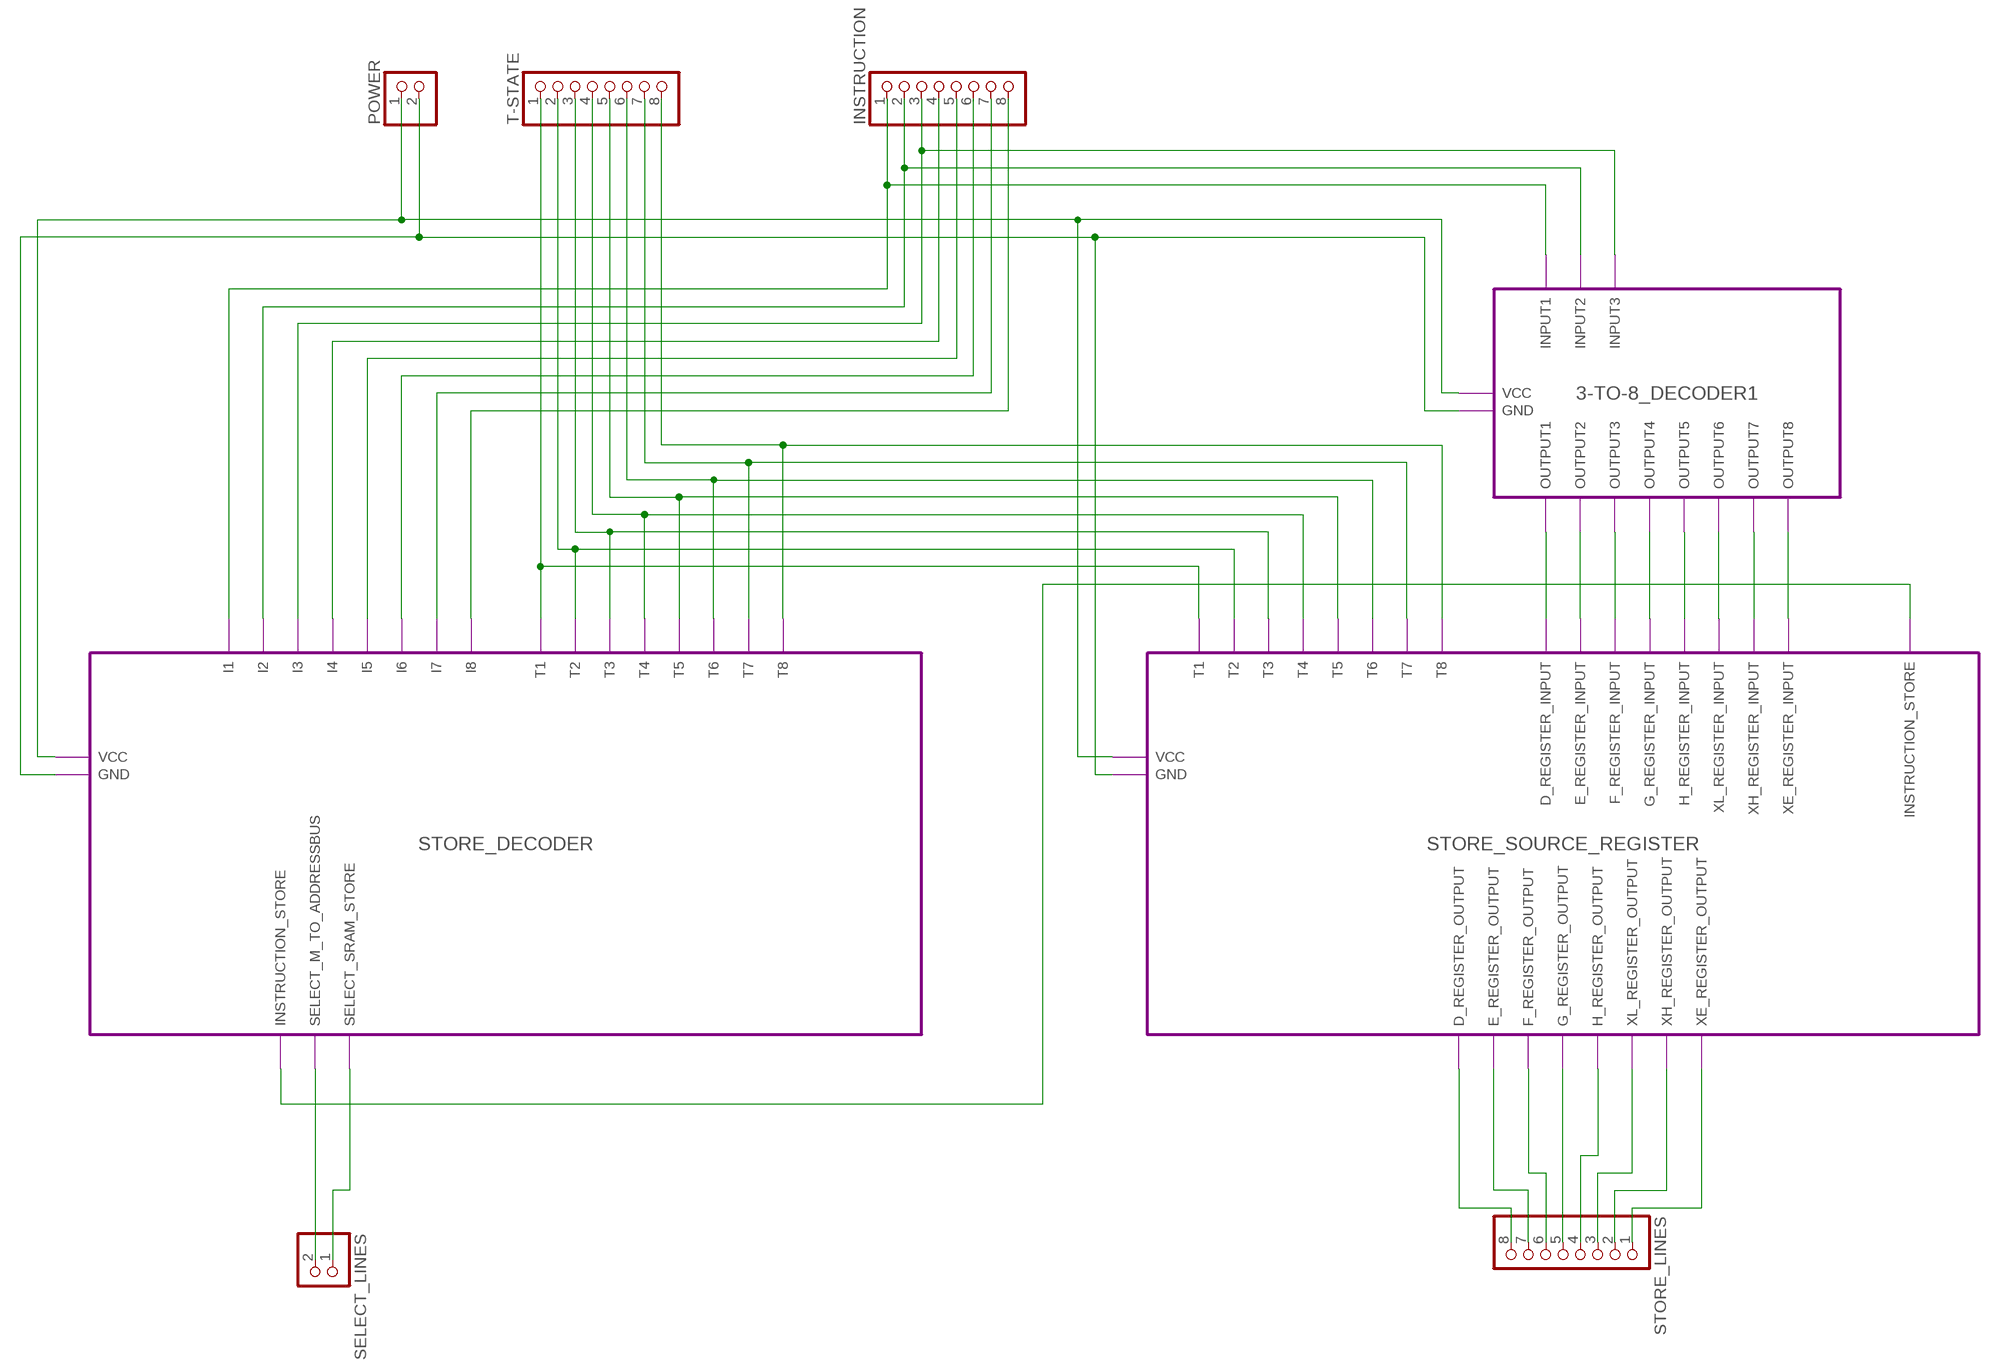
[diagram p55: schematic, module STORE, sheet 1]

### Parts
INSTRUCTION  PINHD-1X8  [1X08]
POWER  PINHD-1X2  [1X02]
SELECT_LINES  PINHD-1X2  [1X02]
STORE_LINES  PINHD-1X8  [1X08]
T-STATE  PINHD-1X8  [1X08]

### Module instances
3-TO-8_DECODER1 = 3-TO-8_DECODER
STORE_SOURCE_REGISTER = STORE_SOURCE_REGISTER
STORE_DECODER = STORE_DECODER

### Nets
GND: POWER.2 ; port 3-TO-8_DECODER1.GND STORE_SOURCE_REGISTER.GND STORE_DECODER.GND
I1: INSTRUCTION.1 ; port STORE_DECODER.I1 3-TO-8_DECODER1.INPUT1
I2: INSTRUCTION.2 ; port STORE_DECODER.I2 3-TO-8_DECODER1.INPUT2
I3: INSTRUCTION.3 ; port STORE_DECODER.I3 3-TO-8_DECODER1.INPUT3
I4: INSTRUCTION.4 ; port STORE_DECODER.I4
I5: INSTRUCTION.5 ; port STORE_DECODER.I5
I6: INSTRUCTION.6 ; port STORE_DECODER.I6
I7: INSTRUCTION.7 ; port STORE_DECODER.I7
I8: INSTRUCTION.8 ; port STORE_DECODER.I8
N$1: port 3-TO-8_DECODER1.OUTPUT1 STORE_SOURCE_REGISTER.D_REGISTER_INPUT
N$2: port STORE_SOURCE_REGISTER.E_REGISTER_INPUT 3-TO-8_DECODER1.OUTPUT2
N$3: port 3-TO-8_DECODER1.OUTPUT3 STORE_SOURCE_REGISTER.F_REGISTER_INPUT
N$4: port STORE_SOURCE_REGISTER.G_REGISTER_INPUT 3-TO-8_DECODER1.OUTPUT4
N$5: port 3-TO-8_DECODER1.OUTPUT5 STORE_SOURCE_REGISTER.H_REGISTER_INPUT
N$6: port STORE_SOURCE_REGISTER.XL_REGISTER_INPUT 3-TO-8_DECODER1.OUTPUT6
N$7: port 3-TO-8_DECODER1.OUTPUT7 STORE_SOURCE_REGISTER.XH_REGISTER_INPUT
N$8: port STORE_SOURCE_REGISTER.XE_REGISTER_INPUT 3-TO-8_DECODER1.OUTPUT8
N$9: port STORE_DECODER.INSTRUCTION_STORE STORE_SOURCE_REGISTER.INSTRUCTION_STORE
SELECT_D_TO_DATABUS: STORE_LINES.8 ; port STORE_SOURCE_REGISTER.D_REGISTER_OUTPUT
SELECT_E_TO_DATABUS: STORE_LINES.7 ; port STORE_SOURCE_REGISTER.E_REGISTER_OUTPUT
SELECT_F_TO_DATABUS: STORE_LINES.6 ; port STORE_SOURCE_REGISTER.F_REGISTER_OUTPUT
SELECT_G_TO_DATABUS: STORE_LINES.5 ; port STORE_SOURCE_REGISTER.G_REGISTER_OUTPUT
SELECT_H_TO_DATABUS: STORE_LINES.4 ; port STORE_SOURCE_REGISTER.H_REGISTER_OUTPUT
SELECT_M_TO_ADDRESSBUS: SELECT_LINES.2 ; port STORE_DECODER.SELECT_M_TO_ADDRESSBUS
SELECT_SRAM_STORE: SELECT_LINES.1 ; port STORE_DECODER.SELECT_SRAM_STORE
SELECT_XE_TO_DATABUS: STORE_LINES.1 ; port STORE_SOURCE_REGISTER.XE_REGISTER_OUTPUT
SELECT_XH_TO_DATABUS: STORE_LINES.2 ; port STORE_SOURCE_REGISTER.XH_REGISTER_OUTPUT
SELECT_XL_TO_DATABUS: STORE_LINES.3 ; port STORE_SOURCE_REGISTER.XL_REGISTER_OUTPUT
T1: T-STATE.1 ; port STORE_DECODER.T1 STORE_SOURCE_REGISTER.T1
T2: T-STATE.2 ; port STORE_DECODER.T2 STORE_SOURCE_REGISTER.T2
T3: T-STATE.3 ; port STORE_DECODER.T3 STORE_SOURCE_REGISTER.T3
T4: T-STATE.4 ; port STORE_DECODER.T4 STORE_SOURCE_REGISTER.T4
T5: T-STATE.5 ; port STORE_DECODER.T5 STORE_SOURCE_REGISTER.T5
T6: T-STATE.6 ; port STORE_DECODER.T6 STORE_SOURCE_REGISTER.T6
T7: T-STATE.7 ; port STORE_SOURCE_REGISTER.T7 STORE_DECODER.T7
T8: T-STATE.8 ; port STORE_DECODER.T8 STORE_SOURCE_REGISTER.T8
VCC: POWER.1 ; port 3-TO-8_DECODER1.VCC STORE_SOURCE_REGISTER.VCC STORE_DECODER.VCC

### Library data of the parts
INSTRUCTION STORE_LINES T-STATE = pinhead:PINHD-1X8: PIN HEADER
POWER SELECT_LINES = pinhead:PINHD-1X2: PIN HEADER

## Module MOV16_SOURE_REGISTER
Ports: T1(in) T2(in) T3(in) T4(in) T5(in) T6(in) T7(in) T8(in) SOURCE_REGISTER_INPUT_M(in) SOURCE_REGISTER_INPUT_X(in) SOURCE_REGISTER_INPUT_J(in) SOURCE_REGISTER_INPUT_SP(in) SOURCE_REGISTER_INPUT_5(in) SOURCE_REGISTER_INPUT_BP(in) SOURCE_REGISTER_INPUT_Y(in) SOURCE_REGISTER_INPUT_Z(in) MOV16_INSTRUCTION(in) SOURCE_REGISTER_OUTPUT_M(out) SOURCE_REGISTER_OUTPUT_X(out) SOURCE_REGISTER_OUTPUT_J(out) SOURCE_REGISTER_OUTPUT_SP(out) SOURCE_REGISTER_OUTPUT_5(out) SOURCE_REGISTER_OUTPUT_BP(out) SOURCE_REGISTER_OUTPUT_Y(out) SOURCE_REGISTER_OUTPUT_Z(out) VCC(in) GND(in)
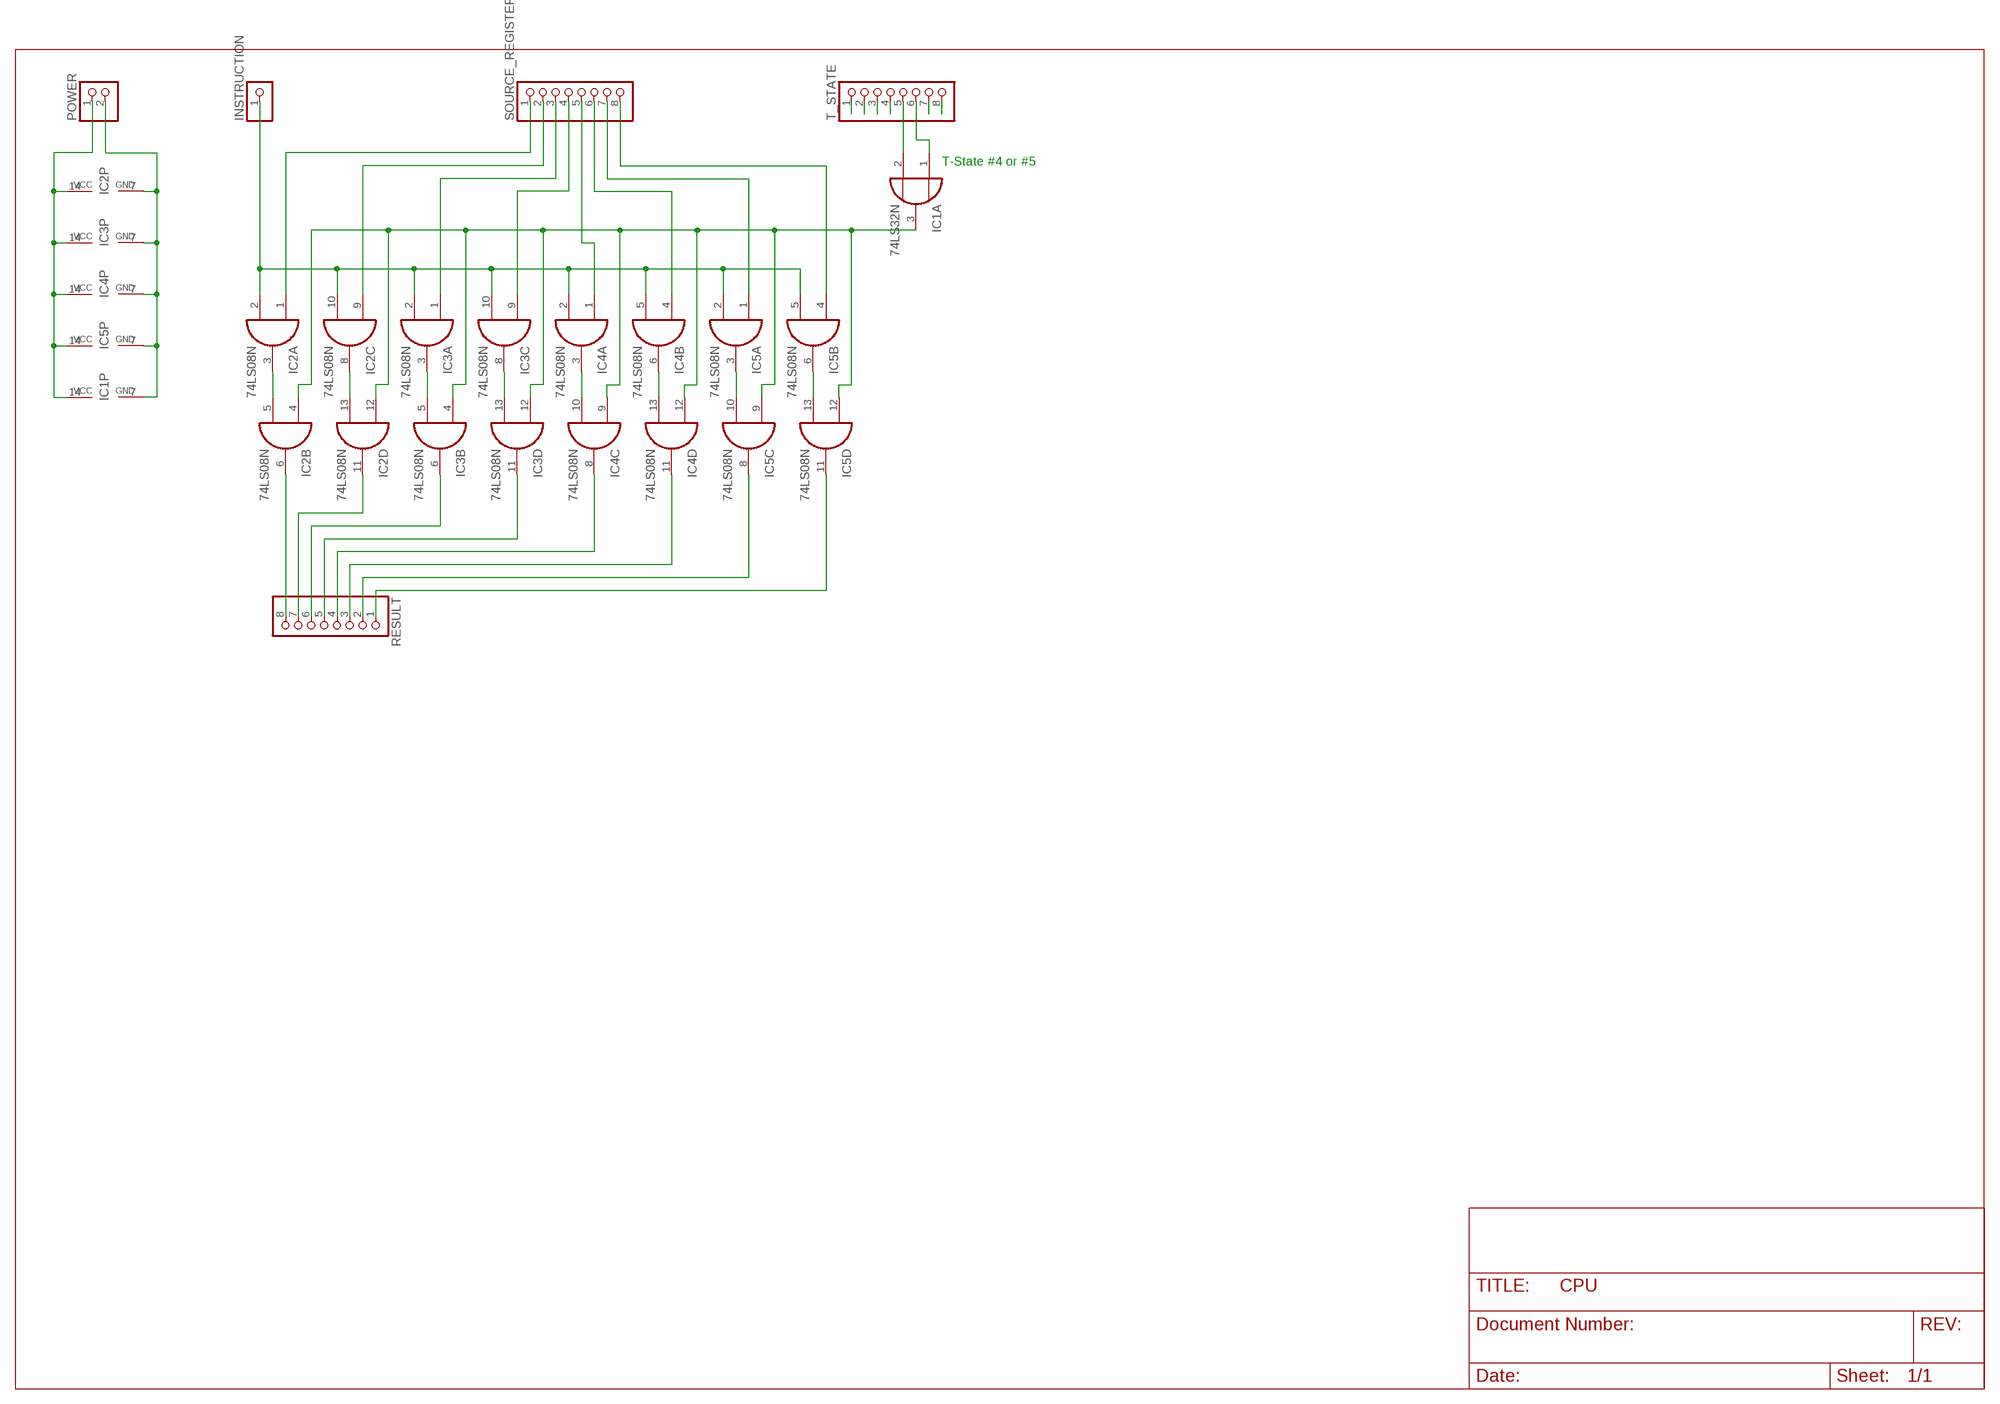
[diagram p56: schematic, module MOV16_SOURE_REGISTER, sheet 1]

### Parts
IC1  74LS32N  [DIL14]
IC2  74LS08N  [DIL14]
IC3  74LS08N  [DIL14]
IC4  74LS08N  [DIL14]
IC5  74LS08N  [DIL14]
INSTRUCTION  PINHD-1X1  [1X01]
POWER  PINHD-1X2  [1X02]
RESULT  PINHD-1X8  [1X08]
SOURCE_REGISTER  PINHD-1X8  [1X08]
T_STATE  PINHD-1X8  [1X08]

### Nets
GND: IC1.7(P:GND) IC2.7(P:GND) IC3.7(P:GND) IC4.7(P:GND) IC5.7(P:GND) POWER.2
MOV16_INSTRUCTION: IC2.2(A:I1) IC2.10(C:I1) IC3.2(A:I1) IC3.10(C:I1) IC4.2(A:I1) IC4.5(B:I1) IC5.2(A:I1) IC5.5(B:I1) INSTRUCTION.1
N$5: IC2.3(A:O) IC2.5(B:I1)
N$6: IC1.3(A:O) IC2.4(B:I0) IC2.12(D:I0) IC3.4(B:I0) IC3.12(D:I0) IC4.9(C:I0) IC4.12(D:I0) IC5.9(C:I0) IC5.12(D:I0)
N$9: IC2.8(C:O) IC2.13(D:I1)
N$12: IC3.3(A:O) IC3.5(B:I1)
N$15: IC3.8(C:O) IC3.13(D:I1)
N$18: IC4.3(A:O) IC4.10(C:I1)
N$22: IC4.6(B:O) IC4.13(D:I1)
N$26: IC5.3(A:O) IC5.10(C:I1)
N$29: IC5.6(B:O) IC5.13(D:I1)
SOURCE_REGISTER_INPUT_5: IC4.1(A:I0) SOURCE_REGISTER.5
SOURCE_REGISTER_INPUT_BP: IC4.4(B:I0) SOURCE_REGISTER.6
SOURCE_REGISTER_INPUT_J: IC3.1(A:I0) SOURCE_REGISTER.3
SOURCE_REGISTER_INPUT_M: IC2.1(A:I0) SOURCE_REGISTER.1
SOURCE_REGISTER_INPUT_SP: IC3.9(C:I0) SOURCE_REGISTER.4
SOURCE_REGISTER_INPUT_X: IC2.9(C:I0) SOURCE_REGISTER.2
SOURCE_REGISTER_INPUT_Y: IC5.1(A:I0) SOURCE_REGISTER.7
SOURCE_REGISTER_INPUT_Z: IC5.4(B:I0) SOURCE_REGISTER.8
SOURCE_REGISTER_OUTPUT_5: IC4.8(C:O) RESULT.4
SOURCE_REGISTER_OUTPUT_BP: IC4.11(D:O) RESULT.3
SOURCE_REGISTER_OUTPUT_J: IC3.6(B:O) RESULT.6
SOURCE_REGISTER_OUTPUT_M: IC2.6(B:O) RESULT.8
SOURCE_REGISTER_OUTPUT_SP: IC3.11(D:O) RESULT.5
SOURCE_REGISTER_OUTPUT_X: IC2.11(D:O) RESULT.7
SOURCE_REGISTER_OUTPUT_Y: IC5.8(C:O) RESULT.2
SOURCE_REGISTER_OUTPUT_Z: IC5.11(D:O) RESULT.1
T1: T_STATE.1
T2: T_STATE.2
T3: T_STATE.3
T4: T_STATE.4
T5: IC1.2(A:I1) T_STATE.5
T6: IC1.1(A:I0) T_STATE.6
T7: T_STATE.7
T8: T_STATE.8
VCC: IC1.14(P:VCC) IC2.14(P:VCC) IC3.14(P:VCC) IC4.14(P:VCC) IC5.14(P:VCC) POWER.1
Unconnected: IC1.4(B:I0) IC1.5(B:I1) IC1.6(B:O) IC1.8(C:O) IC1.9(C:I0) IC1.10(C:I1) IC1.11(D:O) IC1.12(D:I0) IC1.13(D:I1)

### Notes on the sheet
- T-State #4 or #5

### Library data of the parts
IC1 = 74xx-eu:74*32: Quad 2-input OR gate
IC2-IC5 = 74xx-eu:74*08: Quad 2-input AND gate
INSTRUCTION = pinhead:PINHD-1X1: PIN HEADER
POWER = pinhead:PINHD-1X2: PIN HEADER
RESULT SOURCE_REGISTER T_STATE = pinhead:PINHD-1X8: PIN HEADER

## Module MOV16_DESTINATION_REGISTER
Ports: T1(in) T2(in) T3(in) T4(in) T5(in) T6(in) T7(in) T8(in) DESTINATION_REGISTER_INPUT_M(in) DESTINATION_REGISTER_INPUT_X(in) DESTINATION_REGISTER_INPUT_J(in) DESTINATION_REGISTER_INPUT_SP(in) DESTINATION_REGISTER_INPUT_5(in) DESTINATION_REGISTER_INPUT_BP(in) DESTINATION_REGISTER_INPUT_Y(in) DESTINATION_REGISTER_INPUT_Z(in) MOV16_INSTRUCTION(in) DESTINATION_REGISTER_OUTPUT_M(out) DESTINATION_REGISTER_OUTPUT_X(out) DESTINATION_REGISTER_OUTPUT_J(out) DESTINATION_REGISTER_OUTPUT_SP(out) DESTINATION_REGISTER_OUTPUT_5(out) DESTINATION_REGISTER_OUTPUT_BP(out) DESTINATION_REGISTER_OUTPUT_Y(out) DESTINATION_REGISTER_OUTPUT_Z(out) VCC(in) GND(in)
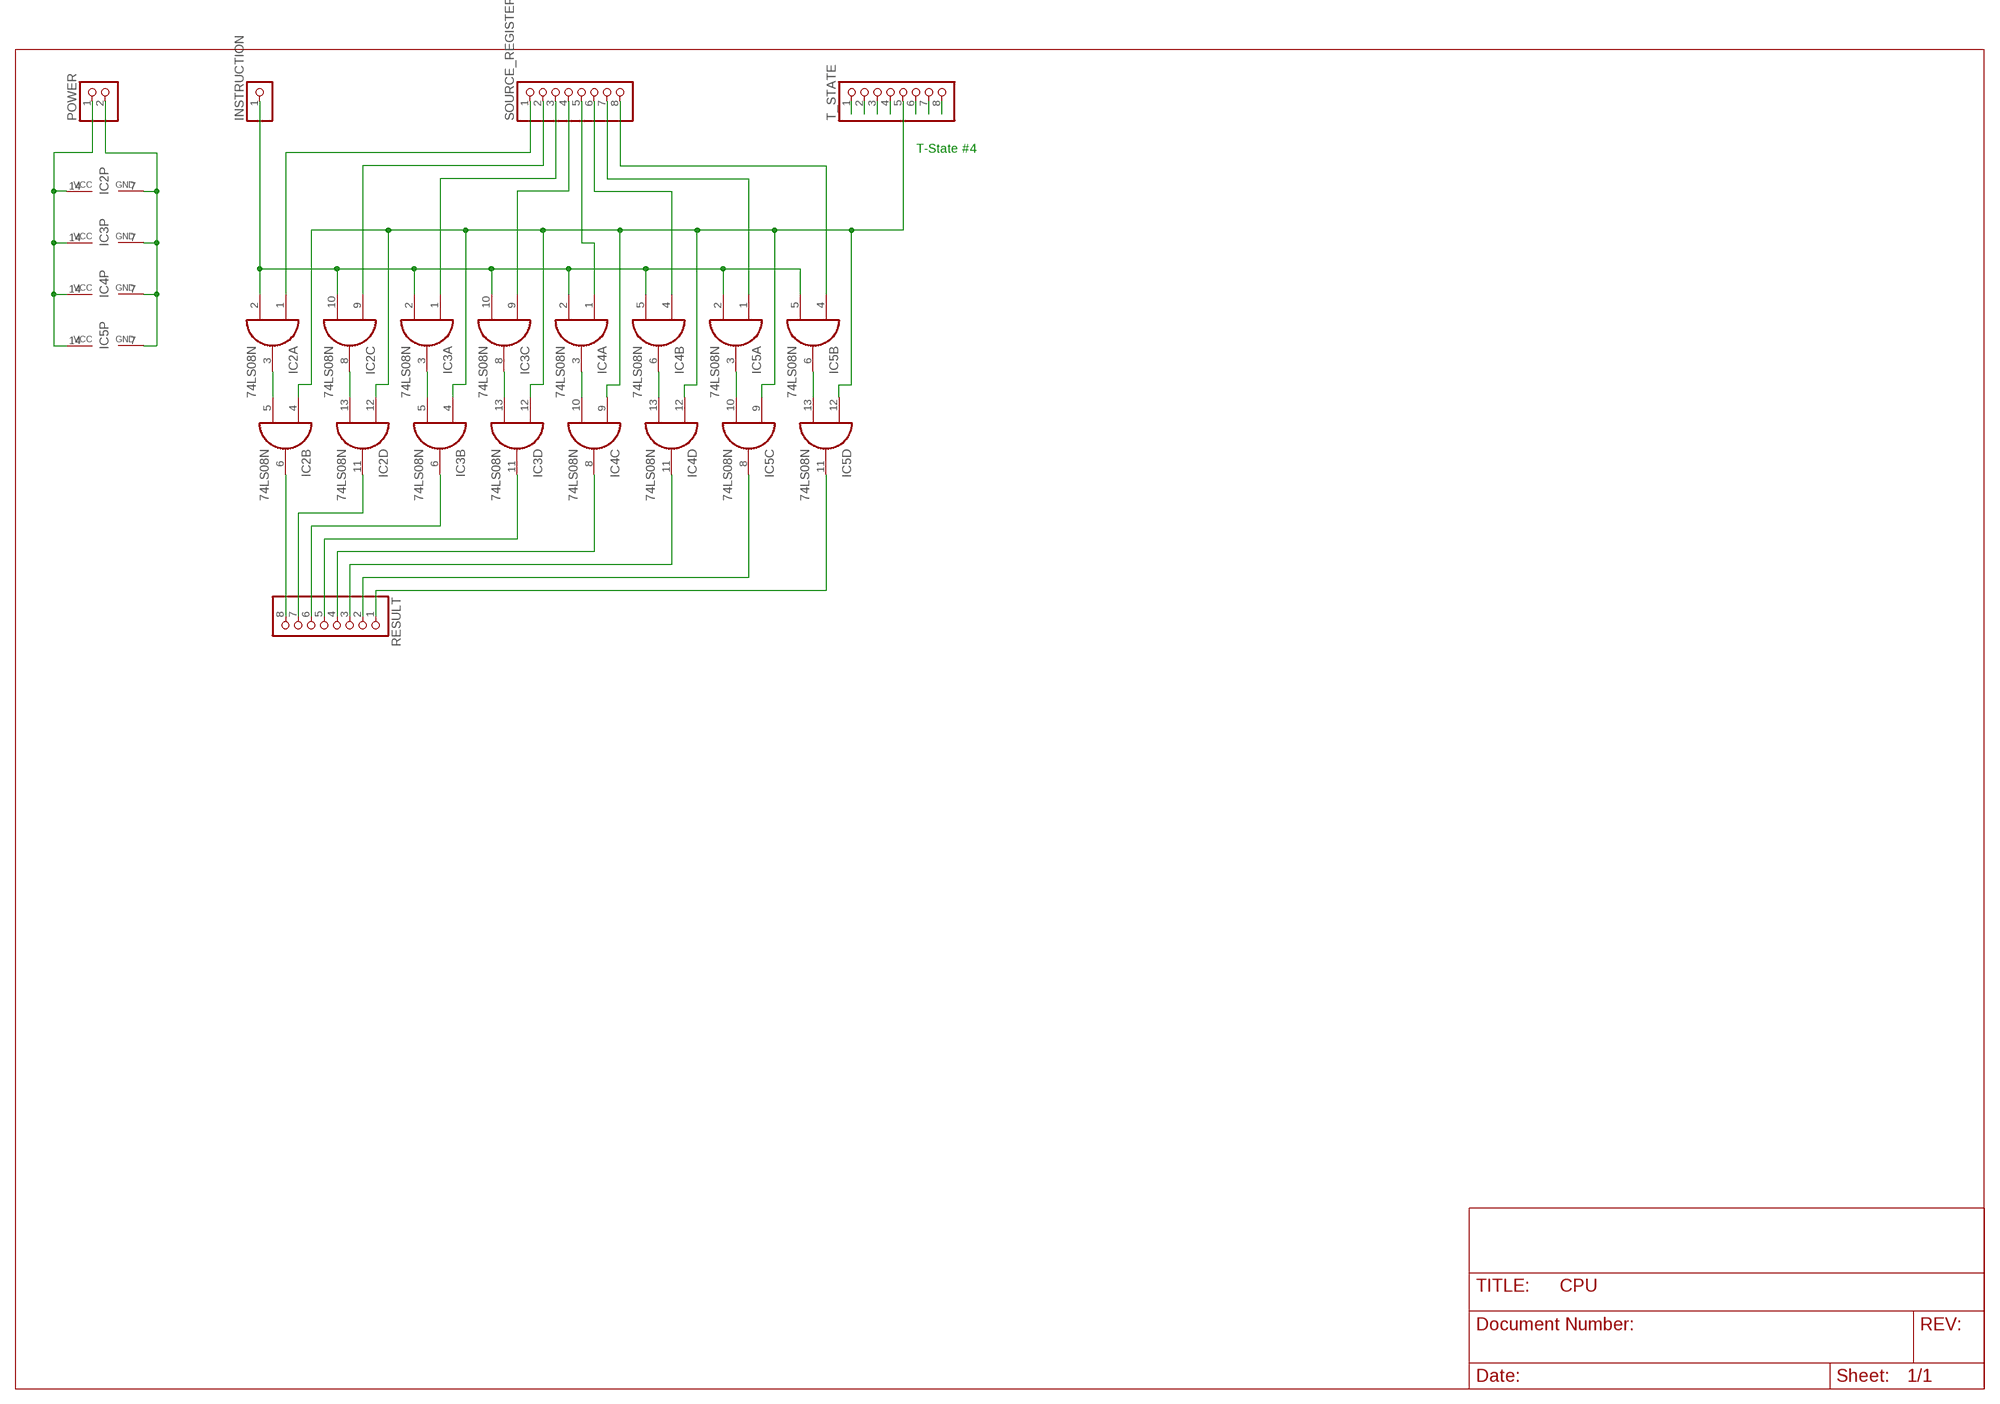
[diagram p57: schematic, module MOV16_DESTINATION_REGISTER, sheet 1]

### Parts
IC2  74LS08N  [DIL14]
IC3  74LS08N  [DIL14]
IC4  74LS08N  [DIL14]
IC5  74LS08N  [DIL14]
INSTRUCTION  PINHD-1X1  [1X01]
POWER  PINHD-1X2  [1X02]
RESULT  PINHD-1X8  [1X08]
SOURCE_REGISTER  PINHD-1X8  [1X08]
T_STATE  PINHD-1X8  [1X08]

### Nets
DESTINATION_REGISTER_INPUT_5: IC4.1(A:I0) SOURCE_REGISTER.5
DESTINATION_REGISTER_INPUT_BP: IC4.4(B:I0) SOURCE_REGISTER.6
DESTINATION_REGISTER_INPUT_J: IC3.1(A:I0) SOURCE_REGISTER.3
DESTINATION_REGISTER_INPUT_M: IC2.1(A:I0) SOURCE_REGISTER.1
DESTINATION_REGISTER_INPUT_SP: IC3.9(C:I0) SOURCE_REGISTER.4
DESTINATION_REGISTER_INPUT_X: IC2.9(C:I0) SOURCE_REGISTER.2
DESTINATION_REGISTER_INPUT_Y: IC5.1(A:I0) SOURCE_REGISTER.7
DESTINATION_REGISTER_INPUT_Z: IC5.4(B:I0) SOURCE_REGISTER.8
DESTINATION_REGISTER_OUTPUT_5: IC4.8(C:O) RESULT.4
DESTINATION_REGISTER_OUTPUT_BP: IC4.11(D:O) RESULT.3
DESTINATION_REGISTER_OUTPUT_J: IC3.6(B:O) RESULT.6
DESTINATION_REGISTER_OUTPUT_M: IC2.6(B:O) RESULT.8
DESTINATION_REGISTER_OUTPUT_SP: IC3.11(D:O) RESULT.5
DESTINATION_REGISTER_OUTPUT_X: IC2.11(D:O) RESULT.7
DESTINATION_REGISTER_OUTPUT_Y: IC5.8(C:O) RESULT.2
DESTINATION_REGISTER_OUTPUT_Z: IC5.11(D:O) RESULT.1
GND: IC2.7(P:GND) IC3.7(P:GND) IC4.7(P:GND) IC5.7(P:GND) POWER.2
MOV16_INSTRUCTION: IC2.2(A:I1) IC2.10(C:I1) IC3.2(A:I1) IC3.10(C:I1) IC4.2(A:I1) IC4.5(B:I1) IC5.2(A:I1) IC5.5(B:I1) INSTRUCTION.1
N$5: IC2.3(A:O) IC2.5(B:I1)
N$9: IC2.8(C:O) IC2.13(D:I1)
N$12: IC3.3(A:O) IC3.5(B:I1)
N$15: IC3.8(C:O) IC3.13(D:I1)
N$18: IC4.3(A:O) IC4.10(C:I1)
N$22: IC4.6(B:O) IC4.13(D:I1)
N$26: IC5.3(A:O) IC5.10(C:I1)
N$29: IC5.6(B:O) IC5.13(D:I1)
T1: T_STATE.1
T2: T_STATE.2
T3: T_STATE.3
T4: T_STATE.4
T5: IC2.4(B:I0) IC2.12(D:I0) IC3.4(B:I0) IC3.12(D:I0) IC4.9(C:I0) IC4.12(D:I0) IC5.9(C:I0) IC5.12(D:I0) T_STATE.5
T6: T_STATE.6
T7: T_STATE.7
T8: T_STATE.8
VCC: IC2.14(P:VCC) IC3.14(P:VCC) IC4.14(P:VCC) IC5.14(P:VCC) POWER.1

### Notes on the sheet
- T-State #4

### Library data of the parts
IC2-IC5 = 74xx-eu:74*08: Quad 2-input AND gate
INSTRUCTION = pinhead:PINHD-1X1: PIN HEADER
POWER = pinhead:PINHD-1X2: PIN HEADER
RESULT SOURCE_REGISTER T_STATE = pinhead:PINHD-1X8: PIN HEADER